# Altium project ATLAS_XP2V5.PrjPcb (part 1 of 2)
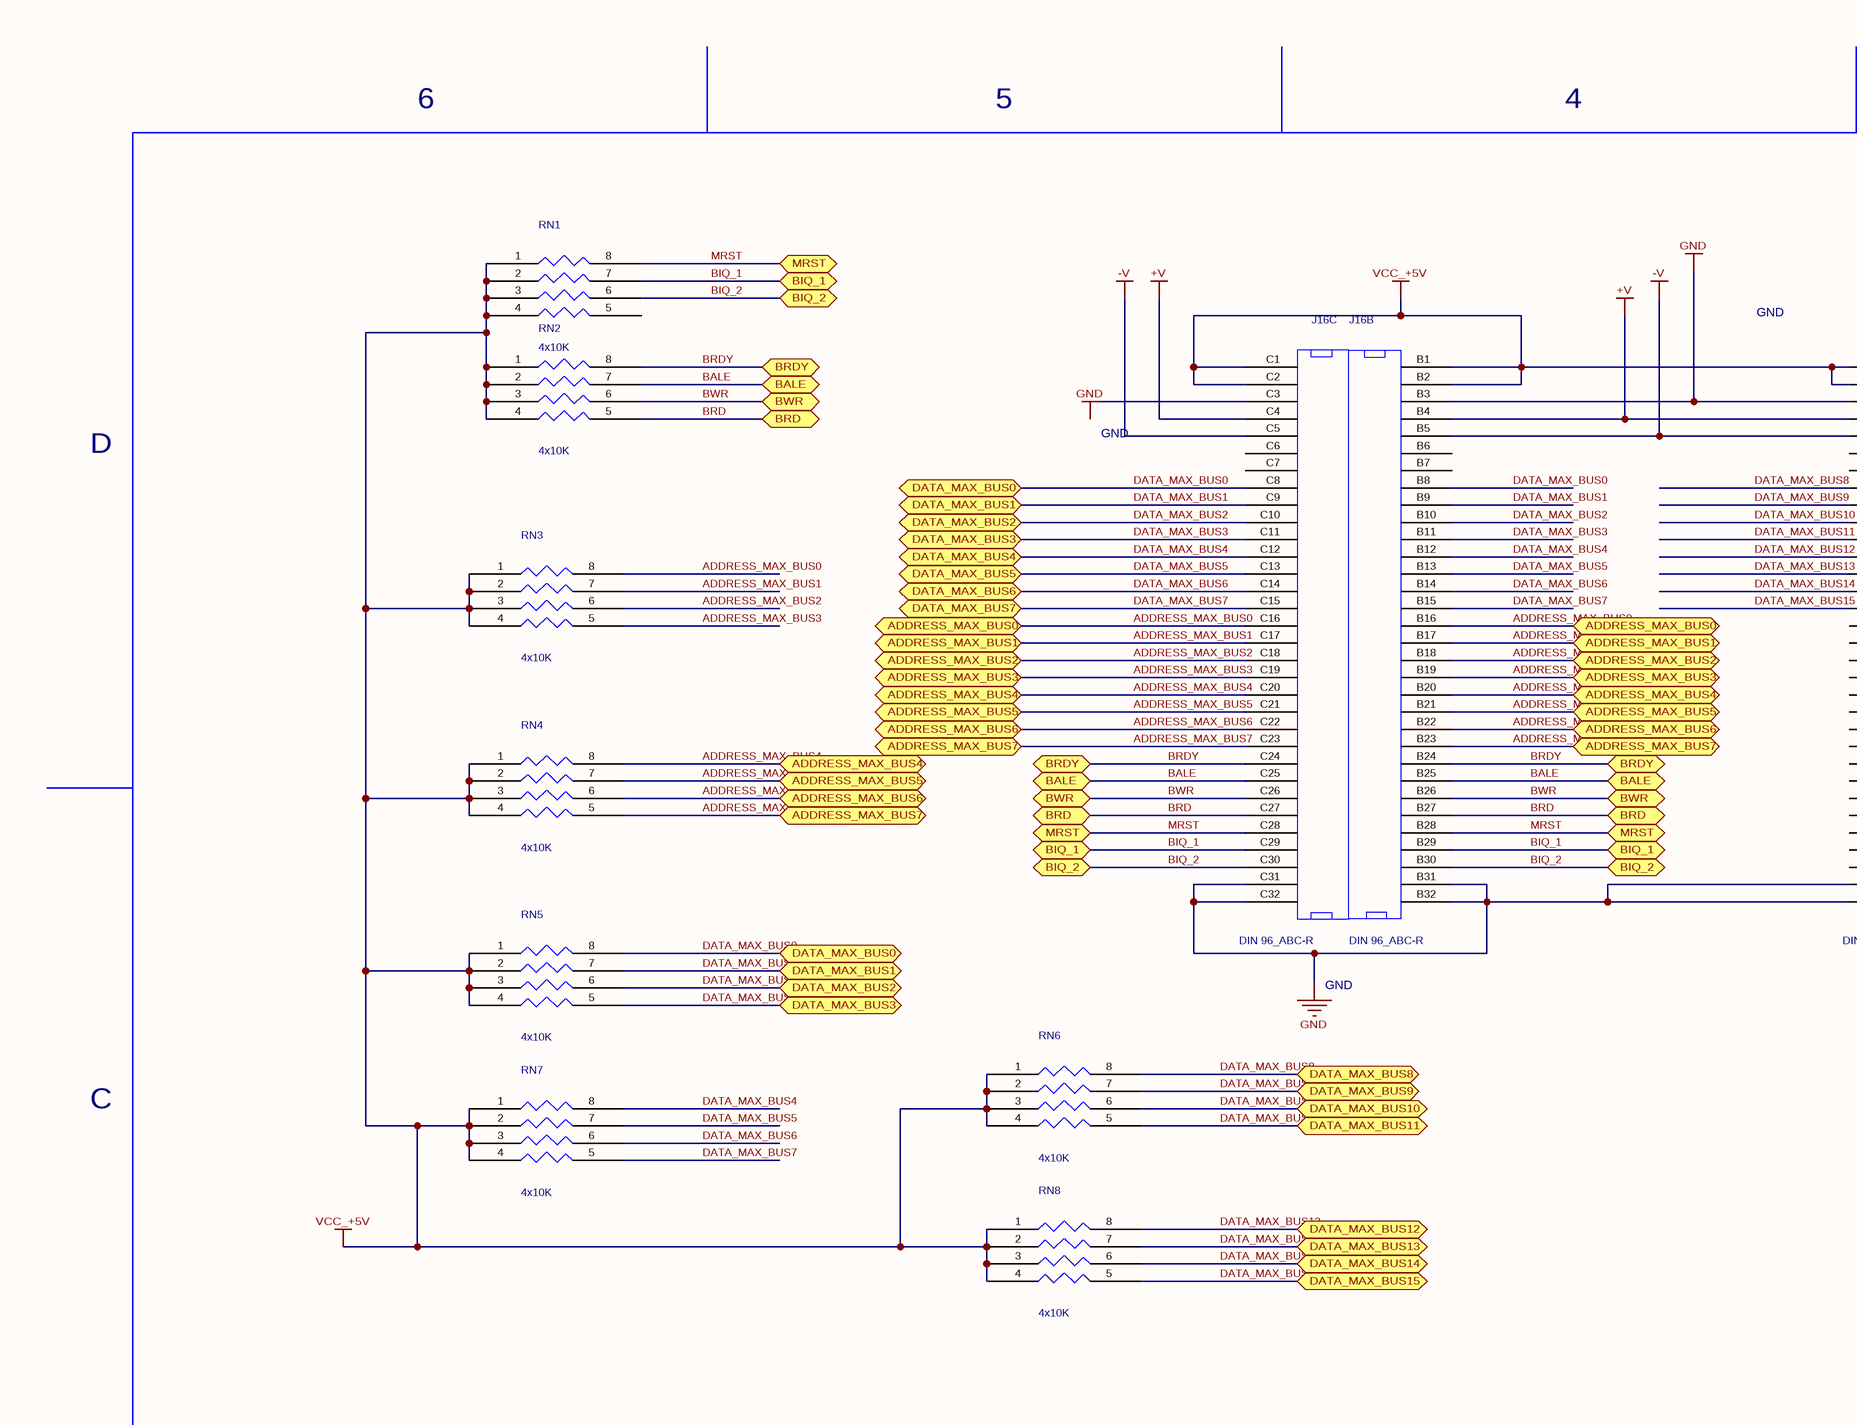
[diagram p0: MAX_BUS.SchDoc, top left]
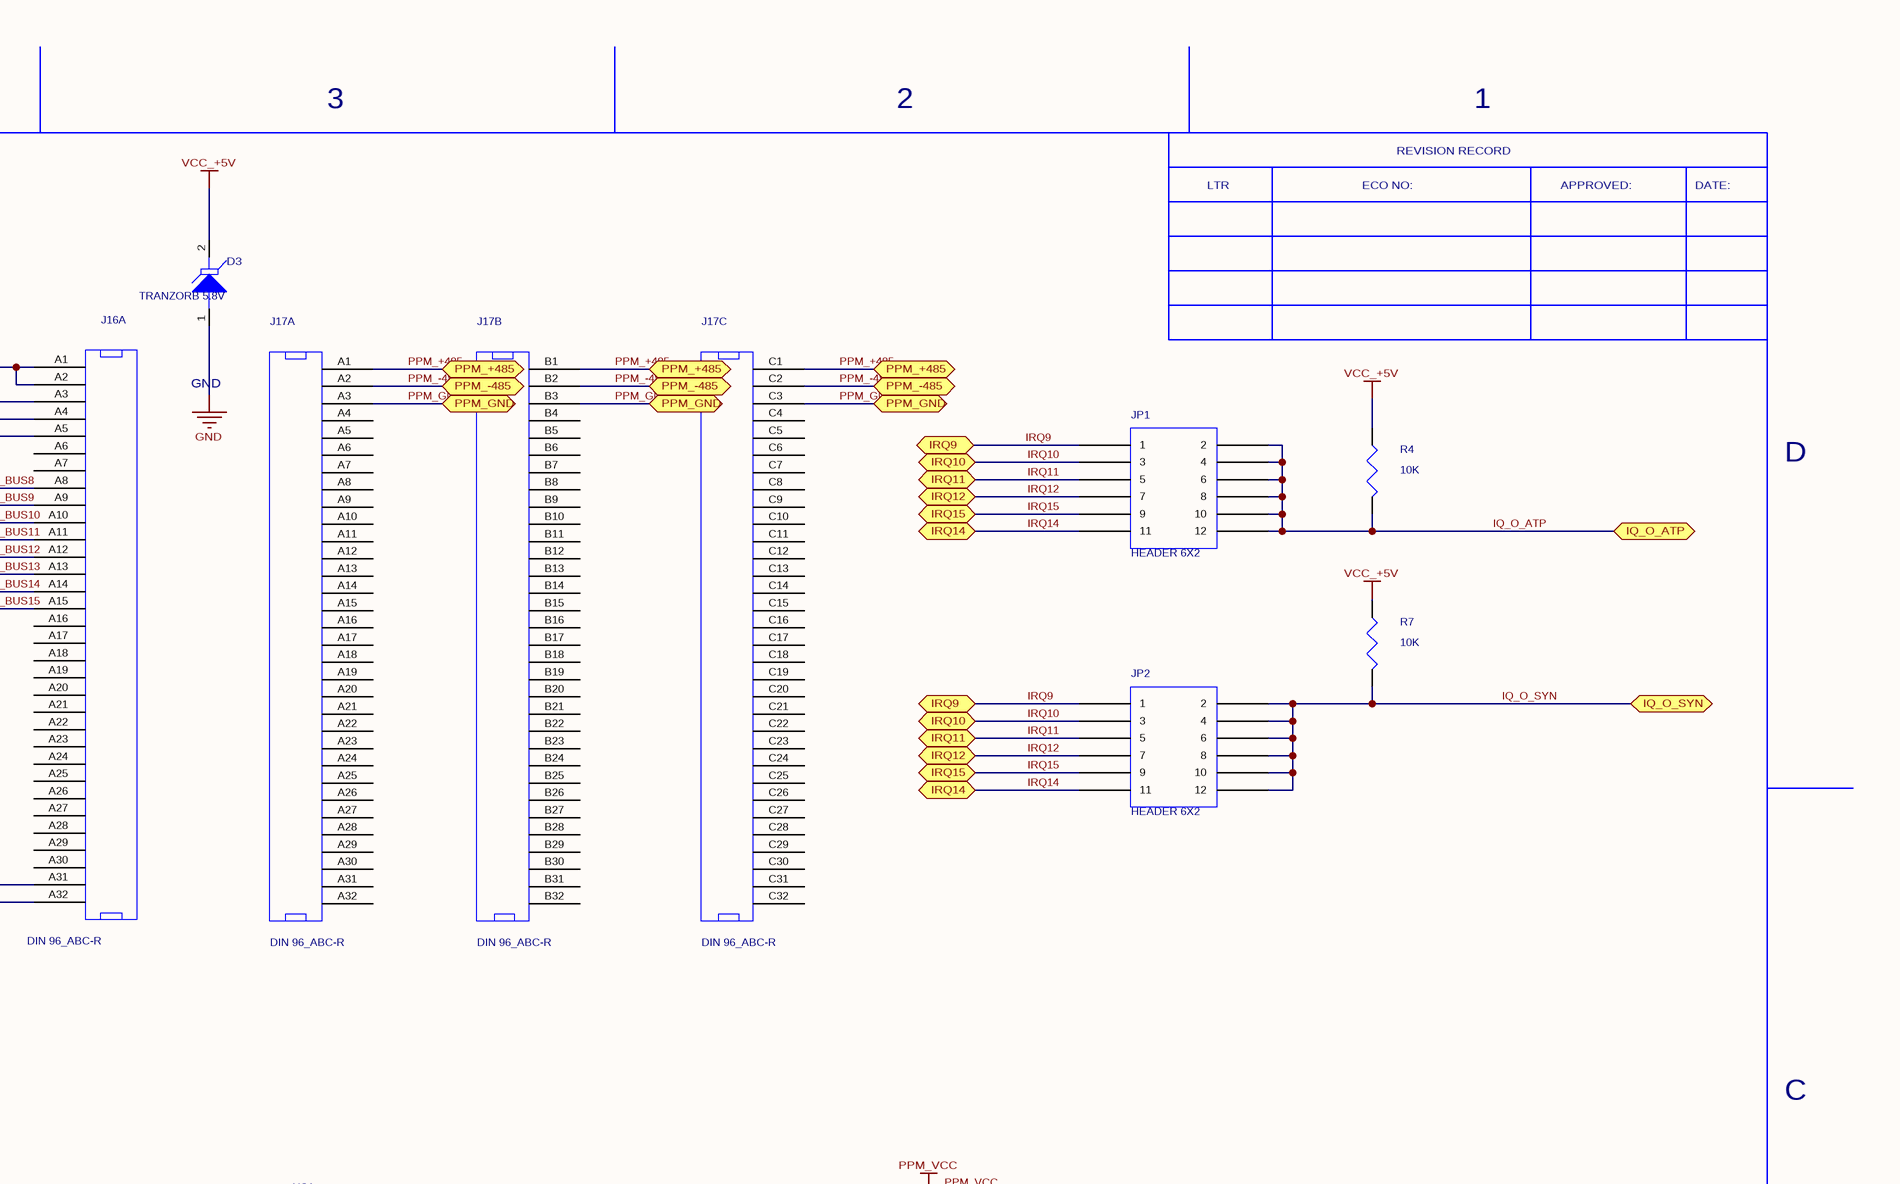
[diagram p1: MAX_BUS.SchDoc, top right]
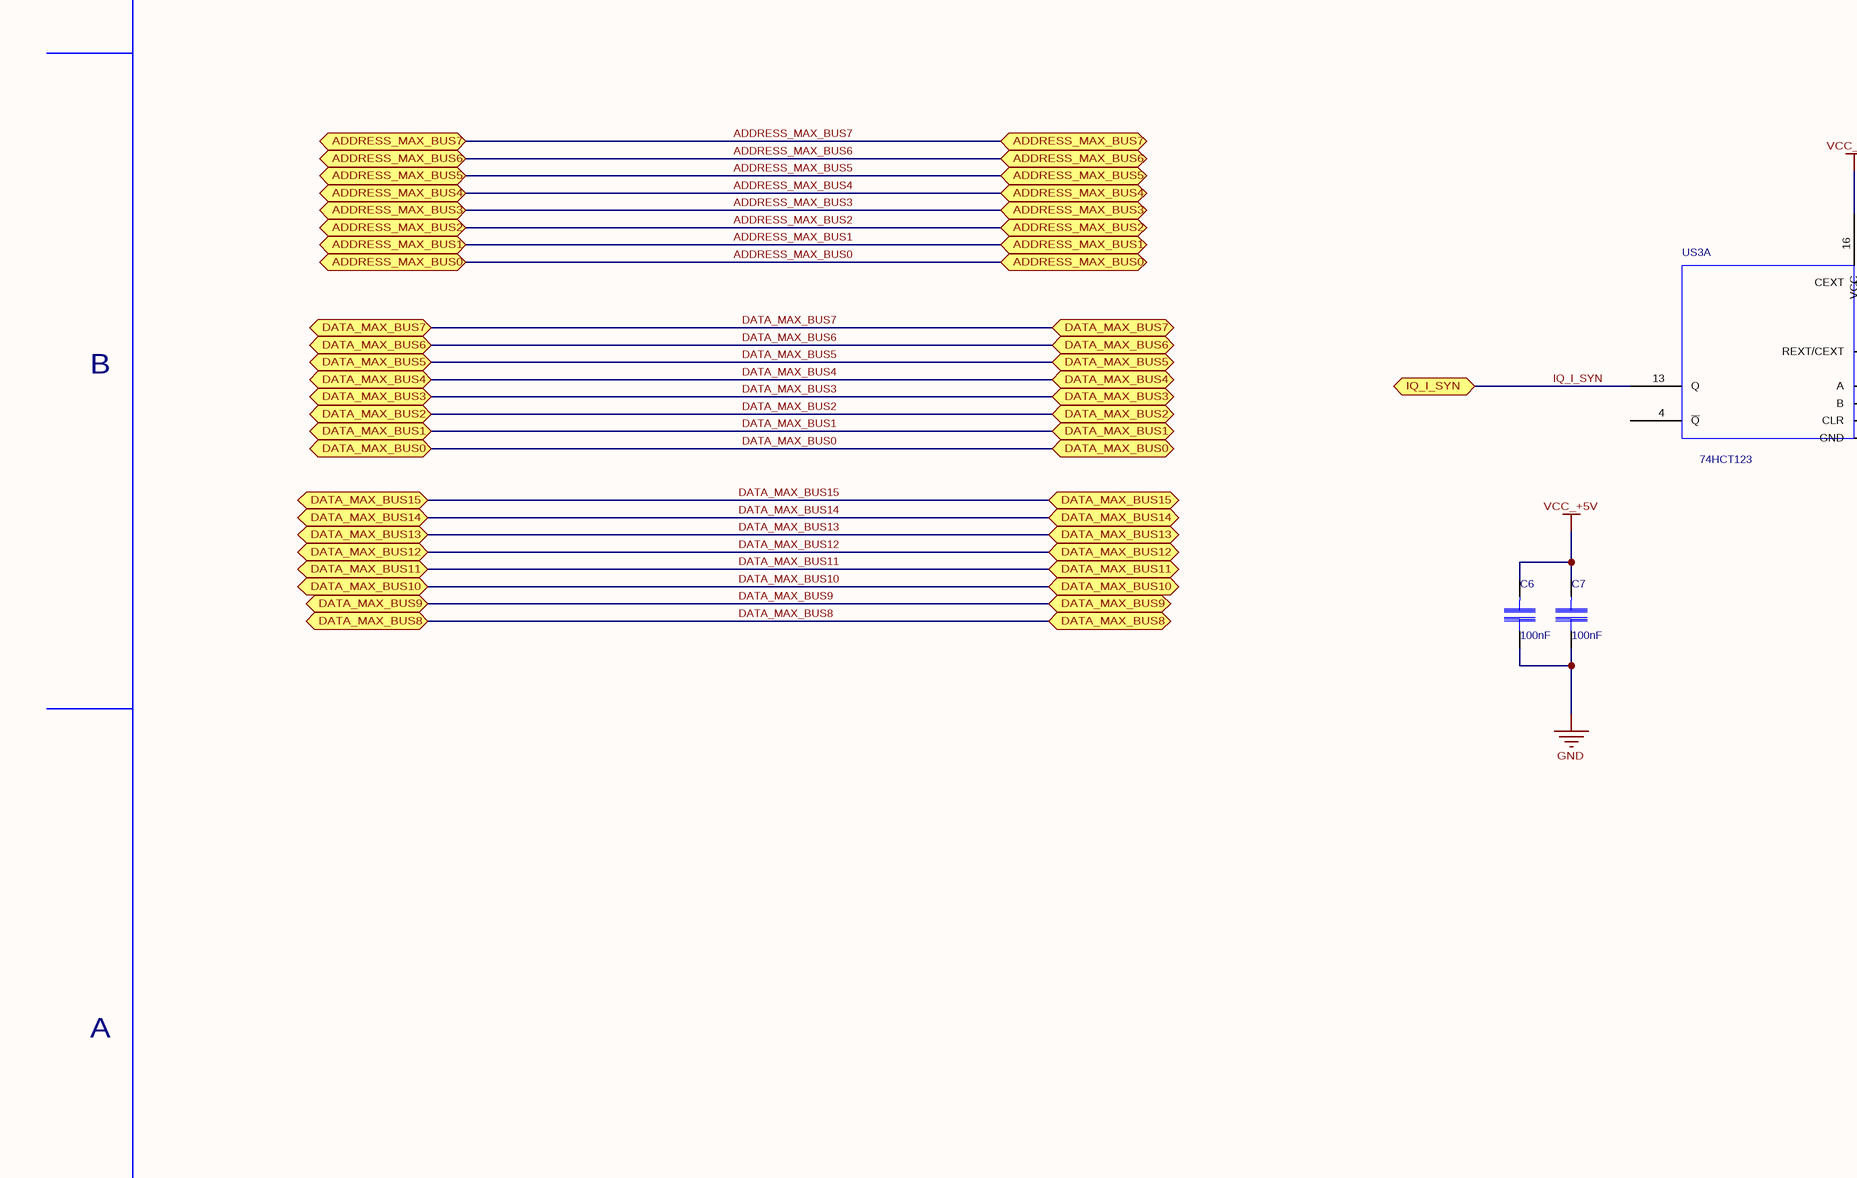
[diagram p2: MAX_BUS.SchDoc, bottom left]
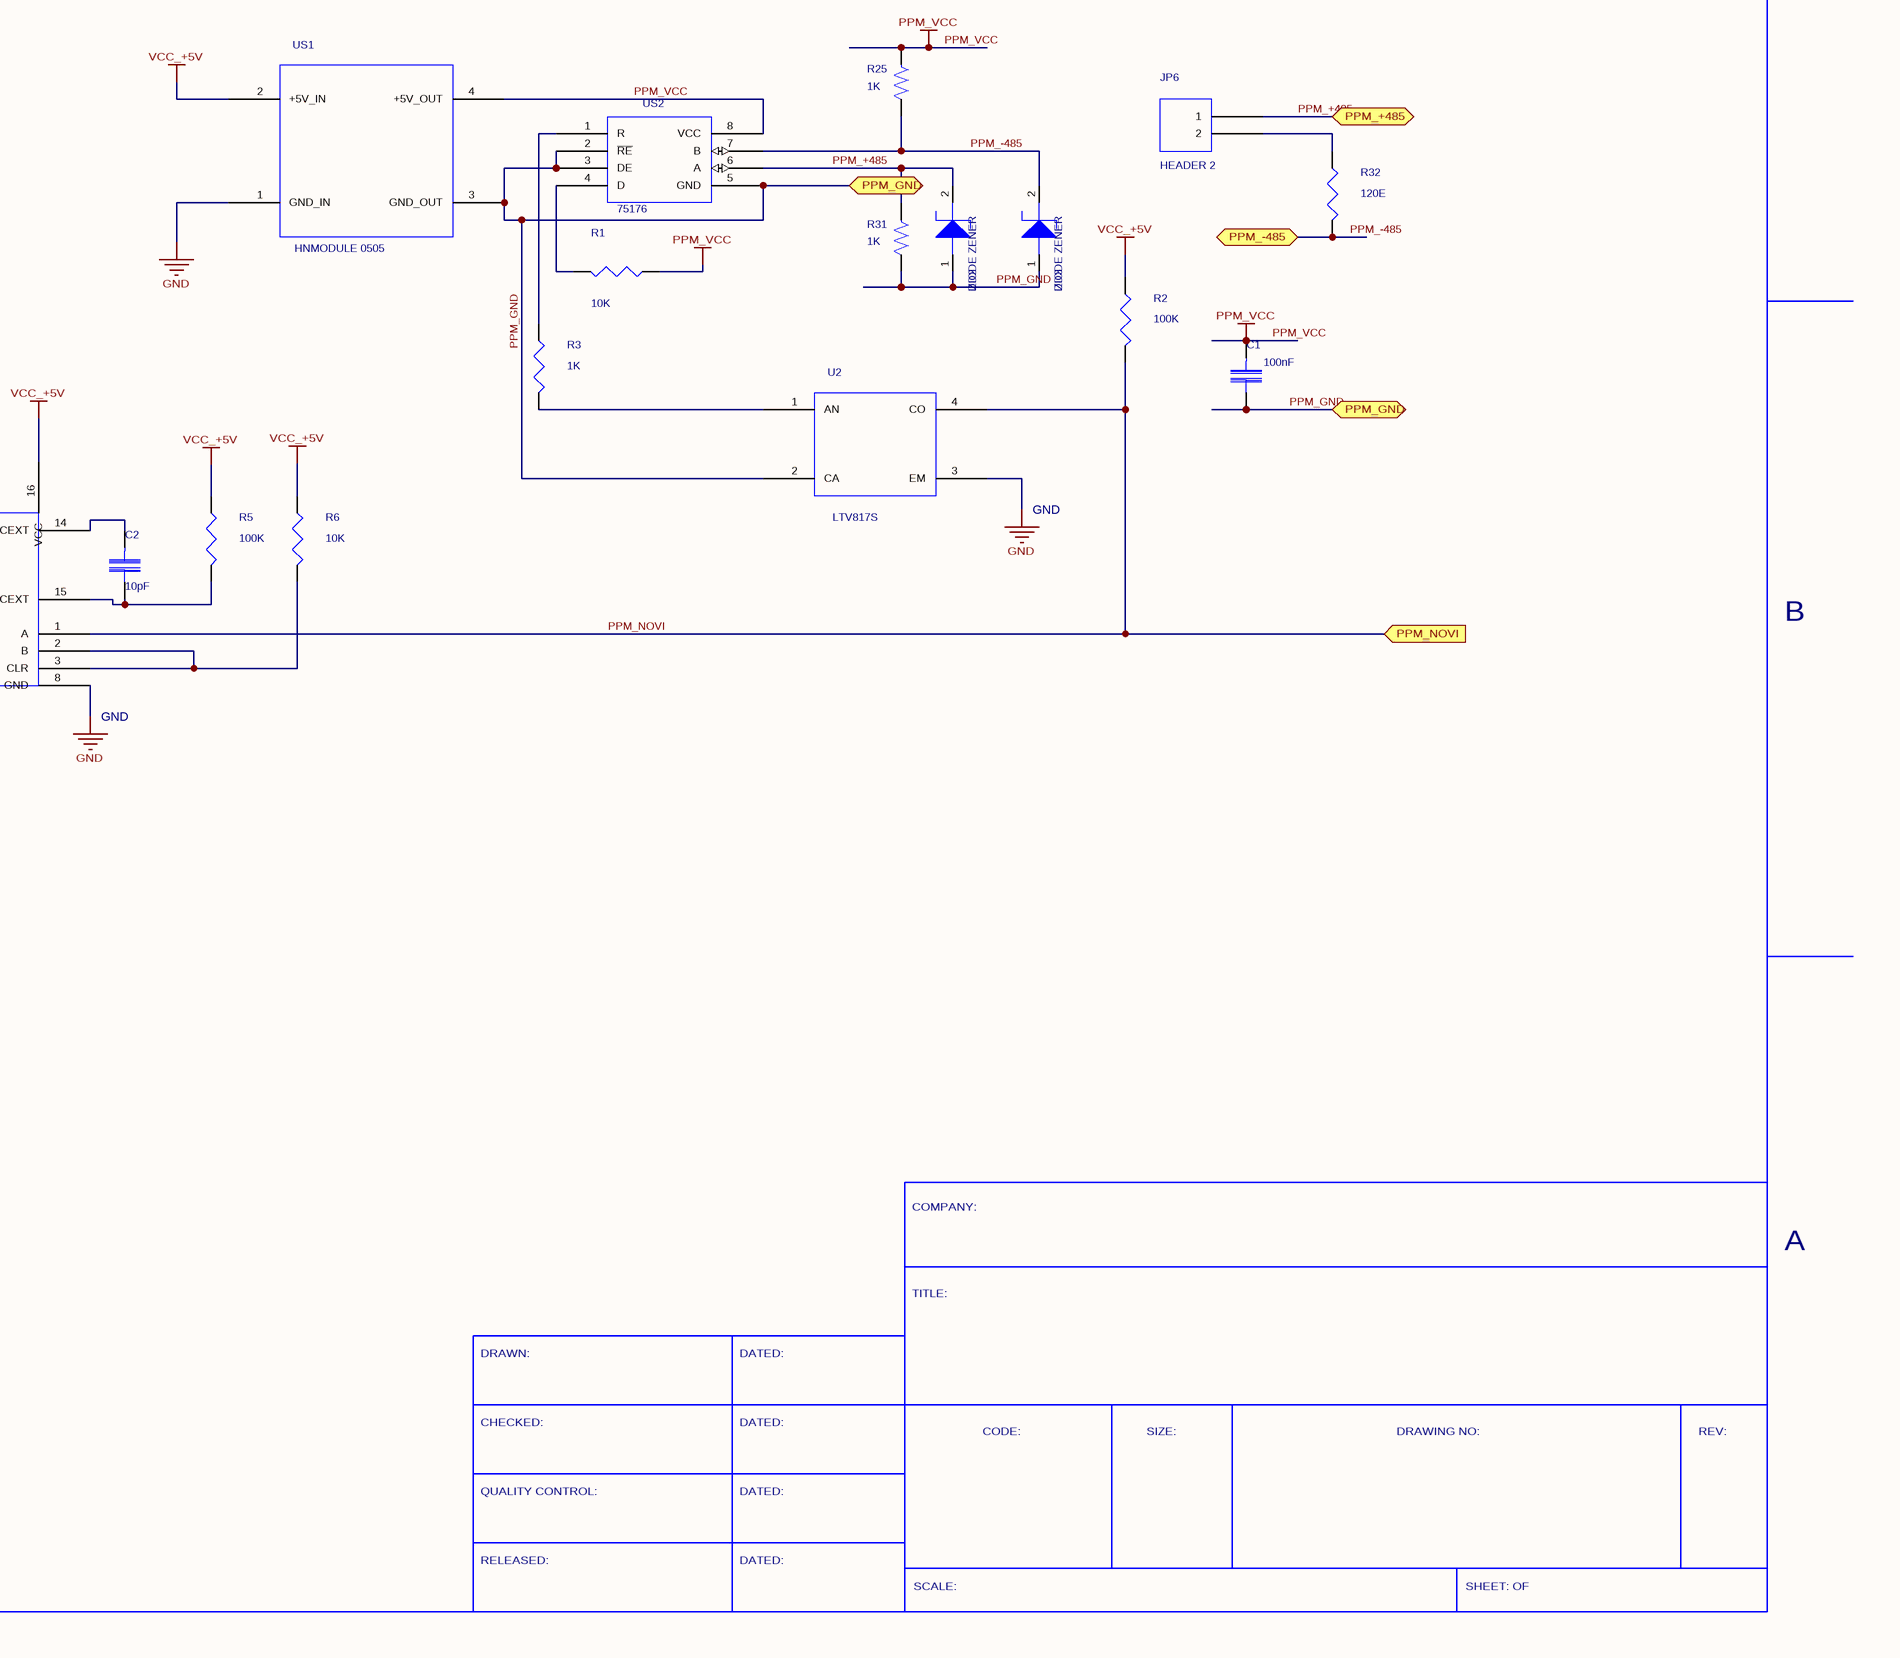
[diagram p3: MAX_BUS.SchDoc, bottom right]
6 sheets, 150 parts. Net scope: flat (ports and power ports of the same name join across sheets).
Board file: ATLAS_XP2V5_sredjen_bom.PcbDoc
Sheets:
  MAX_BUS.SchDoc
  POWER_SUPPLY.SchDoc
  ISA_XILINX.SchDoc
  WDT_TASTERI_M_S.SchDoc
  ATLAS_XP2V5.Sheet 5.SchDoc
  PROBA.SchDoc

## Sheet MAX_BUS.SchDoc: ATLAS_XP2V5
size 558 x 431 mm; Organization: IMP Automatika d.o.o.; Revision: V5

### Parts
C1  value 100nF  [SM/C_0805]  (hidden comment: C)
C2  value 10pF  [SM/C_0805]  (hidden comment: C)
C6  value 100nF  [SM/C_0805]  (hidden comment: C)
C7  value 100nF  [SM/C_0805]  (hidden comment: C)
D3  value TRANZORB 5.8V  [SM/DO214AC_21]  (hidden comment: TRANZORB_0)
J16  value DIN 96_ABC-R  [DIN96_ABC/R]  (hidden comment: DIN_96_ABC-R)  (parts A,B,C of 3)
J17  value DIN 96_ABC-R  [DIN96_ABC/R]  (hidden comment: DIN_96_ABC-R)  (parts A,B,C of 3)
JP1  value HEADER 6X2  [BLKCON.100/VH/TM2OE/W.200/12]  (hidden comment: HEADER_6X2)
JP2  value HEADER 6X2  [BLKCON.100/VH/TM2OE/W.200/12]  (hidden comment: HEADER_6X2)
JP6  value HEADER 2  [JUMPER_100]  (hidden comment: HEADER_2)
R1  value 10K  [SM/R_1206]  (hidden comment: RESISTOR_2)
R2  value 100K  [SM/R_1206]  (hidden comment: RESISTOR_2)
R3  value 1K  [SM/R_1206]  (hidden comment: RESISTOR_2)
R4  value 10K  [SM/R_1206]  (hidden comment: RESISTOR_2)
R5  value 100K  [SM/R_1206]  (hidden comment: RESISTOR_2)
R6  value 10K  [SM/R_1206]  (hidden comment: RESISTOR_2)
R7  value 10K  [SM/R_1206]  (hidden comment: RESISTOR_2)
R25  value 1K  [SM/R_1206]  (hidden comment: R)
R31  value 1K  [SM/R_1206]  (hidden comment: R)
R32  value 120E  [SM/R_1206]  (hidden comment: RESISTOR_2)
RN1  value 4x10K  [SMD_RX4]  (hidden comment: RESAR_IS_4/SM)
RN2  value 4x10K  [SMD_RX4]  (hidden comment: RESAR_IS_4/SM)
RN3  value 4x10K  [SMD_RX4]  (hidden comment: RESAR_IS_4/SM)
RN4  value 4x10K  [SMD_RX4]  (hidden comment: RESAR_IS_4/SM)
RN5  value 4x10K  [SMD_RX4]  (hidden comment: RESAR_IS_4/SM)
RN6  value 4x10K  [SMD_RX4]  (hidden comment: RESAR_IS_4/SM)
RN7  value 4x10K  [SMD_RX4]  (hidden comment: RESAR_IS_4/SM)
RN8  value 4x10K  [SMD_RX4]  (hidden comment: RESAR_IS_4/SM)
U2  value LTV817S  [LTV814S]  (hidden comment: LTV-817_0)
US1  value HNMODULE 0505  [DCDC55]  (hidden comment: HNMODUL0505)
US2  75176  [SOG.050/8/WG.244/L.225]
US3  value 74HCT123  [SOG.050/16/WG.244/L.375]  (hidden comment: 74HC123_0)  (part A of 2)
ZD2  value DIODE ZENER  [SM/D_1206_21]  (hidden comment: DIODE_ZENER_0)
ZD3  value DIODE ZENER  [SM/D_1206_21]  (hidden comment: DIODE_ZENER_0)

### Ports
ADDRESS_MAX_BUS0 (bidir), ADDRESS_MAX_BUS1 (bidir), ADDRESS_MAX_BUS2 (bidir), ADDRESS_MAX_BUS3 (bidir), ADDRESS_MAX_BUS4 (bidir), ADDRESS_MAX_BUS5 (bidir), ADDRESS_MAX_BUS6 (bidir), ADDRESS_MAX_BUS7 (bidir), BALE (bidir), BIQ_1 (bidir), BIQ_2 (bidir), BRD (bidir), BRDY (bidir), BWR (bidir), DATA_MAX_BUS0 (bidir), DATA_MAX_BUS1 (bidir), DATA_MAX_BUS2 (bidir), DATA_MAX_BUS3 (bidir), DATA_MAX_BUS4 (bidir), DATA_MAX_BUS5 (bidir), DATA_MAX_BUS6 (bidir), DATA_MAX_BUS7 (bidir), DATA_MAX_BUS8 (bidir), DATA_MAX_BUS9 (bidir), DATA_MAX_BUS10 (bidir), DATA_MAX_BUS11 (bidir), DATA_MAX_BUS12 (bidir), DATA_MAX_BUS13 (bidir), DATA_MAX_BUS14 (bidir), DATA_MAX_BUS15 (bidir), IQ_I_SYN (bidir), IQ_O_ATP (bidir), IQ_O_SYN (bidir), IRQ9 (bidir), IRQ10 (bidir), IRQ11 (bidir), IRQ12 (bidir), IRQ14 (bidir), IRQ15 (bidir), MRST (bidir), PPM_+485 (bidir), PPM_-485 (bidir), PPM_GND (bidir), PPM_NOVI

### Nets
+V: J16.A4 J16.B4 J16.C4
-V: J16.A5 J16.B5 J16.C5
GND: C6.2 C7.2 D3.1(ANODE) J16.A3 J16.A31 J16.A32 J16.B3 J16.B31 J16.B32 J16.C3 J16.C31 J16.C32 U2.3(EM) US1.1(GND_IN) US3.8(GND)
PPM_VCC: C1.1 R1.1 R25.1 US1.4(+5V_OUT) US2.8(VCC)
VCC_+5V: C6.1 C7.1 D3.2(CATHODE) J16.A1 J16.A2 J16.B1 J16.B2 J16.C1 J16.C2 R2.1 R4.1 R5.1 R6.1 R7.1 RN1.1 RN1.2 RN1.3 RN1.4 RN2.1 RN2.2 RN2.3 RN2.4 RN3.1 RN3.2 RN3.3 RN3.4 RN4.1 RN4.2 RN4.3 RN4.4 RN5.1 RN5.2 RN5.3 RN5.4 RN6.1 RN6.2 RN6.3 RN6.4 RN7.1 RN7.2 RN7.3 RN7.4 RN8.1 RN8.2 RN8.3 RN8.4 US1.2(+5V_IN) US3.16(VCC)
ADDRESS_MAX_BUS0: J16.B16 J16.C16 RN3.8 ; port ADDRESS_MAX_BUS0  [project net ADDRESS_MAX0]
ADDRESS_MAX_BUS1: J16.B17 J16.C17 RN3.7 ; port ADDRESS_MAX_BUS1  [project net ADDRESS_MAX1]
ADDRESS_MAX_BUS2: J16.B18 J16.C18 RN3.6 ; port ADDRESS_MAX_BUS2  [project net ADDRESS_MAX2]
ADDRESS_MAX_BUS3: J16.B19 J16.C19 RN3.5 ; port ADDRESS_MAX_BUS3  [project net ADDRESS_MAX3]
ADDRESS_MAX_BUS4: J16.B20 J16.C20 RN4.8 ; port ADDRESS_MAX_BUS4  [project net ADDRESS_MAX4]
ADDRESS_MAX_BUS5: J16.B21 J16.C21 RN4.7 ; port ADDRESS_MAX_BUS5  [project net ADDRESS_MAX5]
ADDRESS_MAX_BUS6: J16.B22 J16.C22 RN4.6 ; port ADDRESS_MAX_BUS6  [project net ADDRESS_MAX6]
ADDRESS_MAX_BUS7: J16.B23 J16.C23 RN4.5 ; port ADDRESS_MAX_BUS7  [project net ADDRESS_MAX7]
BALE: J16.B25 J16.C25 RN2.7 ; port BALE
BIQ_1: J16.B29 J16.C29 RN1.7 ; port BIQ_1
BIQ_2: J16.B30 J16.C30 RN1.6 ; port BIQ_2
BRD: J16.B27 J16.C27 RN2.5 ; port BRD
BRDY: J16.B24 J16.C24 RN2.8 ; port BRDY
BWR: J16.B26 J16.C26 RN2.6 ; port BWR
DATA_MAX_BUS0: J16.B8 J16.C8 RN5.8 ; port DATA_MAX_BUS0  [project net DATA_MAX0]
DATA_MAX_BUS1: J16.B9 J16.C9 RN5.7 ; port DATA_MAX_BUS1  [project net DATA_MAX1]
DATA_MAX_BUS2: J16.B10 J16.C10 RN5.6 ; port DATA_MAX_BUS2  [project net DATA_MAX2]
DATA_MAX_BUS3: J16.B11 J16.C11 RN5.5 ; port DATA_MAX_BUS3  [project net DATA_MAX3]
DATA_MAX_BUS4: J16.B12 J16.C12 RN7.8 ; port DATA_MAX_BUS4  [project net DATA_MAX4]
DATA_MAX_BUS5: J16.B13 J16.C13 RN7.7 ; port DATA_MAX_BUS5  [project net DATA_MAX5]
DATA_MAX_BUS6: J16.B14 J16.C14 RN7.6 ; port DATA_MAX_BUS6  [project net DATA_MAX6]
DATA_MAX_BUS7: J16.B15 J16.C15 RN7.5 ; port DATA_MAX_BUS7  [project net DATA_MAX7]
DATA_MAX_BUS8: J16.A8 RN6.8 ; port DATA_MAX_BUS8  [project net DATA_MAX8]
DATA_MAX_BUS9: J16.A9 RN6.7 ; port DATA_MAX_BUS9  [project net DATA_MAX9]
DATA_MAX_BUS10: J16.A10 RN6.6 ; port DATA_MAX_BUS10  [project net DATA_MAX10]
DATA_MAX_BUS11: J16.A11 RN6.5 ; port DATA_MAX_BUS11  [project net DATA_MAX11]
DATA_MAX_BUS12: J16.A12 RN8.8 ; port DATA_MAX_BUS12  [project net DATA_MAX12]
DATA_MAX_BUS13: J16.A13 RN8.7 ; port DATA_MAX_BUS13  [project net DATA_MAX13]
DATA_MAX_BUS14: J16.A14 RN8.6 ; port DATA_MAX_BUS14  [project net DATA_MAX14]
DATA_MAX_BUS15: J16.A15 RN8.5 ; port DATA_MAX_BUS15  [project net DATA_MAX15]
IQ_I_SYN: US3.13(Q) ; port IQ_I_SYN
IQ_O_ATP: JP1.2 JP1.4 JP1.6 JP1.8 JP1.10 JP1.12 R4.2 ; port IQ_O_ATP
IQ_O_SYN: JP2.2 JP2.4 JP2.6 JP2.8 JP2.10 JP2.12 R7.2 ; port IQ_O_SYN
IRQ9: JP1.1 JP2.1 ; port IRQ9
IRQ10: JP1.3 JP2.3 ; port IRQ10
IRQ11: JP1.5 JP2.5 ; port IRQ11
IRQ12: JP1.7 JP2.7 ; port IRQ12
IRQ14: JP1.11 JP2.11 ; port IRQ14
IRQ15: JP1.9 JP2.9 ; port IRQ15
MRST: J16.B28 J16.C28 RN1.8 ; port MRST
PPM_+485: J17.A1 J17.B1 J17.C1 JP6.1 R31.1 US2.6(A) ZD2.2(CATHODE) ; port PPM_+485
PPM_-485: J17.A2 J17.B2 J17.C2 R25.2 R32.2 US2.7(B) ZD3.2(CATHODE) ; port PPM_-485
PPM_GND: C1.2 J17.A3 J17.B3 J17.C3 R31.2 U2.2(CA) US1.3(GND_OUT) US2.2(~{RE}) US2.3(DE) US2.5(GND) ZD2.1(ANODE) ZD3.1(ANODE) ; port PPM_GND
PPM_NOVI: R2.2 U2.4(CO) US3.1(A) ; port PPM_NOVI
NetC2_1: C2.1 US3.14(CEXT)
NetC2_2: C2.2 R5.2 US3.15(REXT/CEXT)
NetJP6_2: JP6.2 R32.1
NetR1_2: R1.2 US2.4(D)
NetR3_1: R3.1 US2.1(R)
NetR3_2: R3.2 U2.1(AN)
NetR6_2: R6.2 US3.2(B) US3.3(CLR)

Not connected (* = marked no-connect by the designer): J16 A6 A7 A16 A17 A18 A19 A20 A21 A22 A23 A24 A25 A26 A27 A28 A29 A30 B6 B7 C6 C7; J17 A4 A5 A6 A7 A8 A9 A10 A11 A12 A13 A14 A15 A16 A17 A18 A19 A20 A21 A22 A23 A24 A25 A26 A27 A28 A29 A30 A31 A32 B4 B5 B6 B7 B8 B9 B10 B11 B12 B13 B14 B15 B16 B17 B18 B19 B20 B21 B22 B23 B24 B25 B26 B27 B28 B29 B30 B31 B32 C4 C5 C6 C7 C8 C9 C10 C11 C12 C13 C14 C15 C16 C17 C18 C19 C20 C21 C22 C23 C24 C25 C26 C27 C28 C29 C30 C31 C32; RN1 5; US3 4(~{Q})

### Notes on the sheet
- 6
- 5
- 4
- 3
- 2
- 1
- LTR
- ECO NO:
- REVISION RECORD
- APPROVED:
- DATE:
- GND
- D
- C
- B
- (near US3) GND
- COMPANY:
- A
- TITLE:
- DRAWN:
- DATED:
- CHECKED:
- CODE:
- SIZE:
- DRAWING NO:
- REV:
- QUALITY CONTROL:
- RELEASED:
- SCALE:
- SHEET: OF

### Library data of the parts
C1 C2 C6 C7 = C: Source_Path: D:\ORCADWIN\CAPTURE\ATP_LATT_01\ATP_00.OLB; SDTSourceLibName: C:\WINDOWS\TEMP\ATP_00.LIB; PCB DECAL: SM/C_0805
D3 = TRANZORB_0: Source_Path: C:\CADENCE\PSD_15.1\TOOLS\ATLAS_ITA\ATLAS_ITA.DSN; PCB DECAL: SM/DO214AC_21
J16 J17 = DIN_96_ABC-R: Source_Path: C:\ORCAD\ORCAD_10.5\TOOLS\CAPTURE\LIBRARY\CONNECTOR.OLB; PCB DECAL: DIN96_ABC/R
JP1 JP2 = HEADER_6X2: Source_Path: D:\ORCADWIN\CAPTURE\PTA\PC2A_00.OLB; SDTSourceLibName: C:\WINDOWS\TEMP\PC2A_00.LIB; PCB DECAL: BLKCON.100/VH/TM2OE/W.200/12
JP6 = HEADER_2: Source_Path: D:\ORCADWIN\CAPTURE\PTA\PC2A_00.OLB; SDTSourceLibName: C:\WINDOWS\TEMP\PC2A_00.LIB; PCB DECAL: JUMPER_100
R1-R7 R32 = RESISTOR_2: Source_Path: C:\CADENCE\PSD_15.1\TOOLS\CAPTURE\LIBRARY\DISCRETE.OLB; PCB DECAL: SM/R_1206
R25 R31 = R: Source_Path: C:\ORCAD\ORCAD_10.0\TOOLS\CAPTURE\LIBRARY\PSPICE\ANALOG.OLB; DIST: FLAT; PSpiceTemplate: R^@REFDES %1 %2 ?TOLERANCE|R^@REFDES| @VALUE  ?TOLERANCE|\n.model R^@REFDES RES R=1 DEV=@TOLERANCE%|; VOLTAGE: RVMAX; SLOPE: RSMAX; MAX_TEMP: RTMAX; POWER: RMAX; PCB DECAL: SM/R_1206
RN1-RN8 = RESAR_IS_4/SM: Source_Path: C:\ORCAD\ORCAD_10.5\TOOLS\CAPTURE\LIBRARY\DISCRETE.OLB; PCB DECAL: SMD_RX4
U2 = LTV-817_0: Source_Path: E:\MILOS\PROJECTS\ATLAS_XP\ATLAS_XP.DSN; PCB DECAL: LTV814S
US1 = HNMODUL0505: Source_Path: C:\PROJECTS\ATLAS_ITA\LIBRARY1.OLB; PCB DECAL: DCDC55
US2 = 75176: Source_Path: C:\ORCADESP\SDT\LIBRARY\TARIFA_O.OLB; PCB DECAL: SOG.050/8/WG.244/L.225; Value: 75176
US3 = 74HC123_0: Source_Path: E:\MILOS\PROJECTS\ATLAS_XP\ATLAS_XP.DSN; PCB DECAL: SOG.050/16/WG.244/L.375
ZD2 ZD3 = DIODE_ZENER_0: Source_Path: C:\PROJECTS\VHDL_PROJEKTI\BIS32W_ORCAD\BIS32W\BIS32_16.DSN; PCB DECAL: SM/D_1206_21

## Sheet POWER_SUPPLY.SchDoc: ATLAS_XP2V5
size 558 x 431 mm; Organization: IMP Automatika d.o.o.; Revision: V5
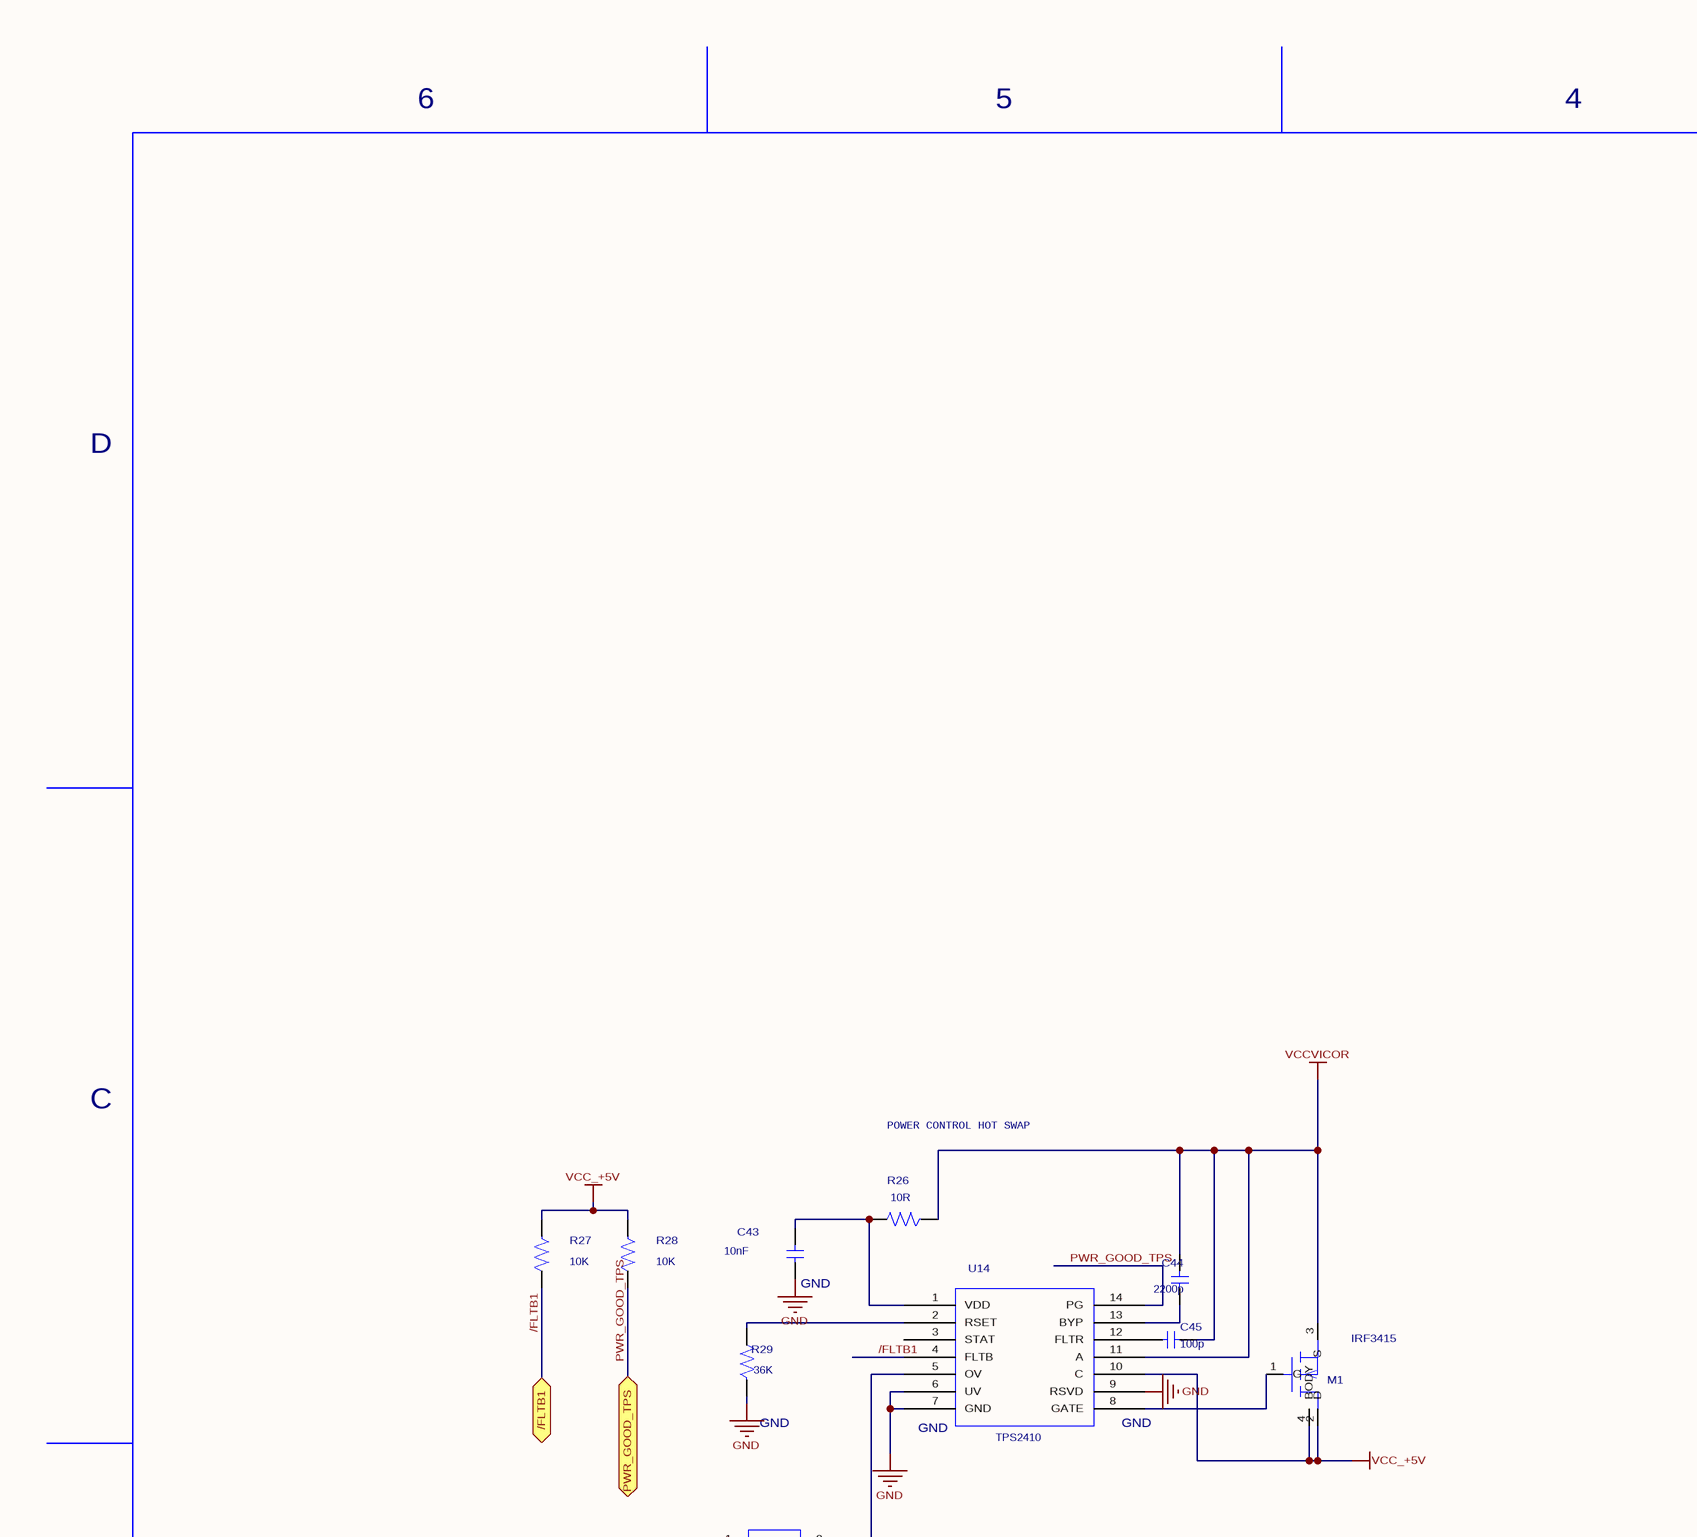
[diagram p4: POWER_SUPPLY.SchDoc, top left]
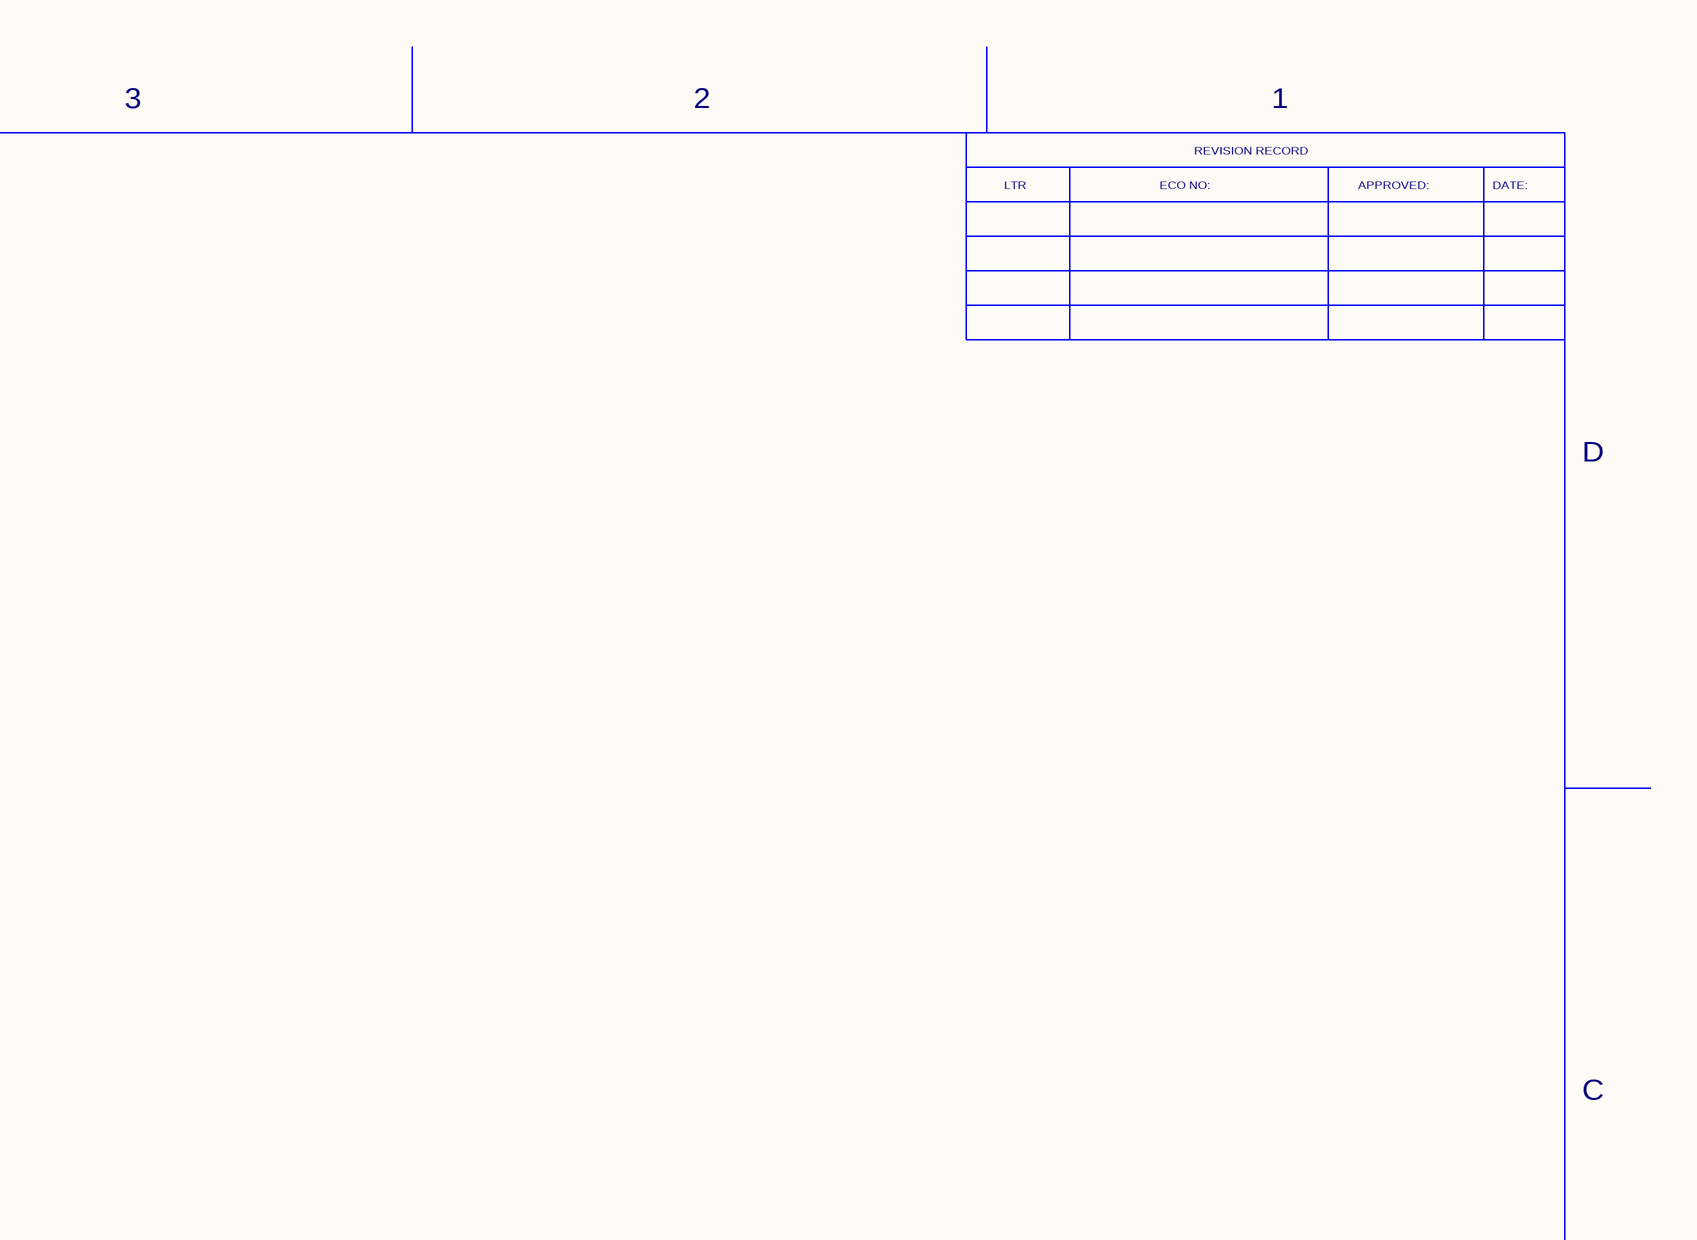
[diagram p5: POWER_SUPPLY.SchDoc, top right]
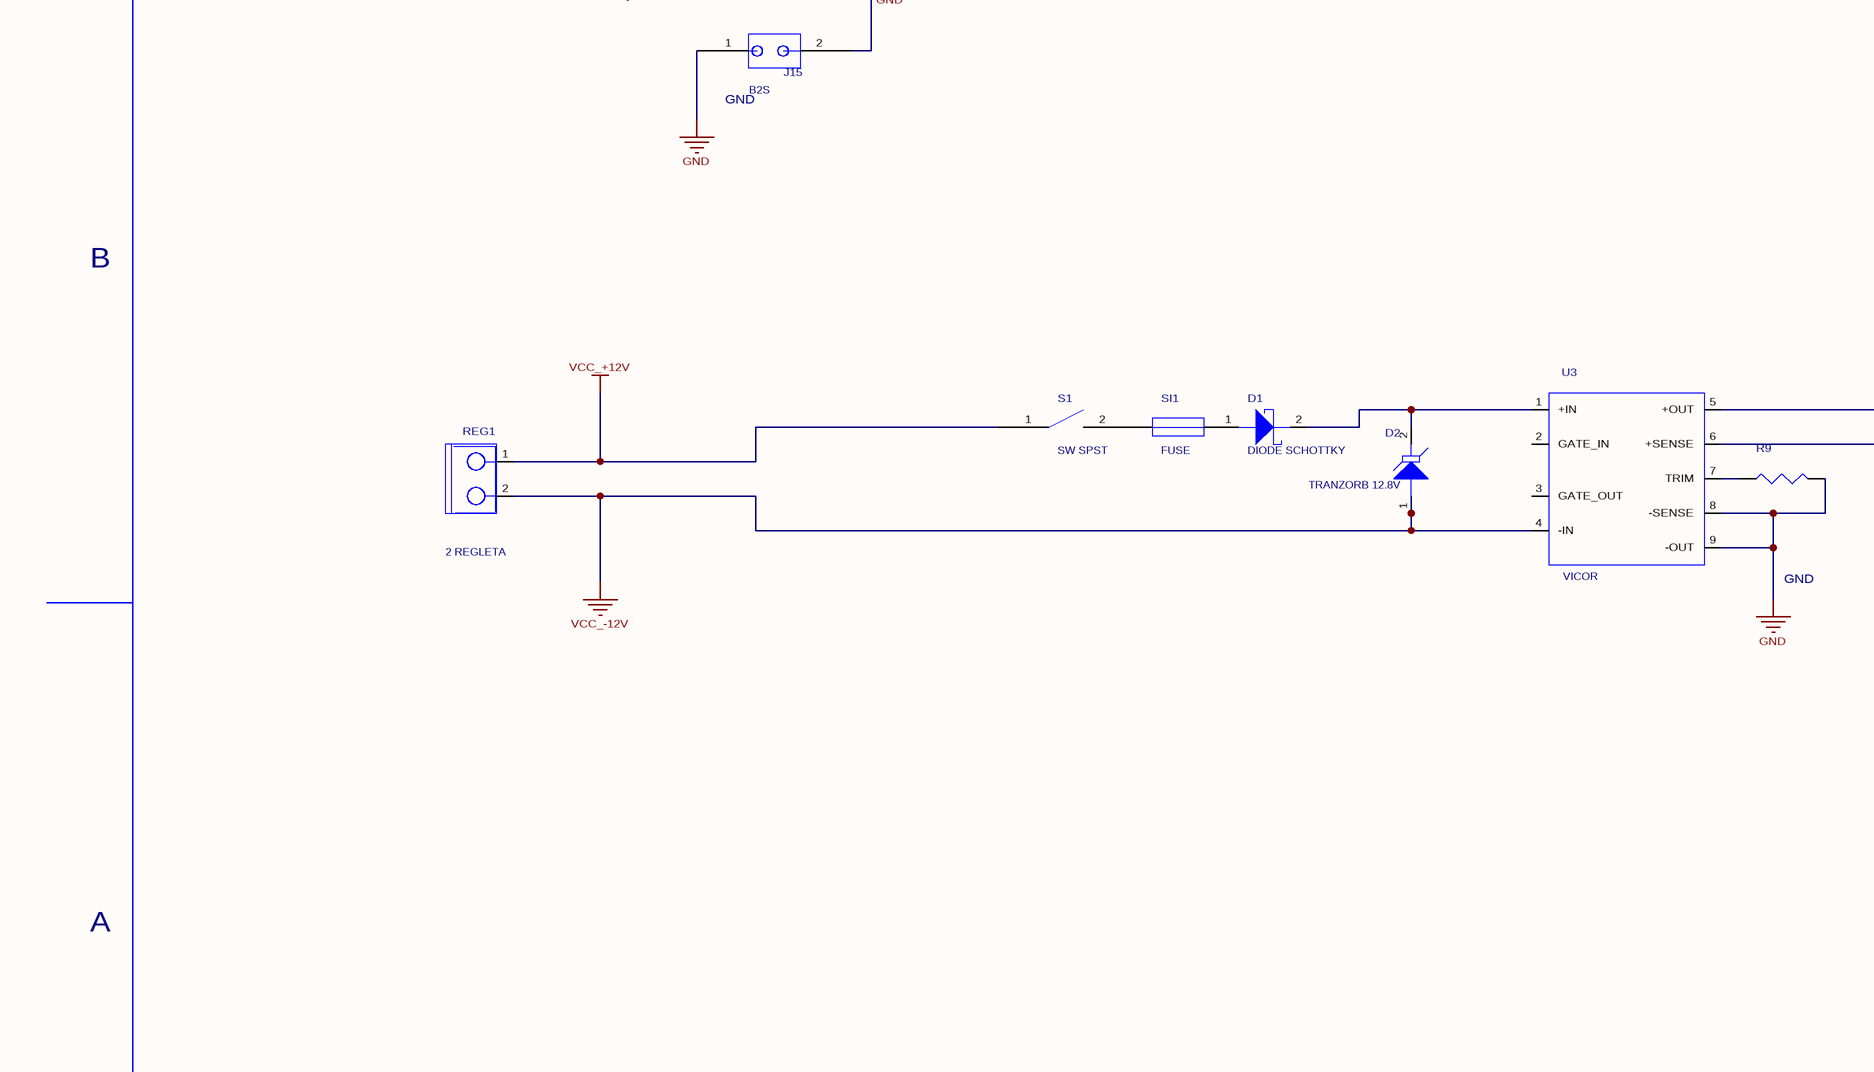
[diagram p6: POWER_SUPPLY.SchDoc, bottom left]
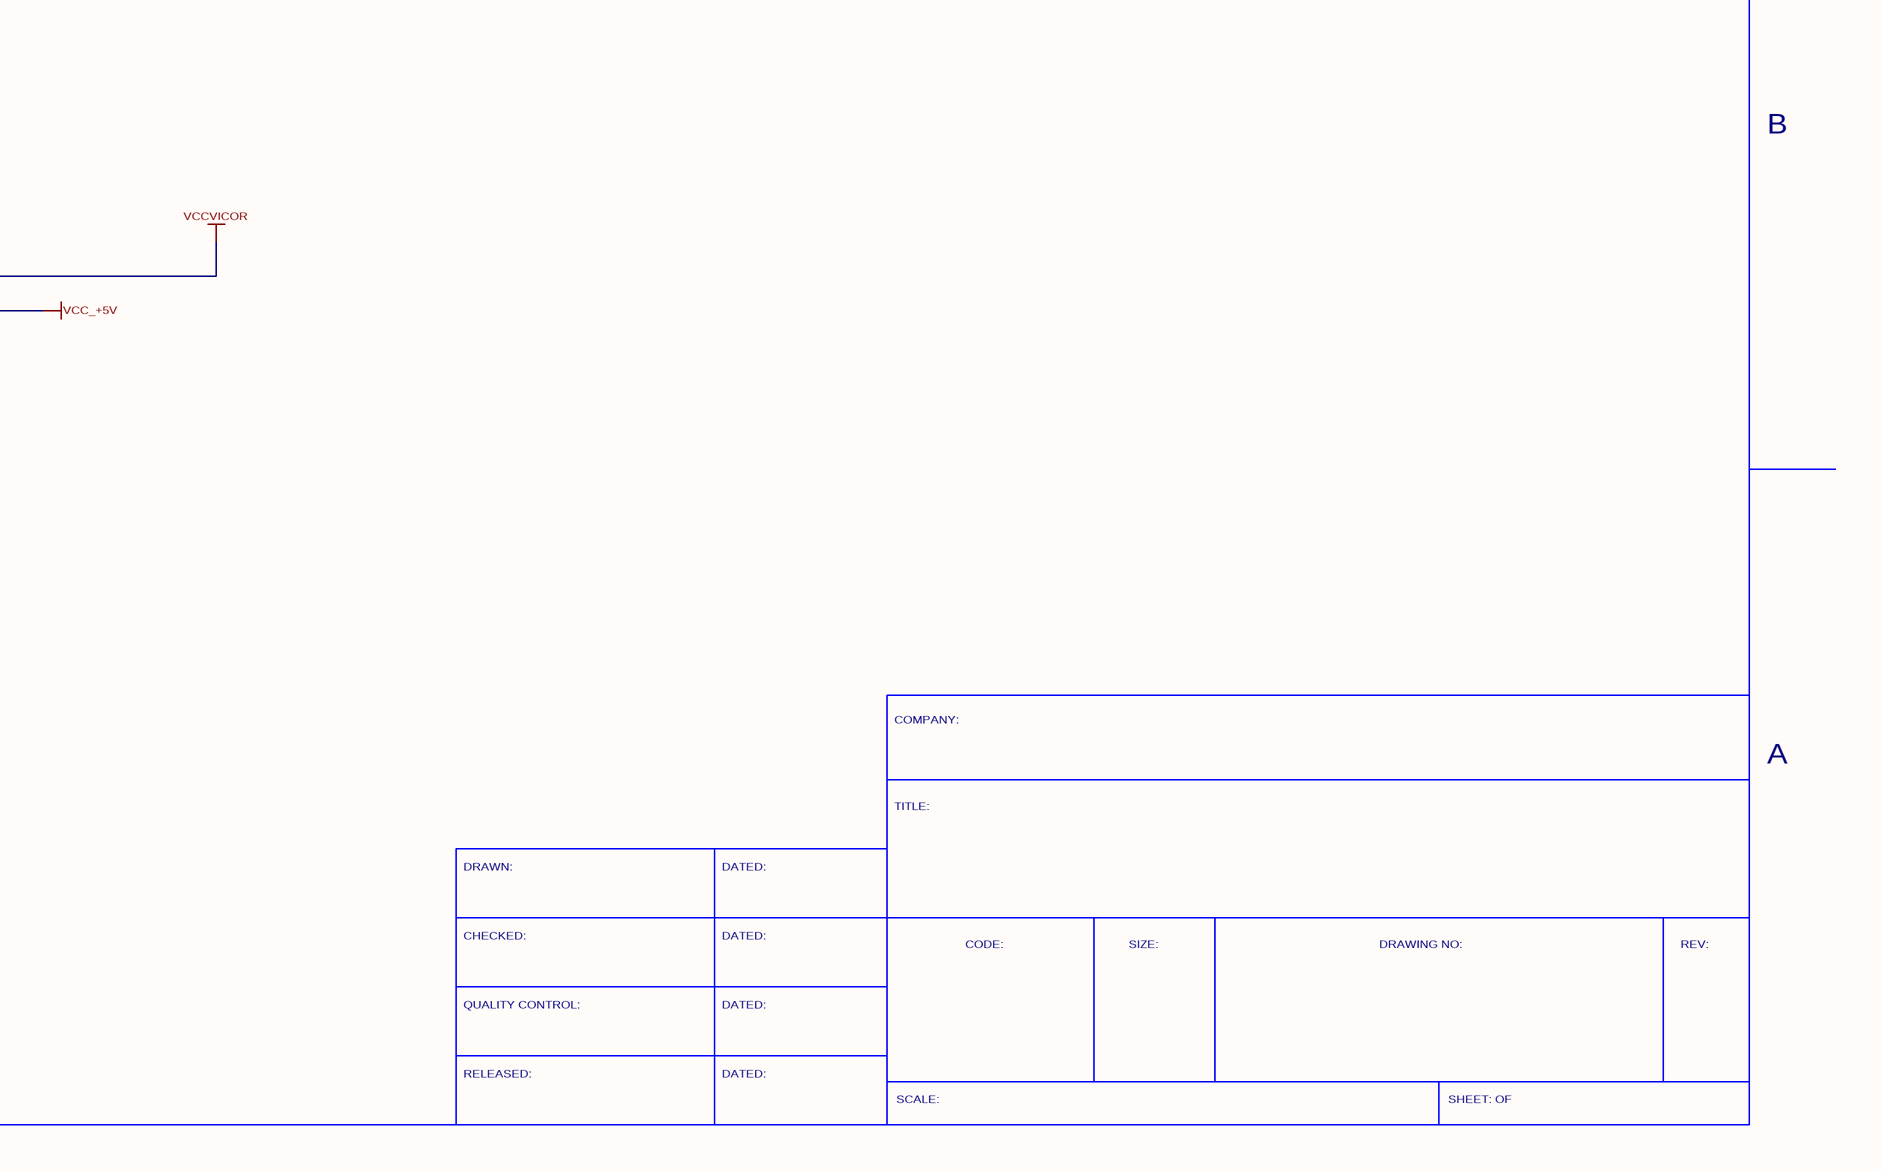
[diagram p7: POWER_SUPPLY.SchDoc, bottom right]

### Parts
C43  value 10nF  [SM/C_0805]  (hidden comment: C_3)
C44  value 2200p  [SM/C_0805]  (hidden comment: C_3)
C45  value 100p  [SM/C_0805]  (hidden comment: C_3)
D1  value DIODE SCHOTTKY  [SM/DO214AB_21]  (hidden comment: DIODE_SCHOTTKY_0)
D2  value TRANZORB 12.8V  [SM/DO214AC_21]  (hidden comment: TRANZORB_0)
J15  value B2S  [JUMPER_100]  (hidden comment: B2S_0)
M1  value IRF3415  [IRF3415_PADS_REV1]  (hidden comment: IRF3415_BODY)
R9  RESISTOR  [SM/R_1206]  (value not drawn)
R26  value 10R  [SM/R_1206]  (hidden comment: R)
R27  value 10K  [SM/R_1206]  (hidden comment: R)
R28  value 10K  [SM/R_1206]  (hidden comment: R)
R29  value 36K  [SM/R_1206]  (hidden comment: R)
REG1  value 2 REGLETA  [REG2_REV8]  (hidden comment: 8_REGLETA_4)
S1  value SW SPST  [SW12V_REV2]  (hidden comment: SW_SPST_0)
SI1  FUSE  [FUSEHOLDER3]
U3  VICOR  [VIKOR1]
U14  value TPS2410  [PDSO-G14_REV7]  (hidden comment: TPS2410_1)

### Ports
/FLTB1 (bidir), PWR_GOOD_TPS (bidir)

### Nets
GND: C43.1 J15.1 R9.2 R29.1 U3.8(-SENSE) U3.9(-OUT) U14.6(UV) U14.7(GND) U14.9(RSVD)
VCC_+5V: M1.2(D) M1.4(BODY) R27.1 R28.1 U3.6(+SENSE) U14.10(C)
VCC_+12V: REG1.1 S1.1(COMMON)
VCC_-12V: D2.1(ANODE) REG1.2 U3.4(-IN)
VCCVICOR: C44.2 C45.1 M1.3(S) R26.1 U3.5(+OUT) U14.11(A)
/FLTB1: R27.2 U14.4(FLTB) ; port /FLTB1
PWR_GOOD_TPS: R28.2 U14.14(PG) ; port PWR_GOOD_TPS
NetC43_2: C43.2 R26.2 U14.1(VDD)
NetC44_1: C44.1 U14.13(BYP)
NetC45_2: C45.2 U14.12(FLTR)
NetD1_1: D1.1(ANODE) SI1.2
NetD1_2: D1.2(CATHODE) D2.2(CATHODE) U3.1(+IN)
NetJ15_2: J15.2 U14.5(OV)
NetM1_1: M1.1(G) U14.8(GATE)
NetR9_1: R9.1 U3.7(TRIM)
NetR29_2: R29.2 U14.2(RSET)
NetS1_2: S1.2(NO) SI1.1

Not connected (* = marked no-connect by the designer): U3 2(GATE_IN) 3(GATE_OUT); U14 3(STAT)

### Notes on the sheet
- 6
- 5
- 4
- 3
- 2
- 1
- LTR
- ECO NO:
- REVISION RECORD
- APPROVED:
- DATE:
- D
- C
- POWER CONTROL HOT SWAP
- (near C43) GND
- (near R29) GND
- (near U14) GND
- (near J15) GND
- B
- GND
- COMPANY:
- A
- TITLE:
- DRAWN:
- DATED:
- CHECKED:
- CODE:
- SIZE:
- DRAWING NO:
- REV:
- QUALITY CONTROL:
- RELEASED:
- SCALE:
- SHEET: OF

### Library data of the parts
C43 = C_3: COMPSIDE: TOP; COMPLOC: [-4300.000,200.000]; COMPROT: 0; COMPFIXED: NO; COMPHEIGHT: 0.000; Source_Path: C:\ORCAD\ORCAD_10.0\TOOLS\CAPTURE\LIBRARY\PSPICE\ANALOG.OLB; DIST: FLAT; PSpiceTemplate: C^@REFDES %1 %2 ?TOLERANCE|C^@REFDES| @VALUE ?IC/IC=@IC/ ?TOLERANCE|\n.model C^@REFDES CAP C=1 DEV=@TOLERANCE%|; VOLTAGE: CMAX; CURRENT: CIMAX; KNEE: CBMAX; SLOPE: CSMAX; MAX_TEMP: CTMAX; COMPGROUP: 0; COMPLOCKED: NO; COMPKEY: NO; DECOUPLER: NO; MEMORY: NO; PCB DECAL: SM/C_0805
C44 = C_3: COMPSIDE: TOP; COMPLOC: [-3400.000,200.000]; COMPROT: 0; COMPFIXED: NO; COMPHEIGHT: 0.000; Source_Path: C:\ORCAD\ORCAD_10.0\TOOLS\CAPTURE\LIBRARY\PSPICE\ANALOG.OLB; DIST: FLAT; PSpiceTemplate: C^@REFDES %1 %2 ?TOLERANCE|C^@REFDES| @VALUE ?IC/IC=@IC/ ?TOLERANCE|\n.model C^@REFDES CAP C=1 DEV=@TOLERANCE%|; VOLTAGE: CMAX; CURRENT: CIMAX; KNEE: CBMAX; SLOPE: CSMAX; MAX_TEMP: CTMAX; PCB DECAL: SM/C_0805; COMPGROUP: 0; COMPLOCKED: NO; COMPKEY: NO; DECOUPLER: NO; MEMORY: NO
C45 = C_3: COMPHEIGHT: 0.000; MEMORY: NO; COMPGROUP: 0; COMPLOC: [-3700.000,200.000]; COMPSIDE: TOP; Source_Path: C:\ORCAD\ORCAD_10.0\TOOLS\CAPTURE\LIBRARY\PSPICE\ANALOG.OLB; DIST: FLAT; PSpiceTemplate: C^@REFDES %1 %2 ?TOLERANCE|C^@REFDES| @VALUE ?IC/IC=@IC/ ?TOLERANCE|\n.model C^@REFDES CAP C=1 DEV=@TOLERANCE%|; VOLTAGE: CMAX; CURRENT: CIMAX; KNEE: CBMAX; SLOPE: CSMAX; MAX_TEMP: CTMAX; DECOUPLER: NO; COMPKEY: NO; COMPLOCKED: NO; COMPFIXED: NO; COMPROT: 0; PCB DECAL: SM/C_0805
D1 = DIODE_SCHOTTKY_0: Source_Path: C:\CADENCE\PSD_15.1\TOOLS\ATLAS_ITA\ATLAS_ITA.DSN; PCB DECAL: SM/DO214AB_21
D2 = TRANZORB_0: as D3 on sheet MAX_BUS; PCB DECAL: SM/DO214AC_21
J15 = B2S_0: Source_Path: C:\CADENCE\PSD_15.1\TOOLS\ATLAS_ITA\ATLAS_ITA.DSN; PCB DECAL: JUMPER_100
M1 = IRF3415_BODY: COMPSIDE: TOP; COMPLOC: [-1200.000,2000.000]; COMPROT: 0; COMPFIXED: NO; COMPHEIGHT: 0.000; Source_Path: C:\CADENCE\PSD_15.1\TOOLS\ATLAS_ITA\ATLAS_ITA.DSN; PSpiceTemplate: M^@REFDES %d %g %s %s @MODEL; COMPGROUP: 0; COMPLOCKED: NO; COMPKEY: NO; DECOUPLER: NO; MEMORY: NO; Implementation: IRF3415; PCB DECAL: IRF3415_PADS_REV1
R9 = RESISTOR: Source_Path: C:\PROGRAM FILES\ORCAD\CAPTURE\LIBRARY\DISCRETE.OLB; PCB DECAL: SM/R_1206; Value: RESISTOR
R26 = R: COMPSIDE: TOP; COMPLOC: [-2400.000,2400.000]; COMPROT: 0; COMPFIXED: NO; COMPHEIGHT: 0.000; Source_Path: C:\ORCAD\ORCAD_10.0\TOOLS\CAPTURE\LIBRARY\PSPICE\ANALOG.OLB; DIST: FLAT; PSpiceTemplate: R^@REFDES %1 %2 ?TOLERANCE|R^@REFDES| @VALUE  ?TOLERANCE|\n.model R^@REFDES RES R=1 DEV=@TOLERANCE%|; VOLTAGE: RVMAX; SLOPE: RSMAX; MAX_TEMP: RTMAX; POWER: RMAX; COMPGROUP: 0; COMPLOCKED: NO; COMPKEY: NO; DECOUPLER: NO; MEMORY: NO; PCB DECAL: SM/R_1206
R27 R28 = R: as R25 on sheet MAX_BUS; PCB DECAL: SM/R_1206
R29 = R: COMPHEIGHT: 0.000; MEMORY: NO; COMPGROUP: 0; COMPLOC: [-2400.000,2400.000]; COMPSIDE: TOP; Source_Path: C:\ORCAD\ORCAD_10.0\TOOLS\CAPTURE\LIBRARY\PSPICE\ANALOG.OLB; DIST: FLAT; PSpiceTemplate: R^@REFDES %1 %2 ?TOLERANCE|R^@REFDES| @VALUE  ?TOLERANCE|\n.model R^@REFDES RES R=1 DEV=@TOLERANCE%|; VOLTAGE: RVMAX; SLOPE: RSMAX; MAX_TEMP: RTMAX; POWER: RMAX; DECOUPLER: NO; COMPKEY: NO; COMPLOCKED: NO; COMPFIXED: NO; COMPROT: 0; PCB DECAL: SM/R_1206
REG1 = 8_REGLETA_4: Source_Path: E:\MILOS\PROJECTS\ATLAS_XP\ATLAS_XP.DSN; SDTSourceLibName: C:\WINDOWS\TEMP\ATP_00.LIB; PCB DECAL: REG2_REV8
S1 = SW_SPST_0: Source_Path: C:\CADENCE\PSD_15.1\TOOLS\ATLAS_ITA\ATLAS_ITA.DSN; PCB DECAL: SW12V_REV2
SI1 = FUSE: Source_Path: C:\CADENCE\PSD_15.1\TOOLS\CAPTURE\LIBRARY\IEC\DEVICE.OLB; PCB DECAL: FUSEHOLDER3; Value: FUSE
U3 = VICOR: Source_Path: C:\DOCUMENTS AND SETTINGS\RAYVOJ HARDWAREA\DESKTOP\MILOSH.OLB; PCB DECAL: VIKOR1; Value: VICOR
U14 = TPS2410_1: FPLIST: DIP.100B/14/W.300/L.800; COMPSIDE: TOP; COMPLOC: [-700.000,900.000]; COMPROT: 0; COMPFIXED: NO; COMPHEIGHT: 0.000; Source_Path: C:\ORCAD\PROJECTS\PUPINATPPCB.DSN; PCB DECAL: PDSO-G14_REV7; COMPGROUP: 0; COMPLOCKED: NO; COMPKEY: NO; DECOUPLER: NO; MEMORY: NO

## Sheet ISA_XILINX.SchDoc: ATLAS_XP2V5
size 558 x 431 mm; Organization: IMP Automatika d.o.o.; Revision: V5
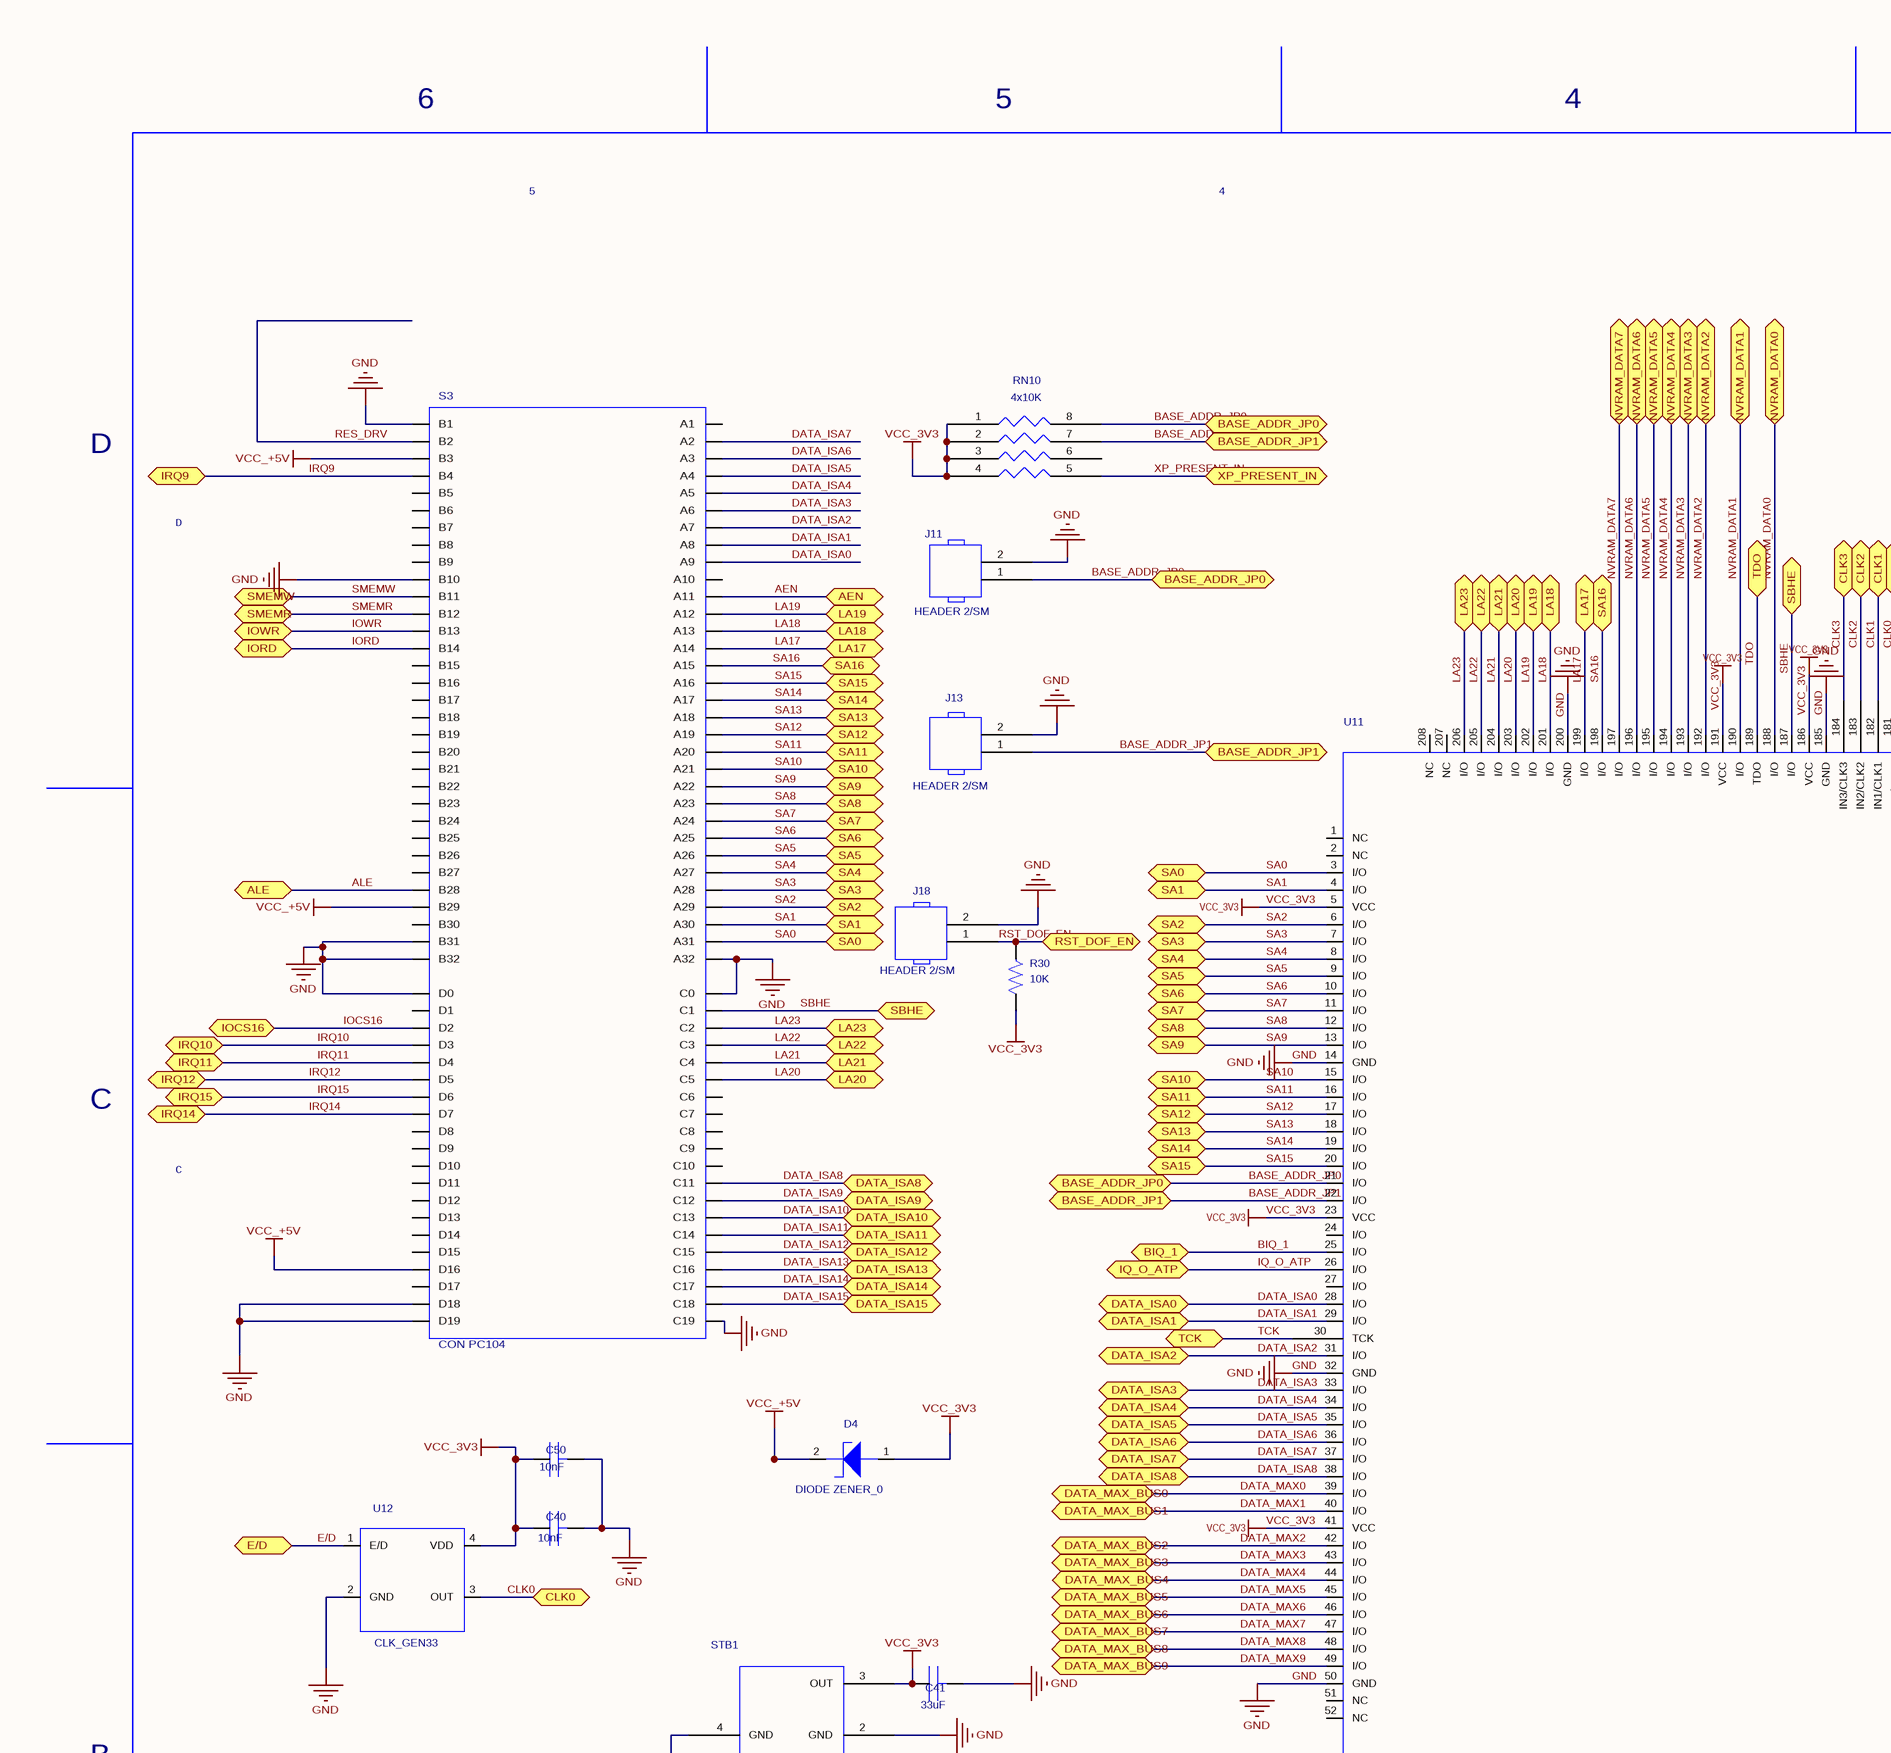
[diagram p8: ISA_XILINX.SchDoc, top left]
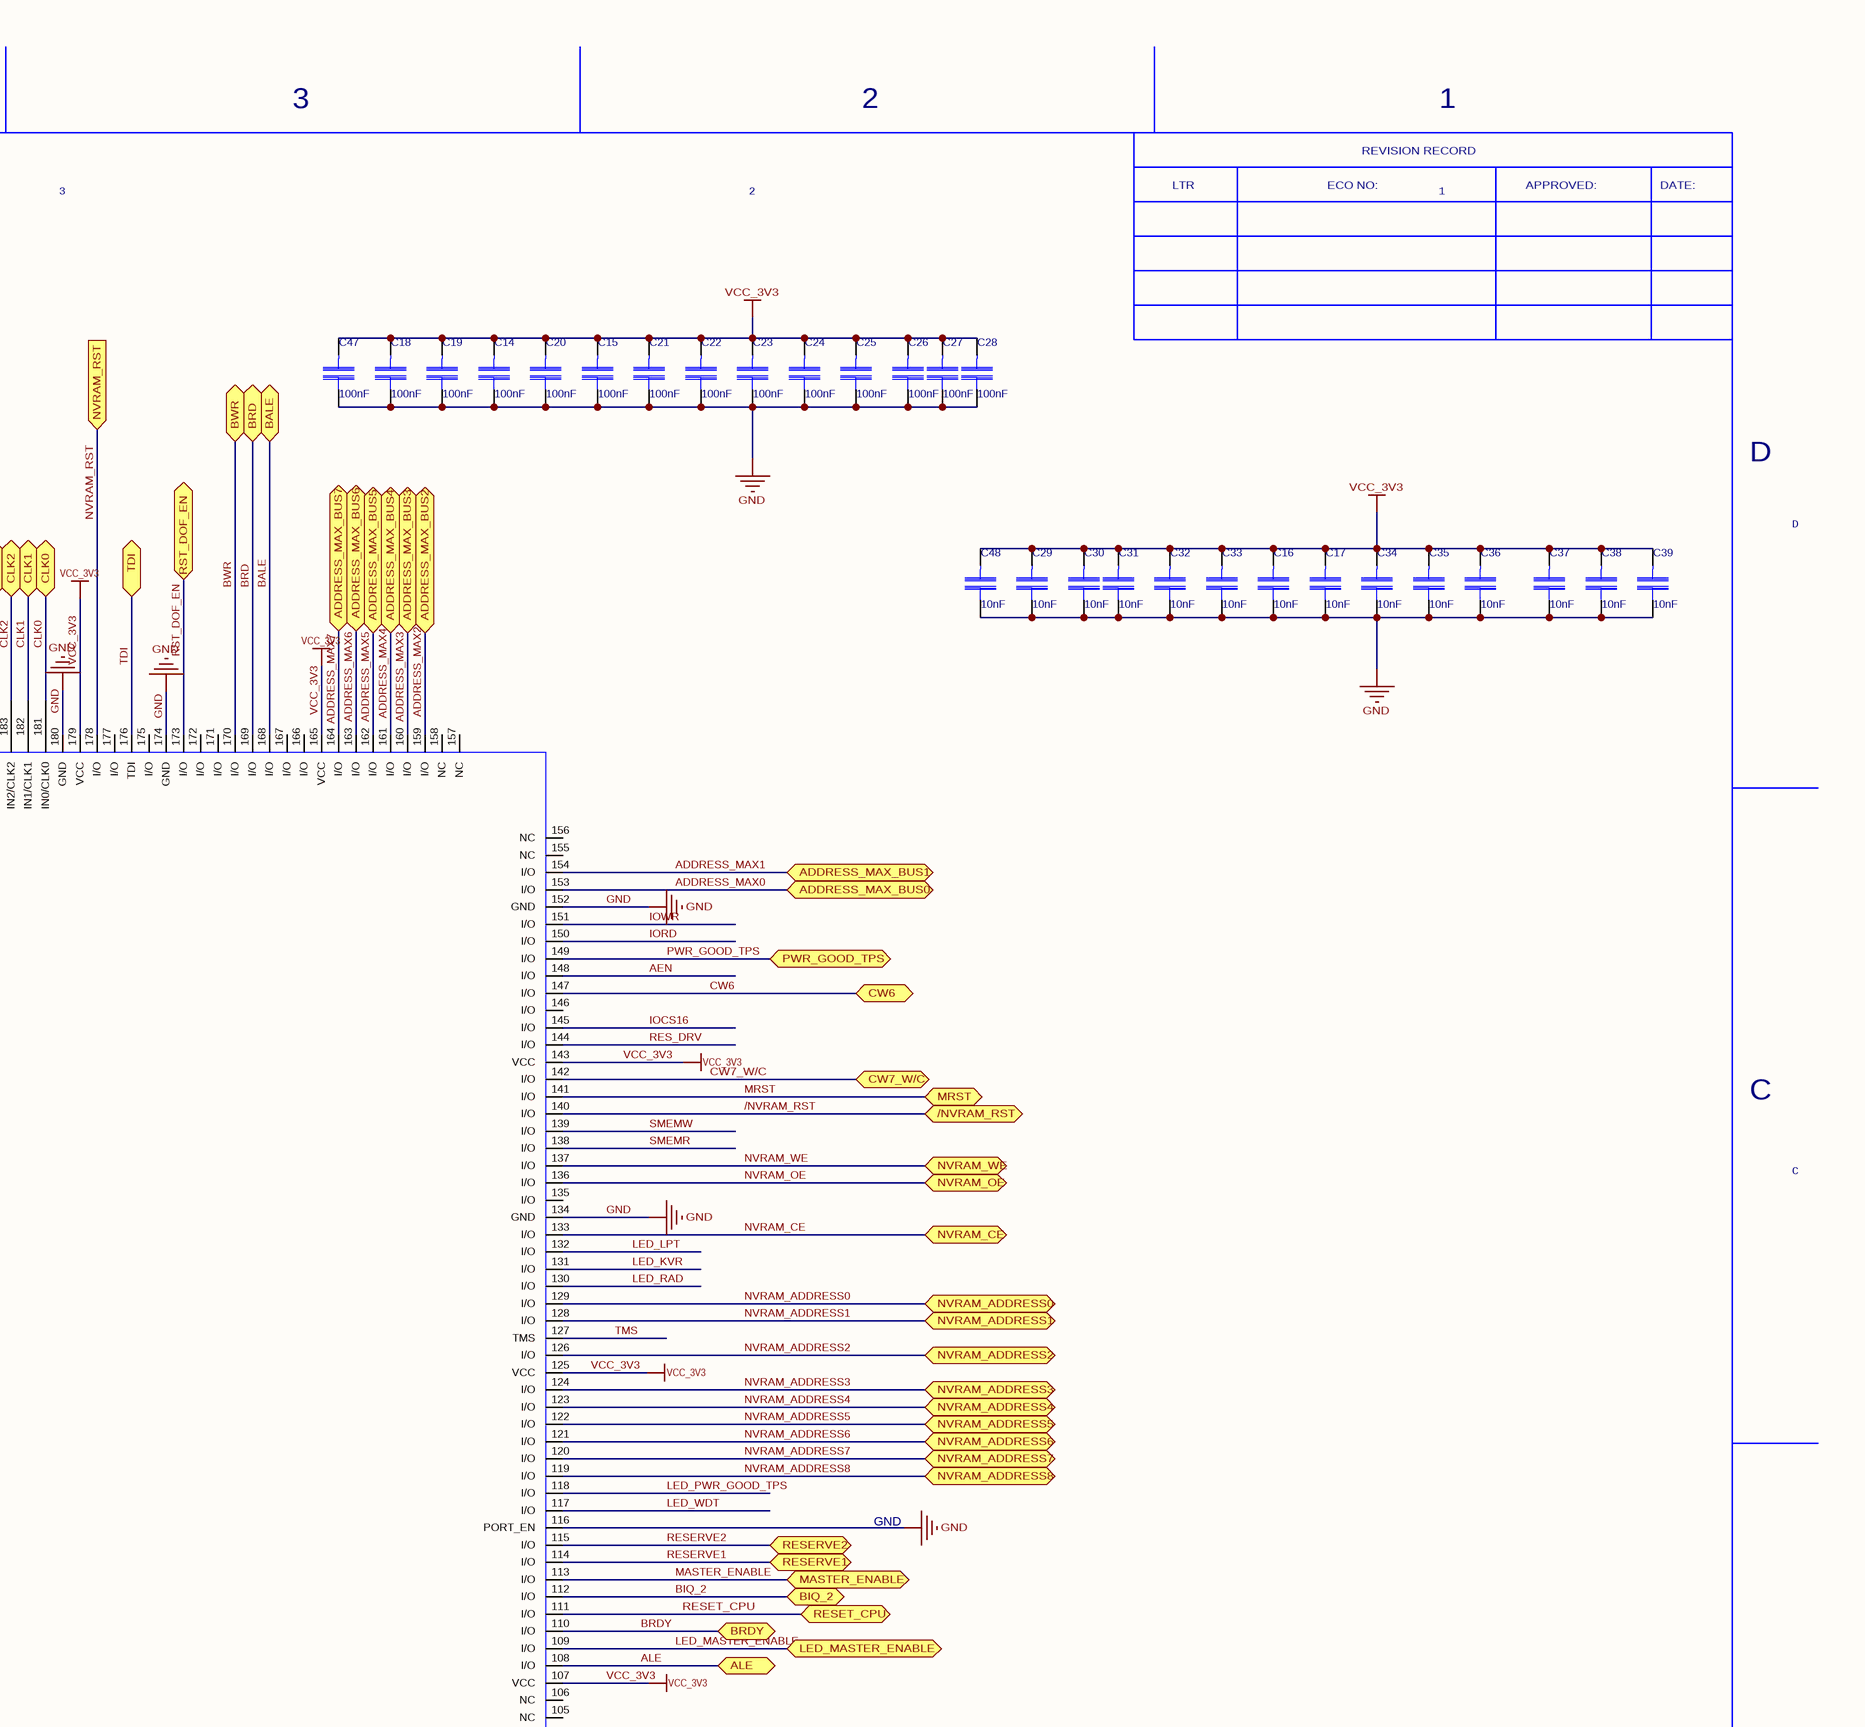
[diagram p9: ISA_XILINX.SchDoc, top right]
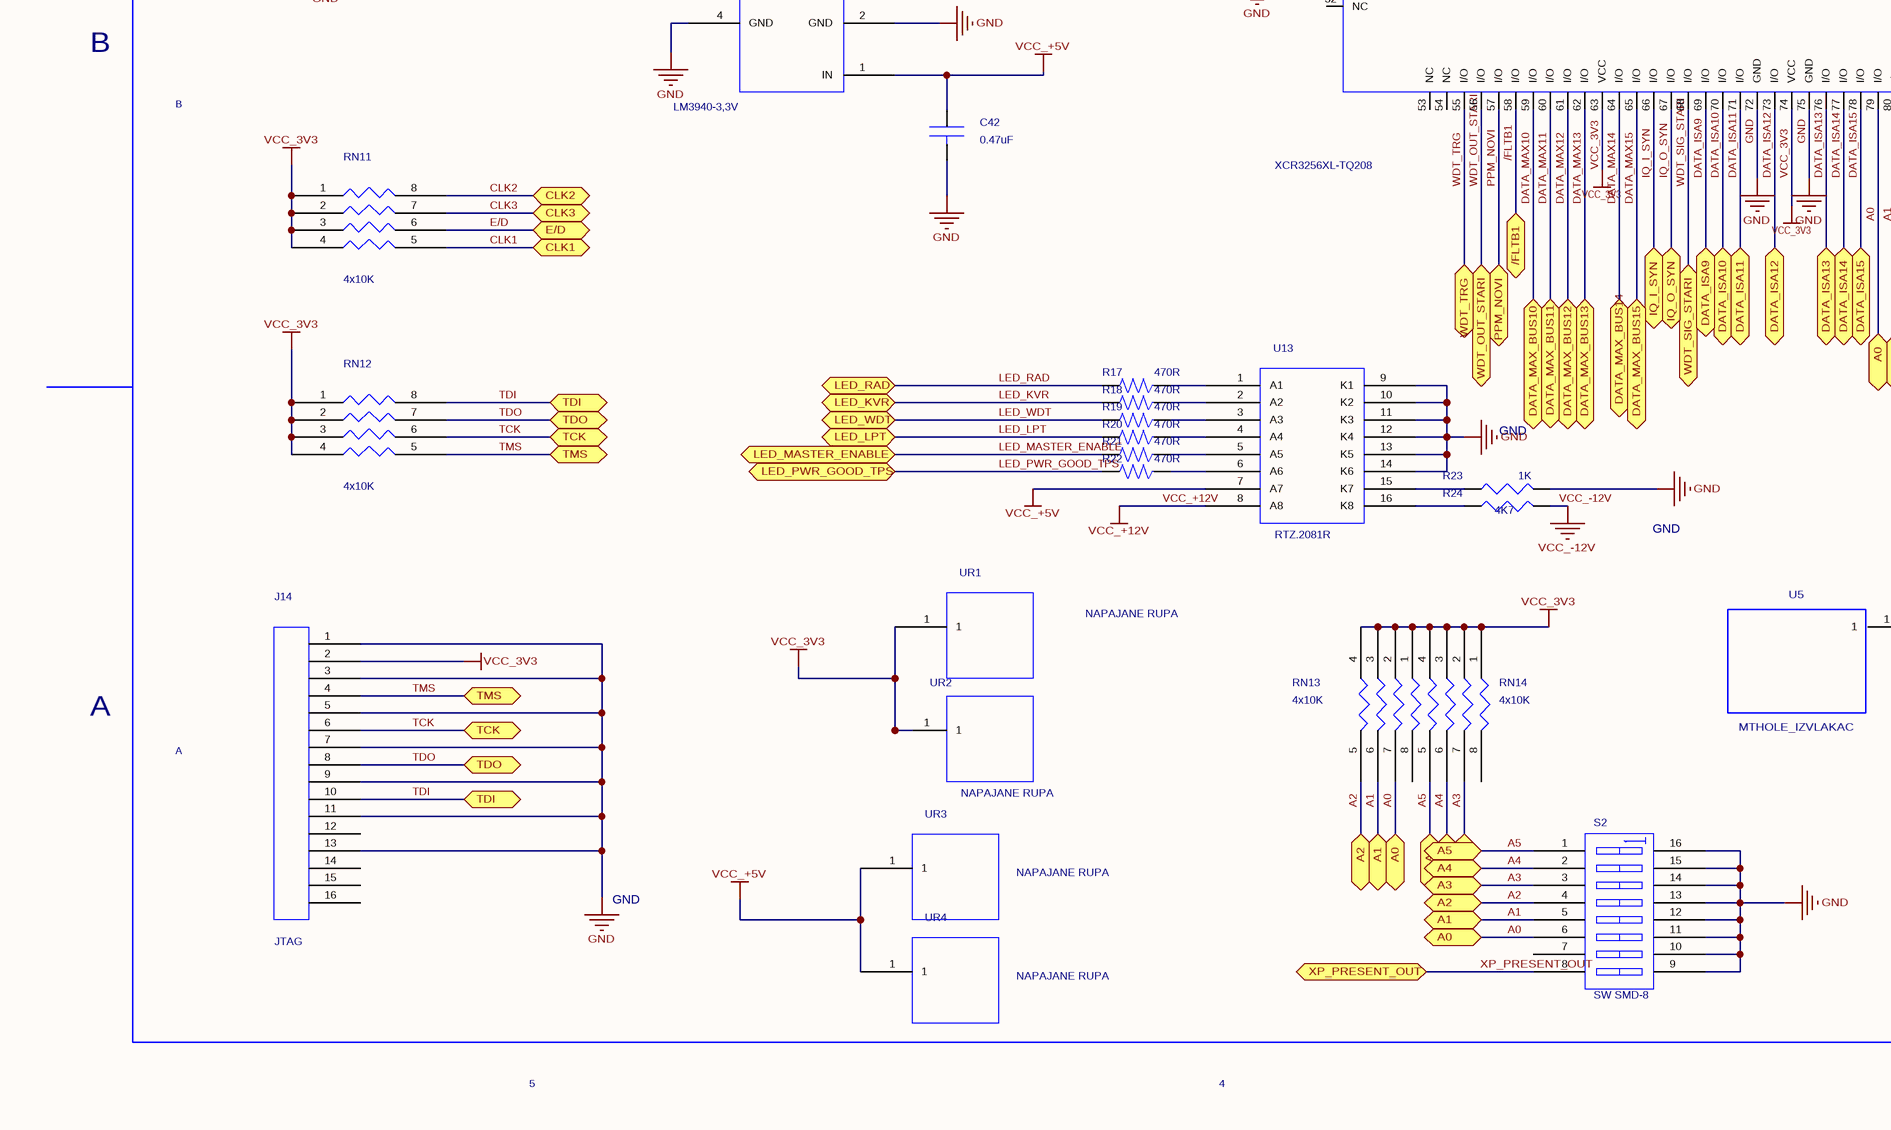
[diagram p10: ISA_XILINX.SchDoc, bottom left]
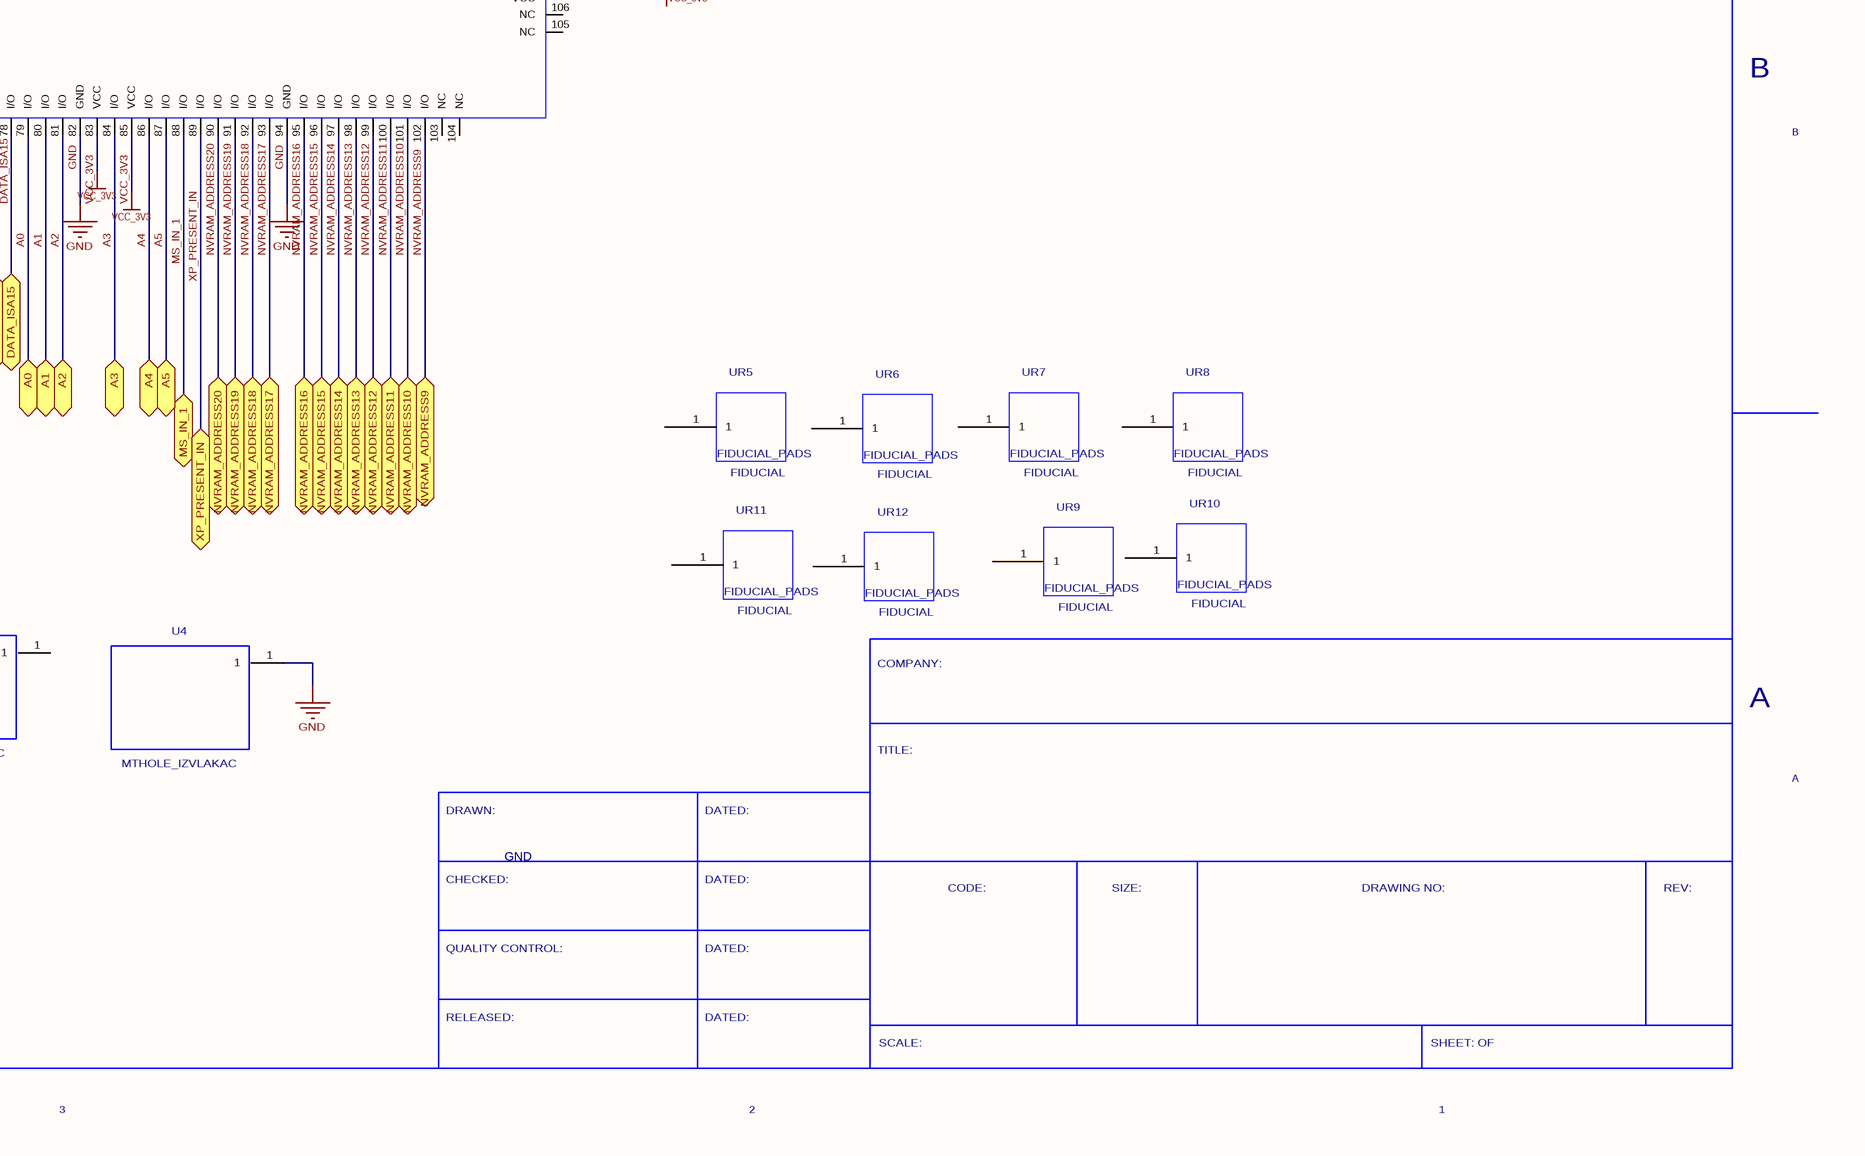
[diagram p11: ISA_XILINX.SchDoc, bottom right]

### Parts
C14  value 100nF  [SM/C_0805]  (hidden comment: C)
C15  value 100nF  [SM/C_0805]  (hidden comment: C)
C16  value 10nF  [SM/C_0805]  (hidden comment: C)
C17  value 10nF  [SM/C_0805]  (hidden comment: C)
C18  value 100nF  [SM/C_0805]  (hidden comment: C)
C19  value 100nF  [SM/C_0805]  (hidden comment: C)
C20  value 100nF  [SM/C_0805]  (hidden comment: C)
C21  value 100nF  [SM/C_0805]  (hidden comment: C)
C22  value 100nF  [SM/C_0805]  (hidden comment: C)
C23  value 100nF  [SM/C_0805]  (hidden comment: C)
C24  value 100nF  [SM/C_0805]  (hidden comment: C)
C25  value 100nF  [SM/C_0805]  (hidden comment: C)
C26  value 100nF  [SM/C_0805]  (hidden comment: C)
C27  value 100nF  [SM/C_0805]  (hidden comment: C)
C28  value 100nF  [SM/C_0805]  (hidden comment: C)
C29  value 10nF  [SM/C_0805]  (hidden comment: C)
C30  value 10nF  [SM/C_0805]  (hidden comment: C)
C31  value 10nF  [SM/C_0805]  (hidden comment: C)
C32  value 10nF  [SM/C_0805]  (hidden comment: C)
C33  value 10nF  [SM/C_0805]  (hidden comment: C)
C34  value 10nF  [SM/C_0805]  (hidden comment: C)
C35  value 10nF  [SM/C_0805]  (hidden comment: C)
C36  value 10nF  [SM/C_0805]  (hidden comment: C)
C37  value 10nF  [SM/C_0805]  (hidden comment: C)
C38  value 10nF  [SM/C_0805]  (hidden comment: C)
C39  value 10nF  [SM/C_0805]  (hidden comment: C)
C40  value 10nF  [SM/C_0805]  (hidden comment: C_4)
C41  value 33uF  [CASE_D_MILOS]  (hidden comment: C_4)
C42  value 0.47uF  [CASE_B_MILOS]  (hidden comment: C_4)
C47  value 100nF  [SM/C_0805]  (hidden comment: C)
C48  value 10nF  [SM/C_0805]  (hidden comment: C)
C50  value 10nF  [SM/C_0805]  (hidden comment: C_4)
D4  value DIODE ZENER_0  [BZV55-C3V3]  (hidden comment: DIODE_ZENER_1)
J11  value HEADER 2/SM  [JUMPER_100]  (hidden comment: HEADER_2/SM)
J13  value HEADER 2/SM  [JUMPER_100]  (hidden comment: HEADER_2/SM)
J14  value JTAG  [JTAG_SMD_REV2]  (hidden comment: CONN_FLEX_16/SM)
J18  value HEADER 2/SM  [JUMPER_100]  (hidden comment: HEADER_2/SM)
R17  value 470R  [SM/R_1206]  (hidden comment: R)
R18  value 470R  [SM/R_1206]  (hidden comment: R)
R19  value 470R  [SM/R_1206]  (hidden comment: R)
R20  value 470R  [SM/R_1206]  (hidden comment: R)
R21  value 470R  [SM/R_1206]  (hidden comment: R)
R22  value 470R  [SM/R_1206]  (hidden comment: R)
R23  value 1K  [SM/R_1206]  (hidden comment: RESISTOR_2)
R24  value 4K7  [SM/R_1206]  (hidden comment: RESISTOR_2)
R30  value 10K  [SM/R_1206]  (hidden comment: R)
RN10  value 4x10K  [SMD_RX4]  (hidden comment: RESAR_IS_4/SM)
RN11  value 4x10K  [SMD_RX4]  (hidden comment: RESAR_IS_4/SM)
RN12  value 4x10K  [SMD_RX4]  (hidden comment: RESAR_IS_4/SM)
RN13  value 4x10K  [SMD_RX4]  (hidden comment: RESAR_IS_4/SM)
RN14  value 4x10K  [SMD_RX4]  (hidden comment: RESAR_IS_4/SM)
S2  value SW SMD-8  [SMD_DIPSW_100]  (hidden comment: SW_DIP-8)
S3  value CON PC104  [PC104_REV13]  (hidden comment: CON_EISAE_0)
STB1  value LM3940-3,3V  [TO263AA_GND_PLANE_REV1]  (hidden comment: LM3940-3_3V)
U4  MTHOLE_IZVLAKAC  [MTH_IZVLAKAC_PADS]
U5  MTHOLE_IZVLAKAC  [MTH_IZVLAKAC_PADS]
U11  XCR3256XL-TQ208  [QUAD.50M/208/WG30.60]
U12  CLK_GEN33  [CLK_GEN33_REV1]
U13  value RTZ.2081R  [LED_8_REV3_PADS]  (hidden comment: LED8X1)
UR1  value NAPAJANE RUPA  [NAPAJANJE_RUPA_REV1]  (hidden comment: NAPAJANE_RUPA)
UR2  value NAPAJANE RUPA  [NAPAJANJE_RUPA_REV1]  (hidden comment: NAPAJANE_RUPA)
UR3  value NAPAJANE RUPA  [NAPAJANJE_RUPA_REV1]  (hidden comment: NAPAJANE_RUPA)
UR4  value NAPAJANE RUPA  [NAPAJANJE_RUPA_REV1]  (hidden comment: NAPAJANE_RUPA)
UR5  FIDUCIAL_PADS  value FIDUCIAL  [FIDUCIAL_R_TOP]
UR6  FIDUCIAL_PADS  value FIDUCIAL  [FIDUCIAL_R_TOP]
UR7  FIDUCIAL_PADS  value FIDUCIAL  [FIDUCIAL_R_TOP]
UR8  FIDUCIAL_PADS  value FIDUCIAL  [FIDUCIAL_R_TOP]
UR9  FIDUCIAL_PADS  value FIDUCIAL  [FIDUCIAL_R_TOP]
UR10  FIDUCIAL_PADS  value FIDUCIAL  [FIDUCIAL_R_TOP]
UR11  FIDUCIAL_PADS  value FIDUCIAL  [FIDUCIAL_R_TOP]
UR12  FIDUCIAL_PADS  value FIDUCIAL  [FIDUCIAL_R_TOP]

### Ports
/FLTB1 (bidir), /NVRAM_RST (bidir), A0 (bidir), A1 (bidir), A2 (bidir), A3 (bidir), A4 (bidir), A5 (bidir), ADDRESS_MAX_BUS0 (bidir), ADDRESS_MAX_BUS1 (bidir), ADDRESS_MAX_BUS2 (bidir), ADDRESS_MAX_BUS3 (bidir), ADDRESS_MAX_BUS4 (bidir), ADDRESS_MAX_BUS5 (bidir), ADDRESS_MAX_BUS6 (bidir), ADDRESS_MAX_BUS7 (bidir), AEN (bidir), ALE (bidir), BALE (bidir), BASE_ADDR_JP0 (bidir), BASE_ADDR_JP1 (bidir), BIQ_1 (bidir), BIQ_2 (bidir), BRD (bidir), BRDY (bidir), BWR (bidir), CLK0 (bidir), CLK1 (bidir), CLK2 (bidir), CLK3 (bidir), CW6 (bidir), CW7_W/C (bidir), DATA_ISA0 (bidir), DATA_ISA1 (bidir), DATA_ISA2 (bidir), DATA_ISA3 (bidir), DATA_ISA4 (bidir), DATA_ISA5 (bidir), DATA_ISA6 (bidir), DATA_ISA7 (bidir), DATA_ISA8 (bidir), DATA_ISA9 (bidir), DATA_ISA10 (bidir), DATA_ISA11 (bidir), DATA_ISA12 (bidir), DATA_ISA13 (bidir), DATA_ISA14 (bidir), DATA_ISA15 (bidir), DATA_MAX_BUS0 (bidir), DATA_MAX_BUS1 (bidir), DATA_MAX_BUS2 (bidir), DATA_MAX_BUS3 (bidir), DATA_MAX_BUS4 (bidir), DATA_MAX_BUS5 (bidir), DATA_MAX_BUS6 (bidir), DATA_MAX_BUS7 (bidir), DATA_MAX_BUS8 (bidir), DATA_MAX_BUS9 (bidir), DATA_MAX_BUS10 (bidir), DATA_MAX_BUS11 (bidir), DATA_MAX_BUS12 (bidir), DATA_MAX_BUS13 (bidir), DATA_MAX_BUS14 (bidir), DATA_MAX_BUS15 (bidir), E/D (bidir), IOCS16 (bidir), IORD (bidir), IOWR (bidir), IQ_I_SYN (bidir), IQ_O_ATP (bidir), IQ_O_SYN (bidir), IRQ9 (bidir), IRQ10 (bidir), IRQ11 (bidir), IRQ12 (bidir), IRQ14 (bidir), IRQ15 (bidir), LA17 (bidir), LA18 (bidir), LA19 (bidir), LA20 (bidir), LA21 (bidir), LA22 (bidir), LA23 (bidir), LED_KVR (bidir), LED_LPT (bidir), LED_MASTER_ENABLE (bidir), LED_PWR_GOOD_TPS (bidir), LED_RAD (bidir), LED_WDT (bidir), MASTER_ENABLE (bidir), MRST (bidir), MS_IN_1 (bidir), NVRAM_ADDRESS0 (bidir), NVRAM_ADDRESS1 (bidir), NVRAM_ADDRESS2 (bidir), NVRAM_ADDRESS3 (bidir), NVRAM_ADDRESS4 (bidir), NVRAM_ADDRESS5 (bidir), NVRAM_ADDRESS6 (bidir), NVRAM_ADDRESS7 (bidir), NVRAM_ADDRESS8 (bidir), NVRAM_ADDRESS9 (bidir), NVRAM_ADDRESS10 (bidir), NVRAM_ADDRESS11 (bidir), NVRAM_ADDRESS12 (bidir), NVRAM_ADDRESS13 (bidir), NVRAM_ADDRESS14 (bidir), NVRAM_ADDRESS15 (bidir), NVRAM_ADDRESS16 (bidir), NVRAM_ADDRESS17 (bidir), NVRAM_ADDRESS18 (bidir), NVRAM_ADDRESS19 (bidir), NVRAM_ADDRESS20 (bidir), NVRAM_CE (bidir), NVRAM_DATA0 (bidir), NVRAM_DATA1 (bidir), NVRAM_DATA2 (bidir), NVRAM_DATA3 (bidir), NVRAM_DATA4 (bidir), NVRAM_DATA5 (bidir), NVRAM_DATA6 (bidir), NVRAM_DATA7 (bidir), NVRAM_OE (bidir), NVRAM_RST, NVRAM_WE (bidir), PPM_NOVI (bidir), PWR_GOOD_TPS (bidir), RESERVE1 (bidir), RESERVE2 (bidir), RESET_CPU (bidir), RST_DOF_EN (bidir), SA0 (bidir), SA1 (bidir), SA2 (bidir), SA3 (bidir), SA4 (bidir), SA5 (bidir), SA6 (bidir), SA7 (bidir), SA8 (bidir), SA9 (bidir), SA10 (bidir), SA11 (bidir), SA12 (bidir), SA13 (bidir), SA14 (bidir), SA15 (bidir), SA16 (bidir), SBHE (bidir), SMEMR (bidir), SMEMW (bidir), TCK (bidir), TDI (bidir), TDO (bidir), TMS (bidir), WDT_OUT_STARI (bidir), WDT_SIG_STARI (bidir), WDT_TRG (bidir), XP_PRESENT_IN (bidir), XP_PRESENT_OUT (bidir)

### Nets
GND: C14.2 C15.2 C16.2 C17.2 C18.2 C19.2 C20.2 C21.2 C22.2 C23.2 C24.2 C25.2 C26.2 C27.2 C28.2 C29.2 C30.2 C31.2 C32.2 C33.2 C34.2 C35.2 C36.2 C37.2 C38.2 C39.2 C40.2 C41.2 C42.2 C47.2 C48.2 C50.2 J11.2 J13.2 J14.1 J14.3 J14.5 J14.7 J14.9 J14.11 J14.13 J18.2 R23.2 S2.9(B8) S2.10(B7) S2.11(B6) S2.12(B5) S2.13(B4) S2.14(B3) S2.15(B2) S2.16(B1) S3.A32 S3.B1 S3.B10 S3.B31 S3.B32 S3.C0 S3.C19 S3.D0 S3.D18 S3.D19 STB1.2(GND) STB1.4(GND) U4.1 U11.14(GND) U11.32(GND) U11.50(GND) U11.72(GND) U11.75(GND) U11.82(GND) U11.94(GND) U11.116(PORT_EN) U11.134(GND) U11.152(GND) U11.174(GND) U11.180(GND) U11.185(GND) U11.200(GND) U12.2(GND) U13.9(K1) U13.10(K2) U13.11(K3) U13.12(K4) U13.13(K5) U13.14(K6)
VCC_3V3: C14.1 C15.1 C16.1 C17.1 C18.1 C19.1 C20.1 C21.1 C22.1 C23.1 C24.1 C25.1 C26.1 C27.1 C28.1 C29.1 C30.1 C31.1 C32.1 C33.1 C34.1 C35.1 C36.1 C37.1 C38.1 C39.1 C40.1 C41.1 C47.1 C48.1 C50.1 D4.1(ANODE) J14.2 R30.2 RN10.1 RN10.2 RN10.3 RN10.4 RN11.1 RN11.2 RN11.3 RN11.4 RN12.1 RN12.2 RN12.3 RN12.4 RN13.1 RN13.2 RN13.3 RN13.4 RN14.1 RN14.2 RN14.3 RN14.4 STB1.3(OUT) U11.5(VCC) U11.23(VCC) U11.41(VCC) U11.63(VCC) U11.74(VCC) U11.83(VCC) U11.85(VCC) U11.107(VCC) U11.125(VCC) U11.143(VCC) U11.165(VCC) U11.179(VCC) U11.186(VCC) U11.191(VCC) U12.4(VDD) UR1.1 UR2.1
VCC_+5V: C42.1 D4.2(CATHODE) S3.B3 S3.B29 S3.D16 STB1.1(IN) U13.7(A7) UR3.1 UR4.1
VCC_+12V: U13.8(A8)
VCC_-12V: R24.2
/FLTB1: U11.58(I/O) ; port /FLTB1
/NVRAM_RST: U11.140(I/O) ; port /NVRAM_RST
A0: RN13.7 S2.6(A6) U11.79(I/O) ; port A0
A1: RN13.6 S2.5(A5) U11.80(I/O) ; port A1
A2: RN13.5 S2.4(A4) U11.81(I/O) ; port A2
A3: RN14.7 S2.3(A3) U11.84(I/O) ; port A3
A4: RN14.6 S2.2(A2) U11.86(I/O) ; port A4
A5: RN14.5 S2.1(A1) U11.87(I/O) ; port A5
ADDRESS_MAX0: U11.153(I/O) ; port ADDRESS_MAX_BUS0
ADDRESS_MAX1: U11.154(I/O) ; port ADDRESS_MAX_BUS1
ADDRESS_MAX2: U11.159(I/O) ; port ADDRESS_MAX_BUS2
ADDRESS_MAX3: U11.160(I/O) ; port ADDRESS_MAX_BUS3
ADDRESS_MAX4: U11.161(I/O) ; port ADDRESS_MAX_BUS4
ADDRESS_MAX5: U11.162(I/O) ; port ADDRESS_MAX_BUS5
ADDRESS_MAX6: U11.163(I/O) ; port ADDRESS_MAX_BUS6
ADDRESS_MAX7: U11.164(I/O) ; port ADDRESS_MAX_BUS7
AEN: S3.A11 U11.148(I/O) ; port AEN
ALE: S3.B28 U11.108(I/O) ; port ALE
BALE: U11.168(I/O) ; port BALE
BASE_ADDR_JP0: J11.1 RN10.8 U11.21(I/O) ; port BASE_ADDR_JP0
BASE_ADDR_JP1: J13.1 RN10.7 U11.22(I/O) ; port BASE_ADDR_JP1
BIQ_1: U11.25(I/O) ; port BIQ_1
BIQ_2: U11.112(I/O) ; port BIQ_2
BRD: U11.169(I/O) ; port BRD
BRDY: U11.110(I/O) ; port BRDY
BWR: U11.170(I/O) ; port BWR
CLK0: U11.181(IN0/CLK0) U12.3(OUT) ; port CLK0
CLK1: RN11.5 U11.182(IN1/CLK1) ; port CLK1
CLK2: RN11.8 U11.183(IN2/CLK2) ; port CLK2
CLK3: RN11.7 U11.184(IN3/CLK3) ; port CLK3
CW6: U11.147(I/O) ; port CW6
CW7_W/C: U11.142(I/O) ; port CW7_W/C
DATA_ISA0: S3.A9 U11.28(I/O) ; port DATA_ISA0
DATA_ISA1: S3.A8 U11.29(I/O) ; port DATA_ISA1
DATA_ISA2: S3.A7 U11.31(I/O) ; port DATA_ISA2
DATA_ISA3: S3.A6 U11.33(I/O) ; port DATA_ISA3
DATA_ISA4: S3.A5 U11.34(I/O) ; port DATA_ISA4
DATA_ISA5: S3.A4 U11.35(I/O) ; port DATA_ISA5
DATA_ISA6: S3.A3 U11.36(I/O) ; port DATA_ISA6
DATA_ISA7: S3.A2 U11.37(I/O) ; port DATA_ISA7
DATA_ISA8: S3.C11 U11.38(I/O) ; port DATA_ISA8
DATA_ISA9: S3.C12 U11.69(I/O) ; port DATA_ISA9
DATA_ISA10: S3.C13 U11.70(I/O) ; port DATA_ISA10
DATA_ISA11: S3.C14 U11.71(I/O) ; port DATA_ISA11
DATA_ISA12: S3.C15 U11.73(I/O) ; port DATA_ISA12
DATA_ISA13: S3.C16 U11.76(I/O) ; port DATA_ISA13
DATA_ISA14: S3.C17 U11.77(I/O) ; port DATA_ISA14
DATA_ISA15: S3.C18 U11.78(I/O) ; port DATA_ISA15
DATA_MAX0: U11.39(I/O) ; port DATA_MAX_BUS0
DATA_MAX1: U11.40(I/O) ; port DATA_MAX_BUS1
DATA_MAX2: U11.42(I/O) ; port DATA_MAX_BUS2
DATA_MAX3: U11.43(I/O) ; port DATA_MAX_BUS3
DATA_MAX4: U11.44(I/O) ; port DATA_MAX_BUS4
DATA_MAX5: U11.45(I/O) ; port DATA_MAX_BUS5
DATA_MAX6: U11.46(I/O) ; port DATA_MAX_BUS6
DATA_MAX7: U11.47(I/O) ; port DATA_MAX_BUS7
DATA_MAX8: U11.48(I/O) ; port DATA_MAX_BUS8
DATA_MAX9: U11.49(I/O) ; port DATA_MAX_BUS9
DATA_MAX10: U11.59(I/O) ; port DATA_MAX_BUS10
DATA_MAX11: U11.60(I/O) ; port DATA_MAX_BUS11
DATA_MAX12: U11.61(I/O) ; port DATA_MAX_BUS12
DATA_MAX13: U11.62(I/O) ; port DATA_MAX_BUS13
DATA_MAX14: U11.64(I/O) ; port DATA_MAX_BUS14
DATA_MAX15: U11.65(I/O) ; port DATA_MAX_BUS15
E/D: RN11.6 U12.1(E/D) ; port E/D
IOCS16: S3.D2 U11.145(I/O) ; port IOCS16
IORD: S3.B14 U11.150(I/O) ; port IORD
IOWR: S3.B13 U11.151(I/O) ; port IOWR
IQ_I_SYN: U11.66(I/O) ; port IQ_I_SYN
IQ_O_ATP: U11.26(I/O) ; port IQ_O_ATP
IQ_O_SYN: U11.67(I/O) ; port IQ_O_SYN
IRQ9: S3.B4 ; port IRQ9
IRQ10: S3.D3 ; port IRQ10
IRQ11: S3.D4 ; port IRQ11
IRQ12: S3.D5 ; port IRQ12
IRQ14: S3.D7 ; port IRQ14
IRQ15: S3.D6 ; port IRQ15
LA17: S3.A14 U11.199(I/O) ; port LA17
LA18: S3.A13 U11.201(I/O) ; port LA18
LA19: S3.A12 U11.202(I/O) ; port LA19
LA20: S3.C5 U11.203(I/O) ; port LA20
LA21: S3.C4 U11.204(I/O) ; port LA21
LA22: S3.C3 U11.205(I/O) ; port LA22
LA23: S3.C2 U11.206(I/O) ; port LA23
LED_KVR: R18.2 U11.131(I/O) ; port LED_KVR
LED_LPT: R20.2 U11.132(I/O) ; port LED_LPT
LED_MASTER_ENABLE: R21.2 U11.109(I/O) ; port LED_MASTER_ENABLE
LED_PWR_GOOD_TPS: R22.2 U11.118(I/O) ; port LED_PWR_GOOD_TPS
LED_RAD: R17.2 U11.130(I/O) ; port LED_RAD
LED_WDT: R19.2 U11.117(I/O) ; port LED_WDT
MASTER_ENABLE: U11.113(I/O) ; port MASTER_ENABLE
MRST: U11.141(I/O) ; port MRST
MS_IN_1: U11.88(I/O) ; port MS_IN_1
NVRAM_ADDRESS0: U11.129(I/O) ; port NVRAM_ADDRESS0
NVRAM_ADDRESS1: U11.128(I/O) ; port NVRAM_ADDRESS1
NVRAM_ADDRESS2: U11.126(I/O) ; port NVRAM_ADDRESS2
NVRAM_ADDRESS3: U11.124(I/O) ; port NVRAM_ADDRESS3
NVRAM_ADDRESS4: U11.123(I/O) ; port NVRAM_ADDRESS4
NVRAM_ADDRESS5: U11.122(I/O) ; port NVRAM_ADDRESS5
NVRAM_ADDRESS6: U11.121(I/O) ; port NVRAM_ADDRESS6
NVRAM_ADDRESS7: U11.120(I/O) ; port NVRAM_ADDRESS7
NVRAM_ADDRESS8: U11.119(I/O) ; port NVRAM_ADDRESS8
NVRAM_ADDRESS9: U11.102(I/O) ; port NVRAM_ADDRESS9
NVRAM_ADDRESS10: U11.101(I/O) ; port NVRAM_ADDRESS10
NVRAM_ADDRESS11: U11.100(I/O) ; port NVRAM_ADDRESS11
NVRAM_ADDRESS12: U11.99(I/O) ; port NVRAM_ADDRESS12
NVRAM_ADDRESS13: U11.98(I/O) ; port NVRAM_ADDRESS13
NVRAM_ADDRESS14: U11.97(I/O) ; port NVRAM_ADDRESS14
NVRAM_ADDRESS15: U11.96(I/O) ; port NVRAM_ADDRESS15
NVRAM_ADDRESS16: U11.95(I/O) ; port NVRAM_ADDRESS16
NVRAM_ADDRESS17: U11.93(I/O) ; port NVRAM_ADDRESS17
NVRAM_ADDRESS18: U11.92(I/O) ; port NVRAM_ADDRESS18
NVRAM_ADDRESS19: U11.91(I/O) ; port NVRAM_ADDRESS19
NVRAM_ADDRESS20: U11.90(I/O) ; port NVRAM_ADDRESS20
NVRAM_CE: U11.133(I/O) ; port NVRAM_CE
NVRAM_DATA0: U11.188(I/O) ; port NVRAM_DATA0
NVRAM_DATA1: U11.190(I/O) ; port NVRAM_DATA1
NVRAM_DATA2: U11.192(I/O) ; port NVRAM_DATA2
NVRAM_DATA3: U11.193(I/O) ; port NVRAM_DATA3
NVRAM_DATA4: U11.194(I/O) ; port NVRAM_DATA4
NVRAM_DATA5: U11.195(I/O) ; port NVRAM_DATA5
NVRAM_DATA6: U11.196(I/O) ; port NVRAM_DATA6
NVRAM_DATA7: U11.197(I/O) ; port NVRAM_DATA7
NVRAM_OE: U11.136(I/O) ; port NVRAM_OE
NVRAM_RST: U11.178(I/O) ; port NVRAM_RST
NVRAM_WE: U11.137(I/O) ; port NVRAM_WE
PPM_NOVI: U11.57(I/O) ; port PPM_NOVI
PWR_GOOD_TPS: U11.149(I/O) ; port PWR_GOOD_TPS
RES_DRV: S3.B2 U11.144(I/O)
RESERVE1: U11.114(I/O) ; port RESERVE1
RESERVE2: U11.115(I/O) ; port RESERVE2
RESET_CPU: U11.111(I/O) ; port RESET_CPU
RST_DOF_EN: J18.1 R30.1 U11.173(I/O) ; port RST_DOF_EN
SA0: S3.A31 U11.3(I/O) ; port SA0
SA1: S3.A30 U11.4(I/O) ; port SA1
SA2: S3.A29 U11.6(I/O) ; port SA2
SA3: S3.A28 U11.7(I/O) ; port SA3
SA4: S3.A27 U11.8(I/O) ; port SA4
SA5: S3.A26 U11.9(I/O) ; port SA5
SA6: S3.A25 U11.10(I/O) ; port SA6
SA7: S3.A24 U11.11(I/O) ; port SA7
SA8: S3.A23 U11.12(I/O) ; port SA8
SA9: S3.A22 U11.13(I/O) ; port SA9
SA10: S3.A21 U11.15(I/O) ; port SA10
SA11: S3.A20 U11.16(I/O) ; port SA11
SA12: S3.A19 U11.17(I/O) ; port SA12
SA13: S3.A18 U11.18(I/O) ; port SA13
SA14: S3.A17 U11.19(I/O) ; port SA14
SA15: S3.A16 U11.20(I/O) ; port SA15
SA16: S3.A15 U11.198(I/O) ; port SA16
SBHE: S3.C1 U11.187(I/O) ; port SBHE
SMEMR: S3.B12 U11.138(I/O) ; port SMEMR
SMEMW: S3.B11 U11.139(I/O) ; port SMEMW
TCK: J14.6 RN12.6 U11.30(TCK) ; port TCK
TDI: J14.10 RN12.8 U11.176(TDI) ; port TDI
TDO: J14.8 RN12.7 U11.189(TDO) ; port TDO
TMS: J14.4 RN12.5 U11.127(TMS) ; port TMS
WDT_OUT_STARI: U11.56(I/O) ; port WDT_OUT_STARI
WDT_SIG_STARI: U11.68(I/O) ; port WDT_SIG_STARI
WDT_TRG: U11.55(I/O) ; port WDT_TRG
XP_PRESENT_IN: RN10.5 U11.89(I/O) ; port XP_PRESENT_IN
XP_PRESENT_OUT: S2.8(A8) ; port XP_PRESENT_OUT
NetR17_1: R17.1 U13.1(A1)
NetR18_1: R18.1 U13.2(A2)
NetR19_1: R19.1 U13.3(A3)
NetR20_1: R20.1 U13.4(A4)
NetR21_1: R21.1 U13.5(A5)
NetR22_1: R22.1 U13.6(A6)
NetR23_1: R23.1 U13.15(K7)
NetR24_1: R24.1 U13.16(K8)

Not connected (* = marked no-connect by the designer): J14 12 14 15 16; RN10 6; RN13 8; RN14 8; S2 7(A7); S3 A1 A10 B5 B6 B7 B8 B9 B15 B16 B17 B18 B19 B20 B21 B22 B23 B24 B25 B26 B27 B30 C6 C7 C8 C9 C10 D1 D8 D9 D10 D11 D12 D13 D14 D15 D17; U5 1; U11 1(NC) 2(NC) 24(I/O) 27(I/O) 51(NC) 52(NC) 53(NC) 54(NC) 103(NC) 104(NC) 105(NC) 106(NC) 135(I/O) 146(I/O) 155(NC) 156(NC) 157(NC) 158(NC) 166(I/O) 167(I/O) 171(I/O) 172(I/O) 175(I/O) 177(I/O) 207(NC) 208(NC); UR5 1; UR6 1; UR7 1; UR8 1; UR9 1; UR10 1; UR11 1; UR12 1

### Notes on the sheet
- 6
- 5
- 4
- 3
- 2
- 1
- LTR
- ECO NO:
- REVISION RECORD
- APPROVED:
- DATE:
- D
- C
- GND
- B
- COMPANY:
- A
- TITLE:
- DRAWN:
- DATED:
- CHECKED:
- CODE:
- SIZE:
- DRAWING NO:
- REV:
- QUALITY CONTROL:
- RELEASED:
- SCALE:
- SHEET: OF
- Labels drawn without touching a wire or pin: VCC_3V3

### Library data of the parts
C14-C39 C47 C48 = C: as C1 on sheet MAX_BUS; PCB DECAL: SM/C_0805
C40-C42 C50 = C_4: Source_Path: C:\ORCAD\ORCAD_10.5\TOOLS\CAPTURE\LIBRARY\IEC\DEVICE.OLB
  C40 C50: PCB DECAL: SM/C_0805
  C41: PCB DECAL: CASE_D_MILOS
  C42: PCB DECAL: CASE_B_MILOS
D4 = DIODE_ZENER_1: Source_Path: E:\MILOS\PROJECTS\ATLAS_XP2V3\ATLAS_XP2V3.DSN; PCB DECAL: BZV55-C3V3
J11 J13 J18 = HEADER_2/SM: Source_Path: C:\ORCAD\ORCAD_10.5\TOOLS\CAPTURE\LIBRARY\CONNECTOR.OLB; PCB DECAL: JUMPER_100
J14 = CONN_FLEX_16/SM: Source_Path: C:\ORCAD\ORCAD_10.5\TOOLS\CAPTURE\LIBRARY\CONNECTOR.OLB; PCB DECAL: JTAG_SMD_REV2
R17-R22 R30 = R: as R25 on sheet MAX_BUS; PCB DECAL: SM/R_1206
R23 R24 = RESISTOR_2: as R1 on sheet MAX_BUS; PCB DECAL: SM/R_1206
RN10-RN14 = RESAR_IS_4/SM: as RN1 on sheet MAX_BUS; PCB DECAL: SMD_RX4
S2 = SW_DIP-8: Source_Path: C:\CADENCE\PSD_15.1\TOOLS\CAPTURE\LIBRARY\OLDLIBS\DEVICE.OLB; PCB DECAL: SMD_DIPSW_100
S3 = CON_EISAE_0: Source_Path: C:\CADENCE\PSD_15.1\TOOLS\ATLAS_ITA\ATLAS_ITA.DSN; PCB DECAL: PC104_REV13
STB1 = LM3940-3_3V: Source_Path: C:\PROJECTS\VHDL_PROJEKTI\DIS32\BIS32_16\BIS32_16.OLB; PCB DECAL: TO263AA_GND_PLANE_REV1
U4 U5 = MTHOLE_IZVLAKAC: Rupa za Rittal-ov izvlakac; PCB DECAL: MTH_IZVLAKAC_PADS
U11 = XCR3256XL-TQ208: Source_Path: C:\PROJECTS\XILINX_ORCAD_LIB\XILINX.OLB; PCB DECAL: QUAD.50M/208/WG30.60; Value: XCR3256XL-TQ208
U12 = CLK_GEN33: Source_Path: C:\PROJECTS\VHDL_PROJEKTI\DIS32\BIS32_16\BIS32_16.OLB; PCB DECAL: CLK_GEN33_REV1; Value: CLK_GEN33
U13 = LED8X1: Source_Path: C:\CADENCE\PSD_15.1\TOOLS\ATLAS_ITA\LIBRARY1.OLB; Geometry.Height: 5.08mm; Order No: 31 G 7692 Buerklin; PCB DECAL: LED_8_REV3_PADS; Description: LED8x1; Footprint: LED_8_REV2
UR1-UR4 = NAPAJANE_RUPA: Source_Path: E:\MILOS\PROJECTS\OBRTOMER\BPC02REV1\LIBRARY1.OLB; PCB DECAL: NAPAJANJE_RUPA_REV1
UR5-UR12 = FIDUCIAL_PADS: Source_Path: C:\BEKAP STAROG RACUNARA\FOHUB1\FO-HUB1VER.1.01\FOHUB1\SEME\HFBR0050Z.OLB; Geometry.Height: 10.00mil; PCB DECAL: FIDUCIAL_R_TOP

## Sheet WDT_TASTERI_M_S.SchDoc: ATLAS_XP2V5
size 558 x 431 mm; Organization: IMP Automatika d.o.o.; Revision: V5
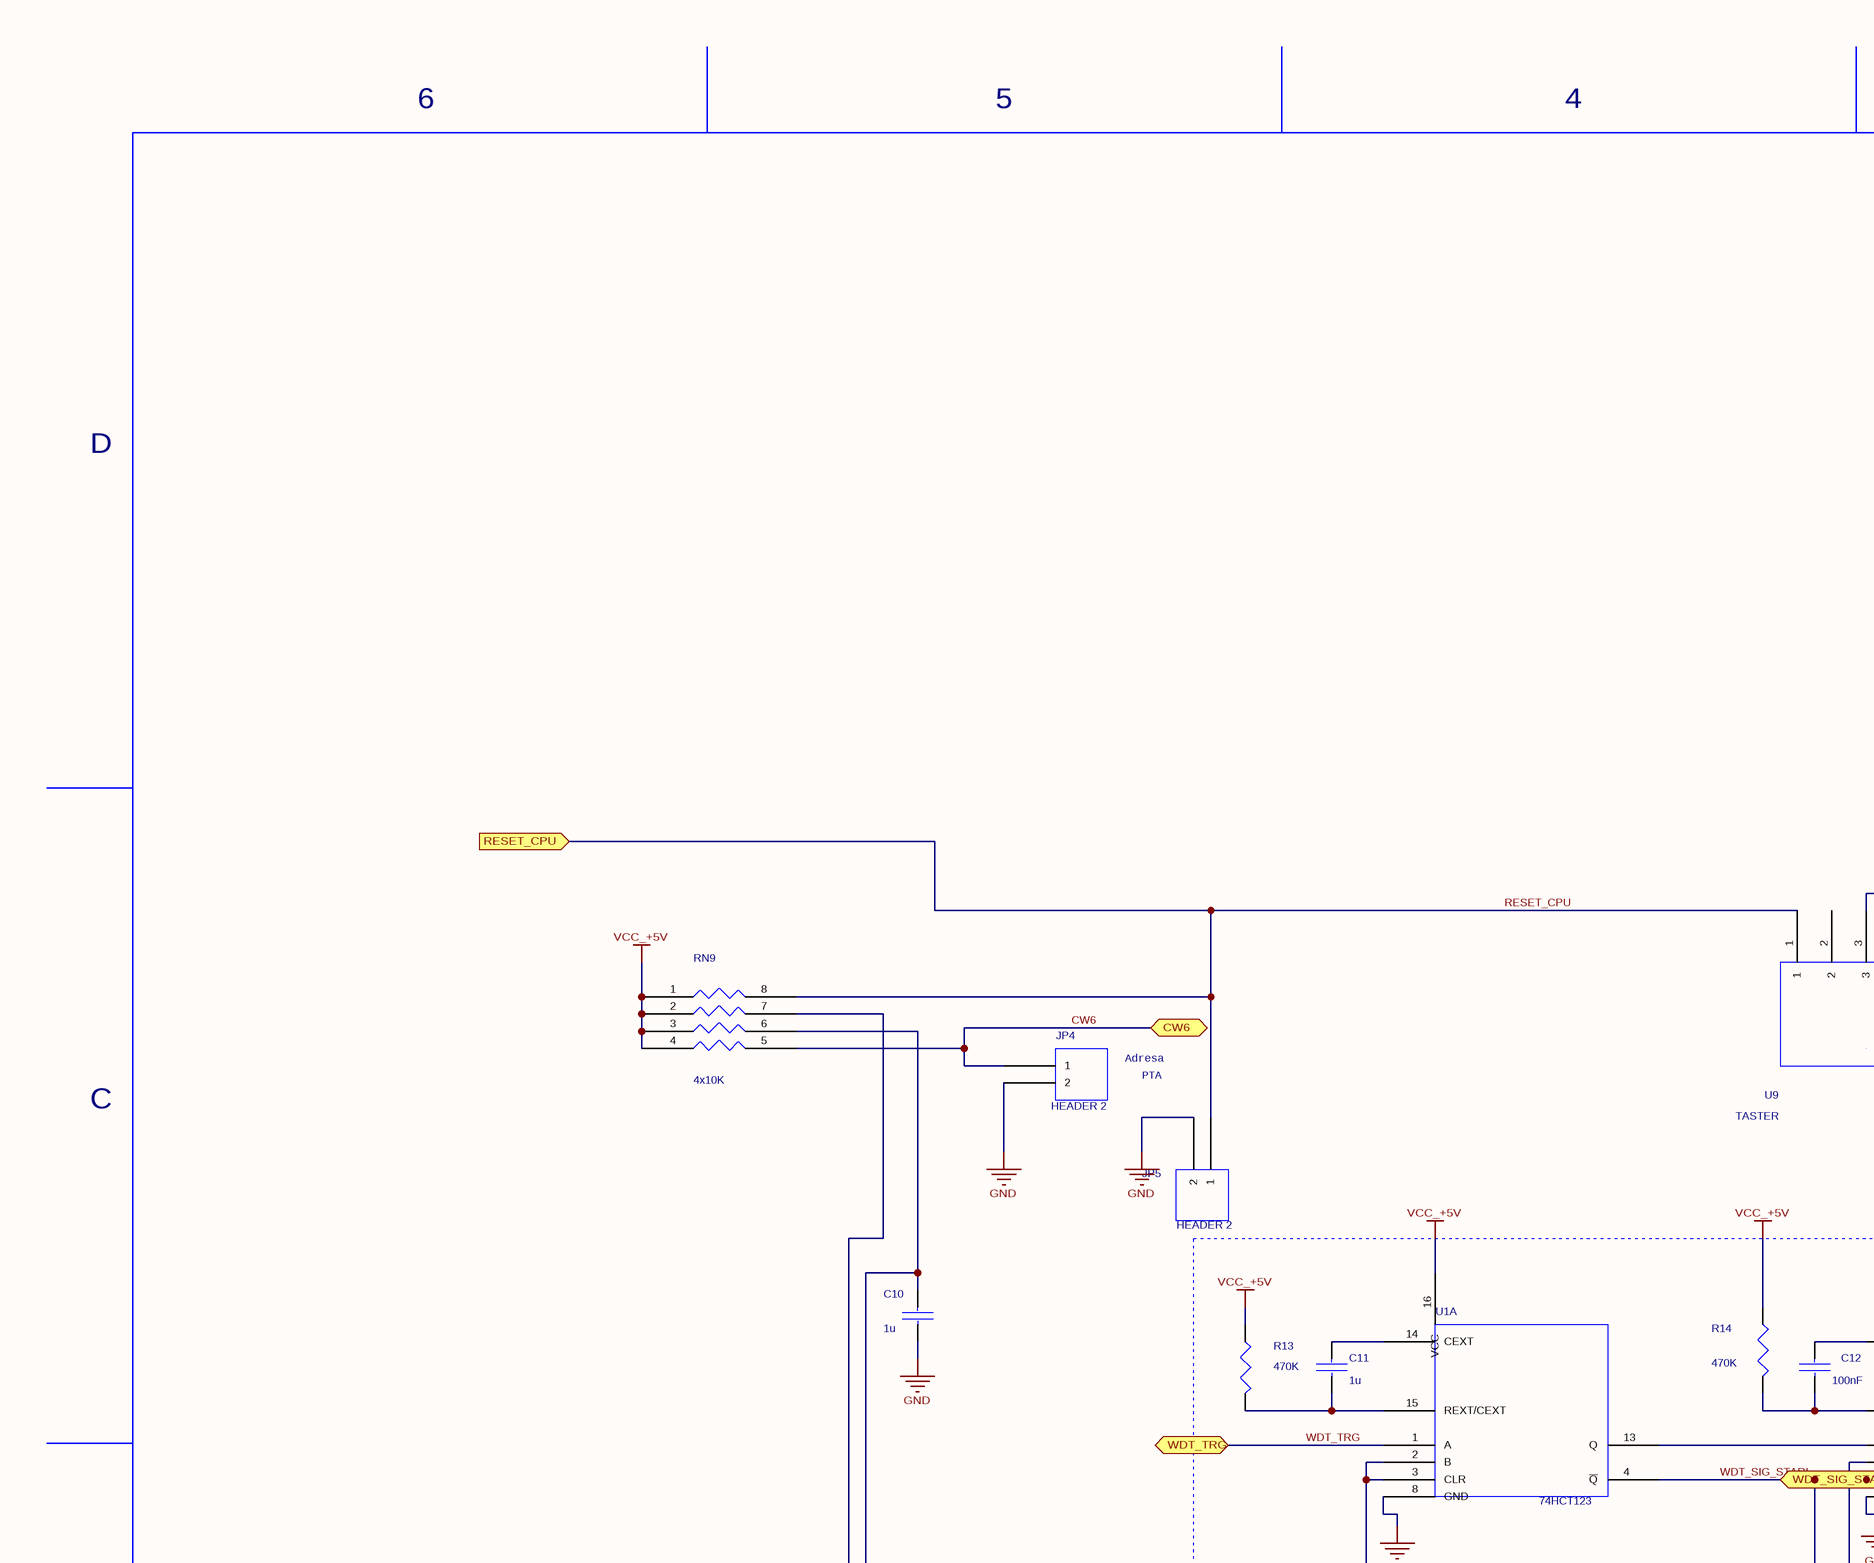
[diagram p12: WDT_TASTERI_M_S.SchDoc, top left]
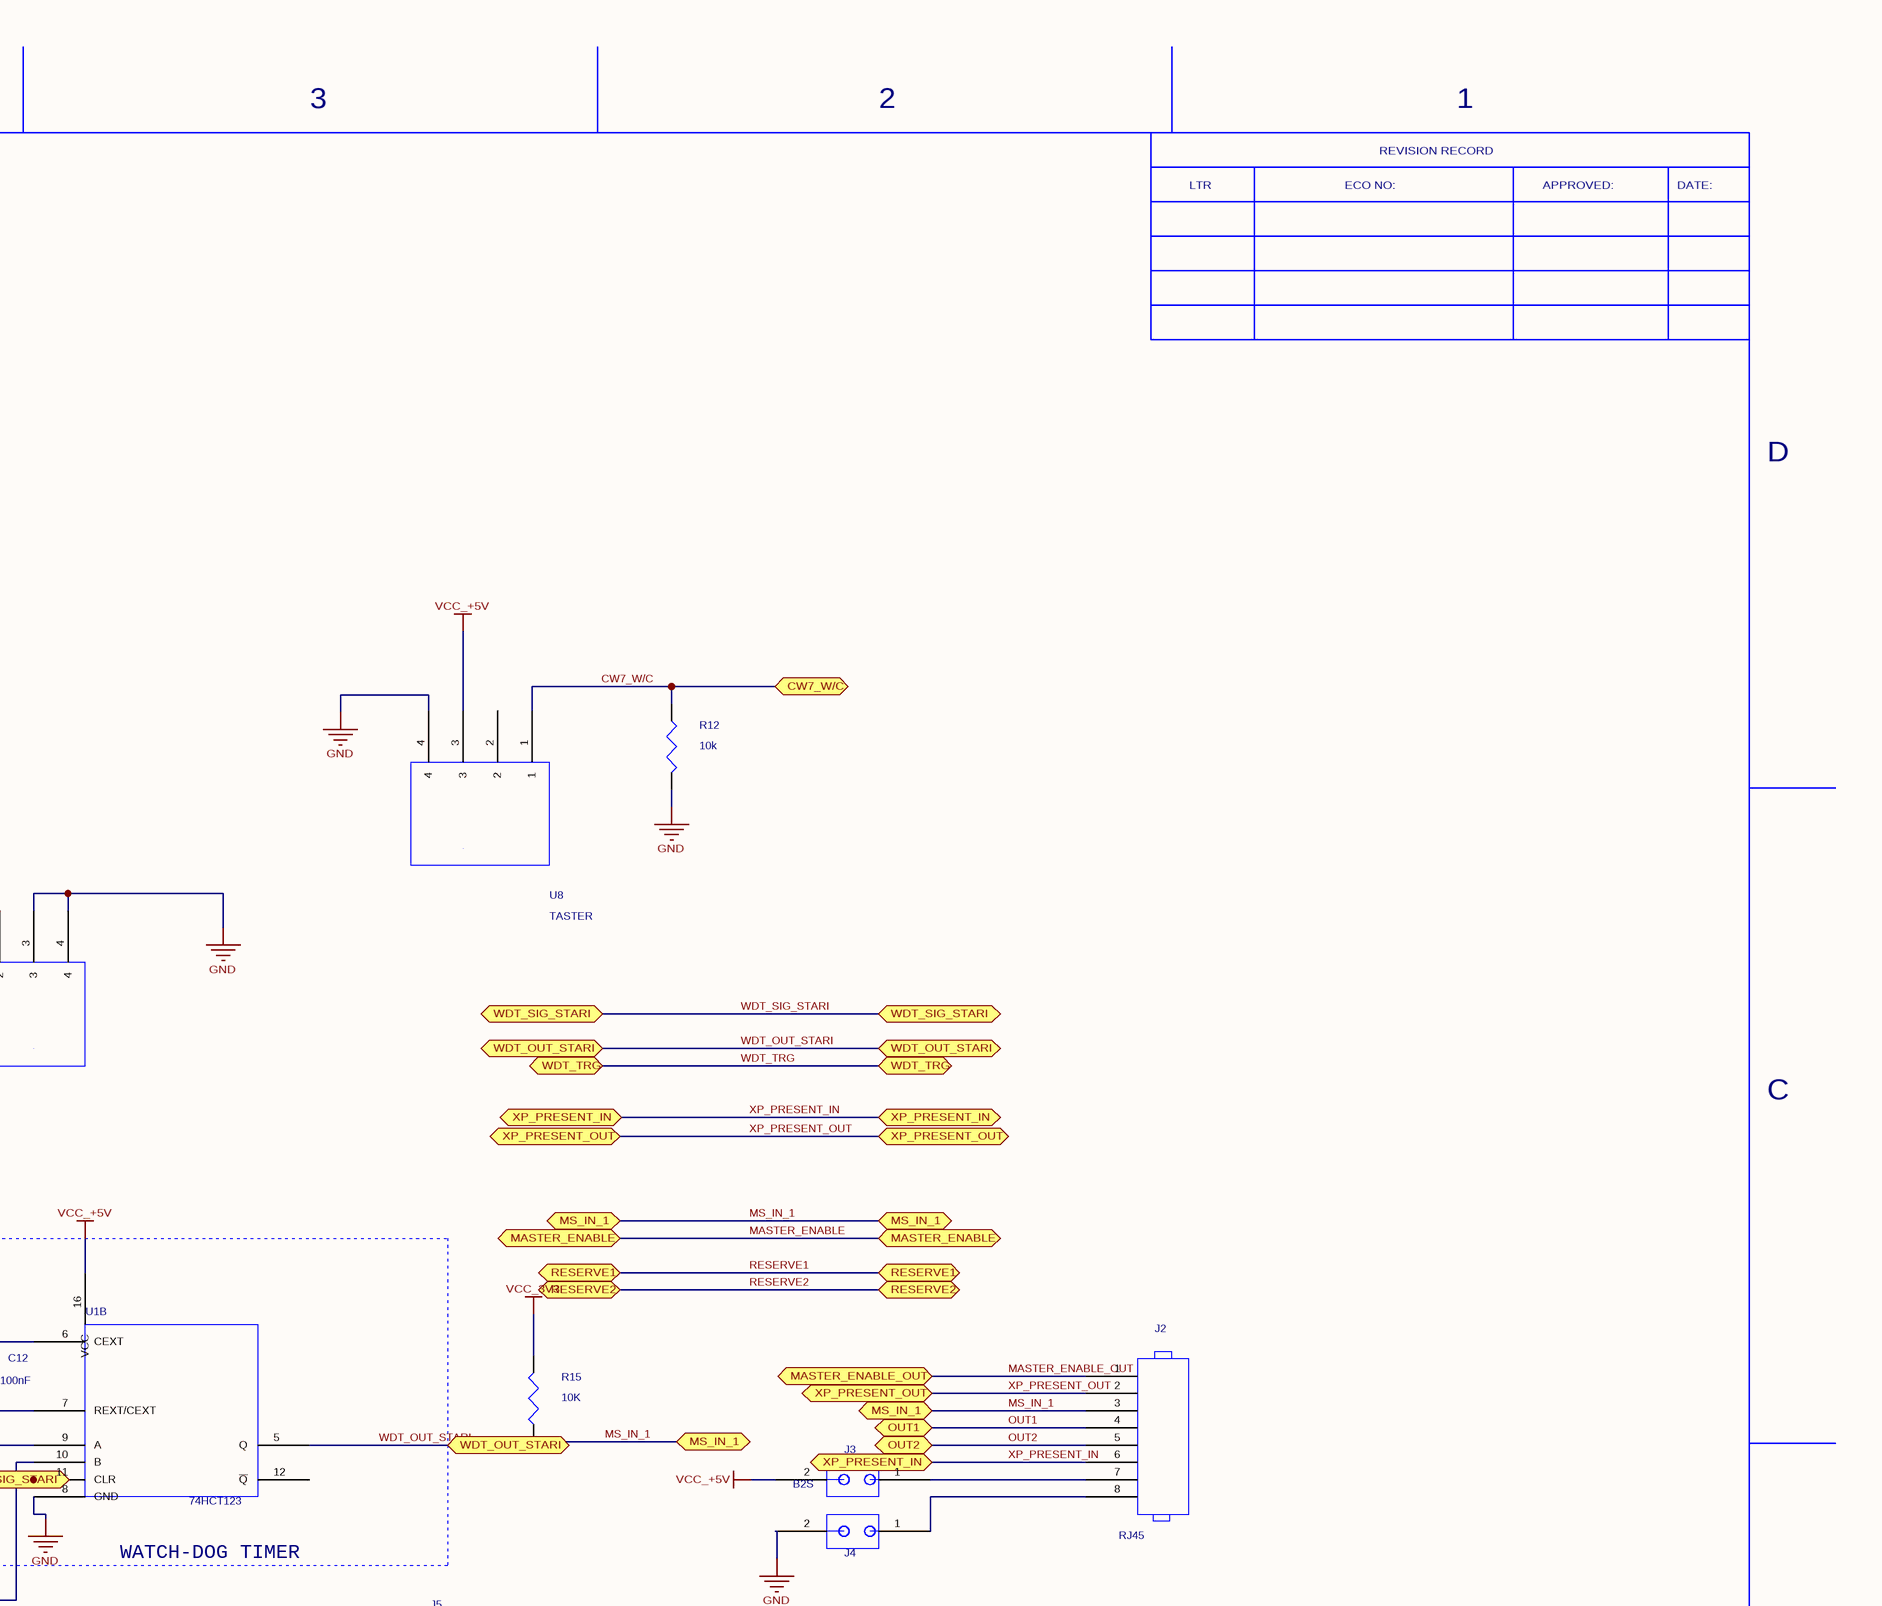
[diagram p13: WDT_TASTERI_M_S.SchDoc, top right]
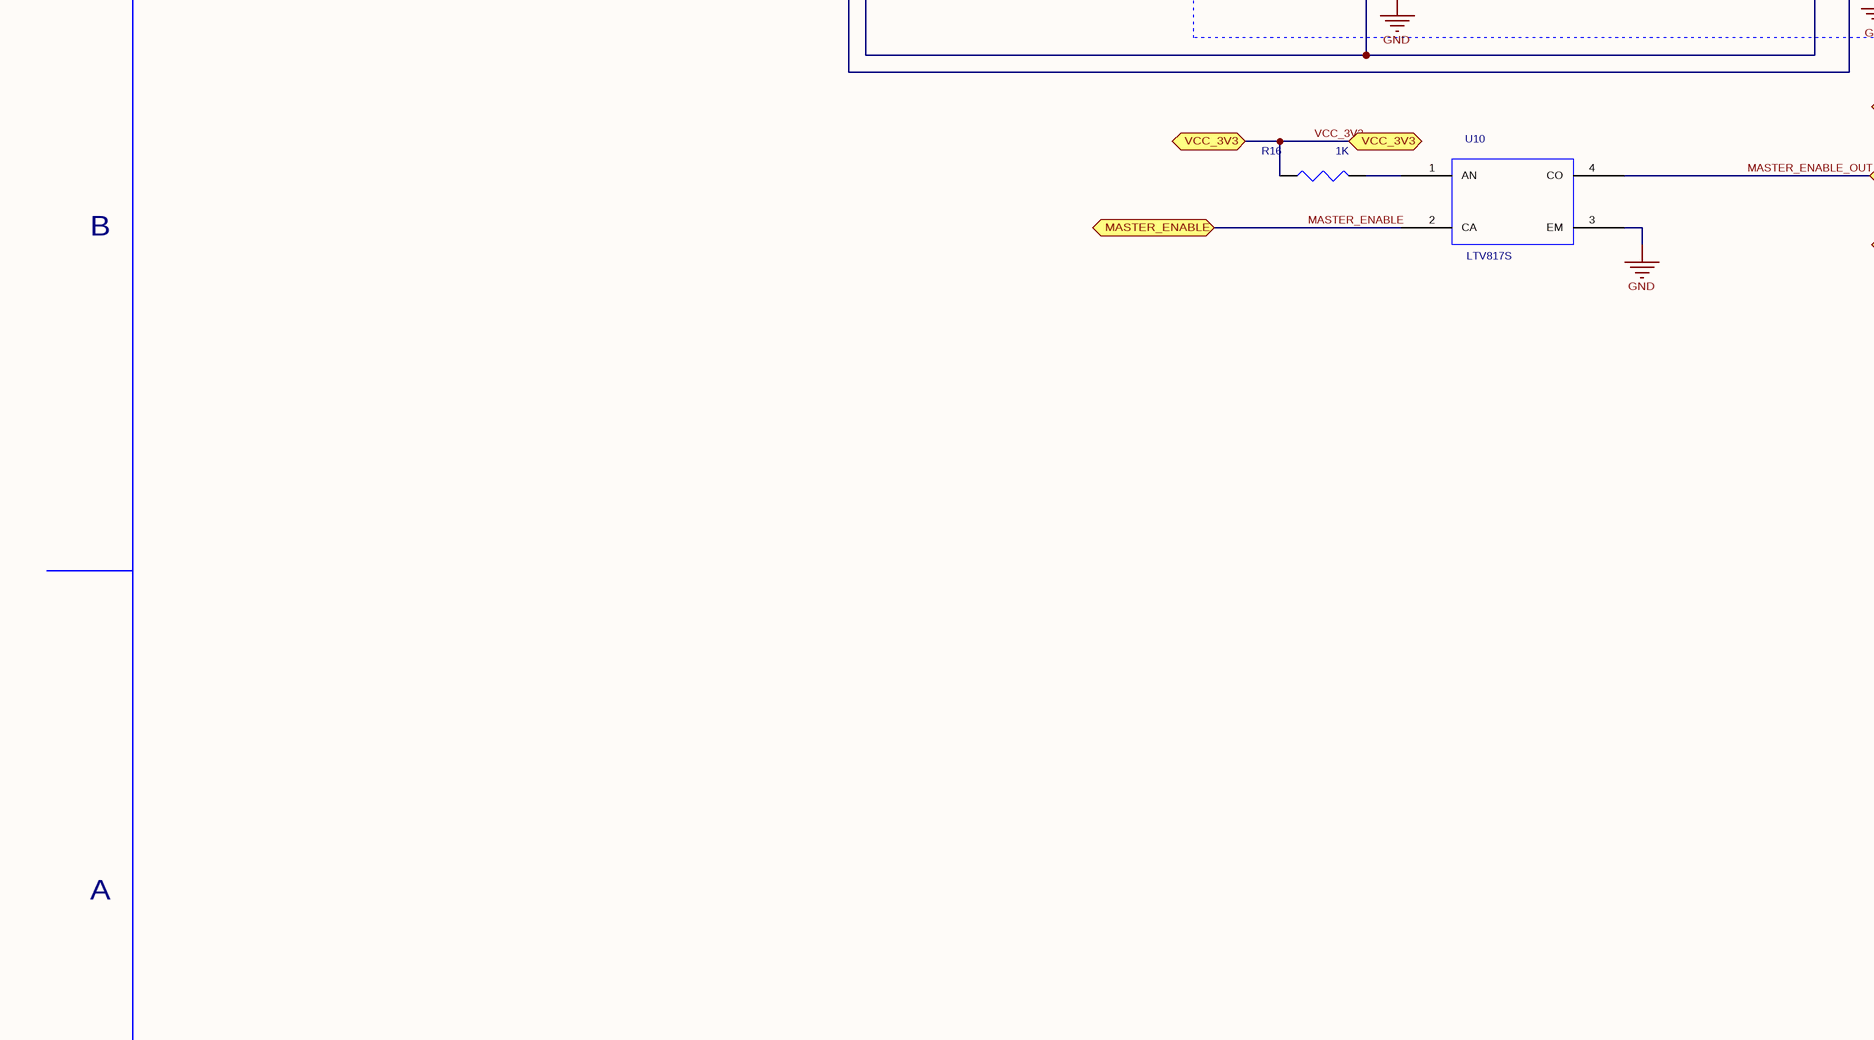
[diagram p14: WDT_TASTERI_M_S.SchDoc, bottom left]
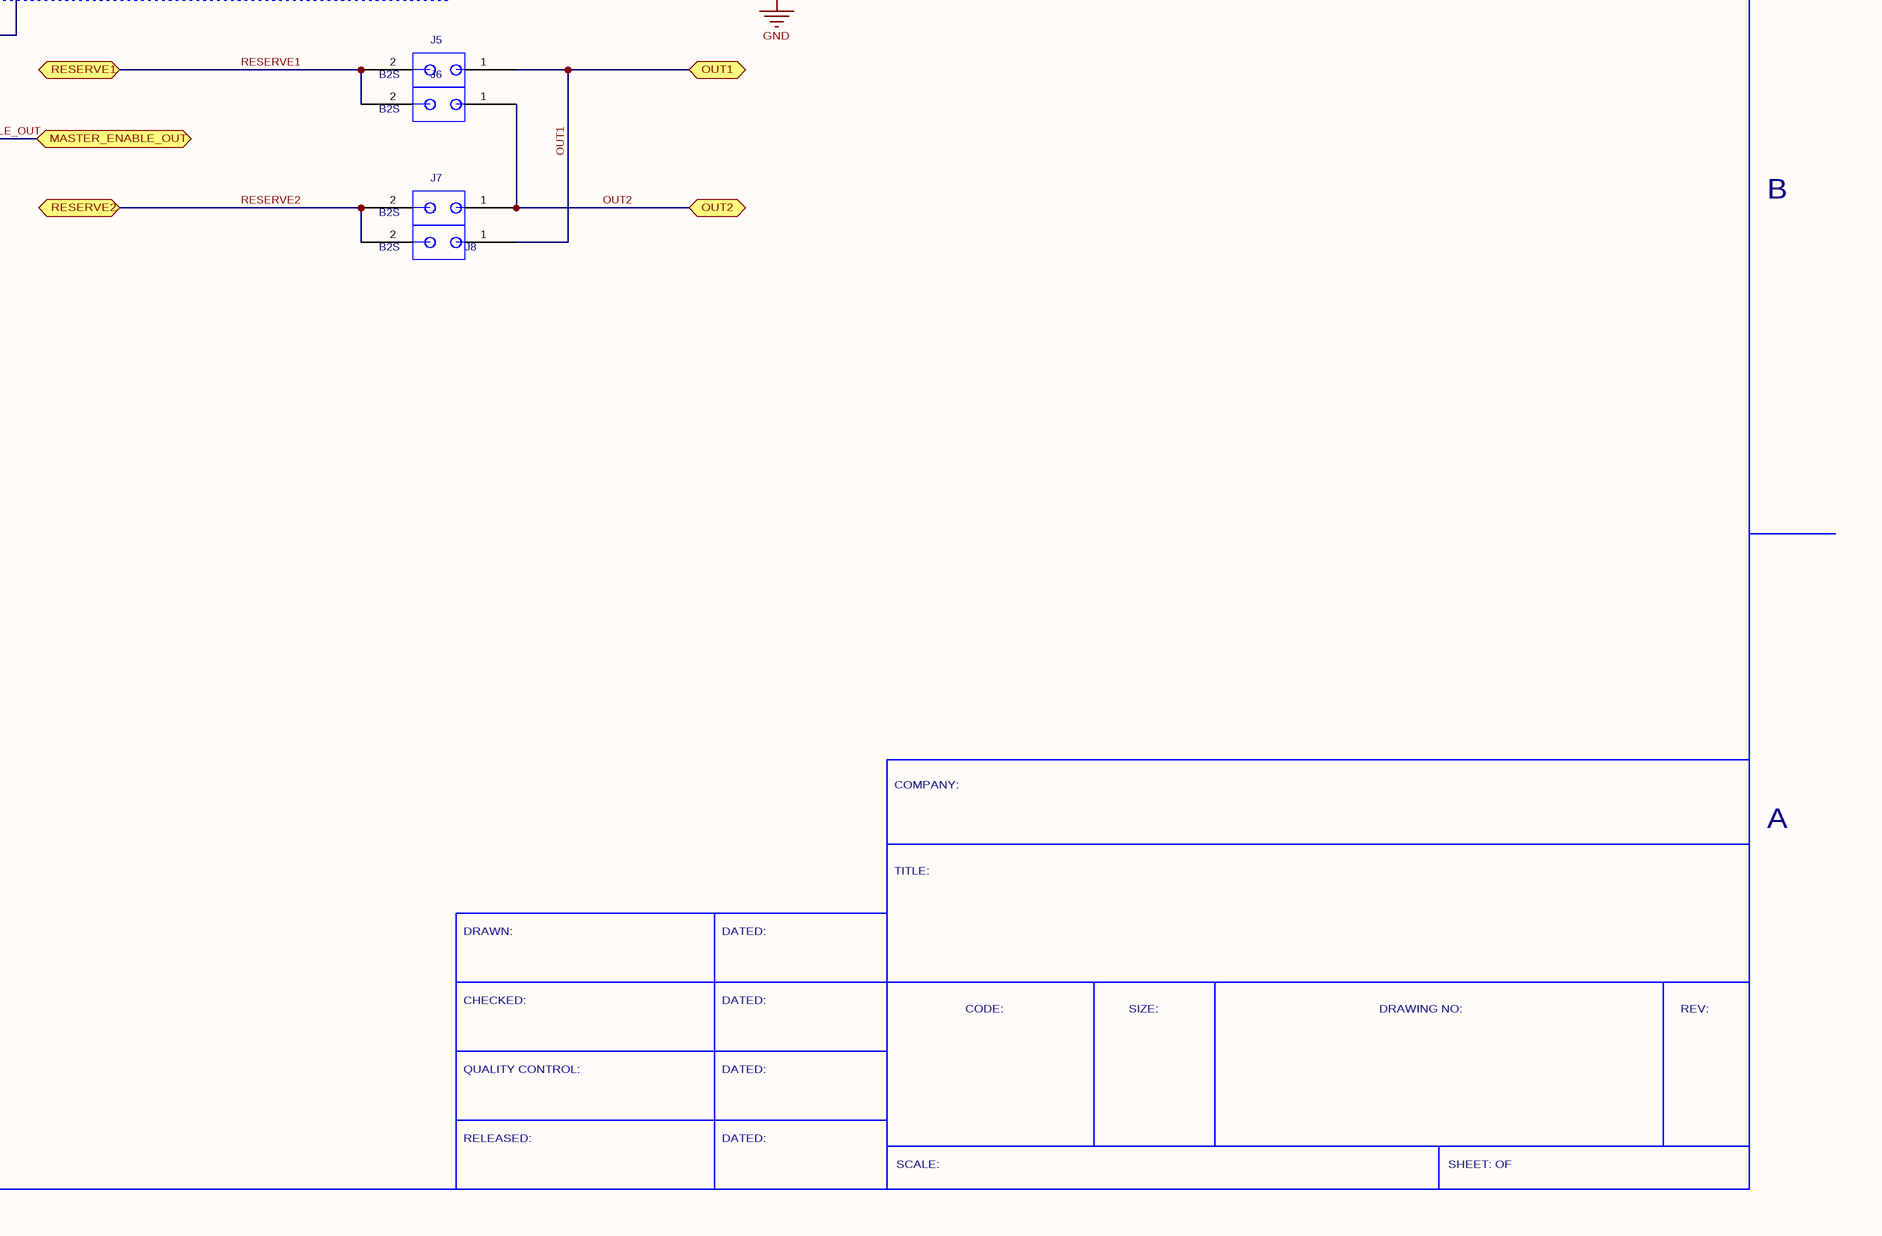
[diagram p15: WDT_TASTERI_M_S.SchDoc, bottom right]

### Parts
C10  value 1u  [SM/C_0805]  (hidden comment: C_2)
C11  value 1u  [SM/C_0805]  (hidden comment: C_2)
C12  value 100nF  [SM/C_0805]  (hidden comment: C_2)
J2  value RJ45  [TELE/TM.420FACE/8X8]  (hidden comment: 8_HEADER)
J3  value B2S  [JUMPER_100]  (hidden comment: B2S_0)
J4  B2S_0  [JUMPER_100]  (value not drawn)
J5  value B2S  [JUMPER_100]  (hidden comment: B2S_0)
J6  value B2S  [JUMPER_100]  (hidden comment: B2S_0)
J7  value B2S  [JUMPER_100]  (hidden comment: B2S_0)
J8  value B2S  [JUMPER_100]  (hidden comment: B2S_0)
JP4  value HEADER 2  [JUMPER_100]  (hidden comment: HEADER_2)
JP5  value HEADER 2  [JUMPER_100]  (hidden comment: HEADER_2)
R12  value 10k  [SM/R_1206]  (hidden comment: RESISTOR_2)
R13  value 470K  [SM/R_1206]  (hidden comment: RESISTOR_2)
R14  value 470K  [SM/R_1206]  (hidden comment: RESISTOR_2)
R15  value 10K  [SM/R_1206]  (hidden comment: RESISTOR_2)
R16  value 1K  [SM/R_1206]  (hidden comment: RESISTOR_2)
RN9  value 4x10K  [SMD_RX4]  (hidden comment: RESAR_IS_4/SM)
U1  value 74HCT123  [SOG.050/16/WG.244/L.375]  (hidden comment: 74HCT123_1)  (parts A,B of 2)
U8  value TASTER  [TP33WW080-SPST_PADS]  (hidden comment: SWITCH_BOJKE)
U9  value TASTER  [TP33WW080-SPST_PADS]  (hidden comment: SWITCH_BOJKE)
U10  value LTV817S  [LTV814S]  (hidden comment: LTV-817)

### Blocks framed on the sheet
WATCH-DOG TIMER: C11 C12 R13 R14 U1

### Ports
CW6 (bidir), CW7_W/C (bidir), MASTER_ENABLE (bidir), MASTER_ENABLE_OUT (bidir), MS_IN_1 (bidir), OUT1 (bidir), OUT2 (bidir), RESERVE1 (bidir), RESERVE2 (bidir), RESET_CPU, VCC_3V3 (bidir), WDT_OUT_STARI (bidir), WDT_SIG_STARI (bidir), WDT_TRG (bidir), XP_PRESENT_IN (bidir), XP_PRESENT_OUT (bidir)

### Nets
GND: C10.2 J4.2 JP4.2 JP5.2 R12.2 U1.8(GND) U8.4 U9.3 U9.4 U10.3(EM)
VCC_3V3: R15.2 R16.1 ; port VCC_3V3
VCC_+5V: J3.2 R13.1 R14.1 RN9.1 RN9.2 RN9.3 RN9.4 U1.16(VCC) U8.3
CW6: JP4.1 RN9.5 ; port CW6
CW7_W/C: R12.1 U8.1 ; port CW7_W/C
MASTER_ENABLE: U10.2(CA) ; port MASTER_ENABLE
MASTER_ENABLE_OUT: J2.1 U10.4(CO) ; port MASTER_ENABLE_OUT
MS_IN_1: J2.3 R15.1 ; port MS_IN_1
OUT1: J2.4 J5.1 J8.1 ; port OUT1
OUT2: J2.5 J6.1 J7.1 ; port OUT2
RESERVE1: J5.2 J6.2 ; port RESERVE1
RESERVE2: J7.2 J8.2 ; port RESERVE2
RESET_CPU: JP5.1 RN9.8 U9.1 ; port RESET_CPU
WDT_OUT_STARI: U1.5(Q) ; port WDT_OUT_STARI
WDT_SIG_STARI: U1.4(~{Q}) ; port WDT_SIG_STARI
WDT_TRG: U1.1(A) ; port WDT_TRG
XP_PRESENT_IN: J2.6 ; port XP_PRESENT_IN
XP_PRESENT_OUT: J2.2 ; port XP_PRESENT_OUT
NetC10_1: C10.1 RN9.6 U1.2(B) U1.3(CLR) U1.11(CLR)
NetC11_1: C11.1 U1.14(CEXT)
NetC11_2: C11.2 R13.2 U1.15(REXT/CEXT)
NetC12_1: C12.1 U1.6(CEXT)
NetC12_2: C12.2 R14.2 U1.7(REXT/CEXT)
NetJ2_7: J2.7 J3.1
NetJ2_8: J2.8 J4.1
NetR16_2: R16.2 U10.1(AN)
NetRN9_7: RN9.7 U1.10(B)
NetU1_9: U1.9(A) U1.13(Q)

Not connected (* = marked no-connect by the designer): U1 12(~{Q}); U8 2; U9 2

### Notes on the sheet
- 6
- 5
- 4
- 3
- 2
- 1
- LTR
- ECO NO:
- REVISION RECORD
- APPROVED:
- DATE:
- D
- Adresa
- C
- PTA
- B
- COMPANY:
- A
- TITLE:
- DRAWN:
- DATED:
- CHECKED:
- CODE:
- SIZE:
- DRAWING NO:
- REV:
- QUALITY CONTROL:
- RELEASED:
- SCALE:
- SHEET: OF

### Library data of the parts
C10-C12 = C_2: Source_Path: D:\ORCADWIN\CAPTURE\PTA\PC2A_00.OLB; SDTSourceLibName: C:\WINDOWS\TEMP\PC2A_00.LIB; PCB DECAL: SM/C_0805
J2 = 8_HEADER: Source_Path: C:\CADENCE\PSD_15.1\TOOLS\CAPTURE\LIBRARY\CONNECTOR.OLB; PCB DECAL: TELE/TM.420FACE/8X8
J3 J5-J8 = B2S_0: as J15 on sheet POWER_SUPPLY; PCB DECAL: JUMPER_100
J4 = B2S_0: Source_Path: C:\CADENCE\PSD_15.1\TOOLS\ATLAS_ITA\ATLAS_ITA.DSN; Value: B2S; PCB DECAL: JUMPER_100
JP4 JP5 = HEADER_2: as JP6 on sheet MAX_BUS; PCB DECAL: JUMPER_100
R12-R16 = RESISTOR_2: as R1 on sheet MAX_BUS; PCB DECAL: SM/R_1206
RN9 = RESAR_IS_4/SM: as RN1 on sheet MAX_BUS; PCB DECAL: SMD_RX4
U1 = 74HCT123_1: Source_Path: E:\MILOS\PROJECTS\ATLAS_XP\ATLAS_XP.DSN; SDTSourceLibName: C:\WINDOWS\TEMP\PC2A_00.LIB; PCB DECAL: SOG.050/16/WG.244/L.375
U8 = SWITCH_BOJKE: CW_TASTER; Source_Path: C:\CADENCE\PSD_15.1\TOOLS\ATLAS_ITA\LIBRARY1.OLB; Serial No: TP33WW080; Geometry.Height: 8.65mm; PCB DECAL: TP33WW080-SPST_PADS
U9 = SWITCH_BOJKE: RST_TASTER; Source_Path: C:\CADENCE\PSD_15.1\TOOLS\ATLAS_ITA\LIBRARY1.OLB; Serial No: TP33WW080; Geometry.Height: 8.65mm; PCB DECAL: TP33WW080-SPST_PADS
U10 = LTV-817: Source_Path: C:\PROJECTS\ATLAS_XP\LIBRARY1.OLB; PCB DECAL: LTV814S

## Sheet ATLAS_XP2V5.Sheet 5.SchDoc: ATLAS_XP2V5
size 558 x 431 mm; Organization: IMP Automatika d.o.o.; Revision: V5
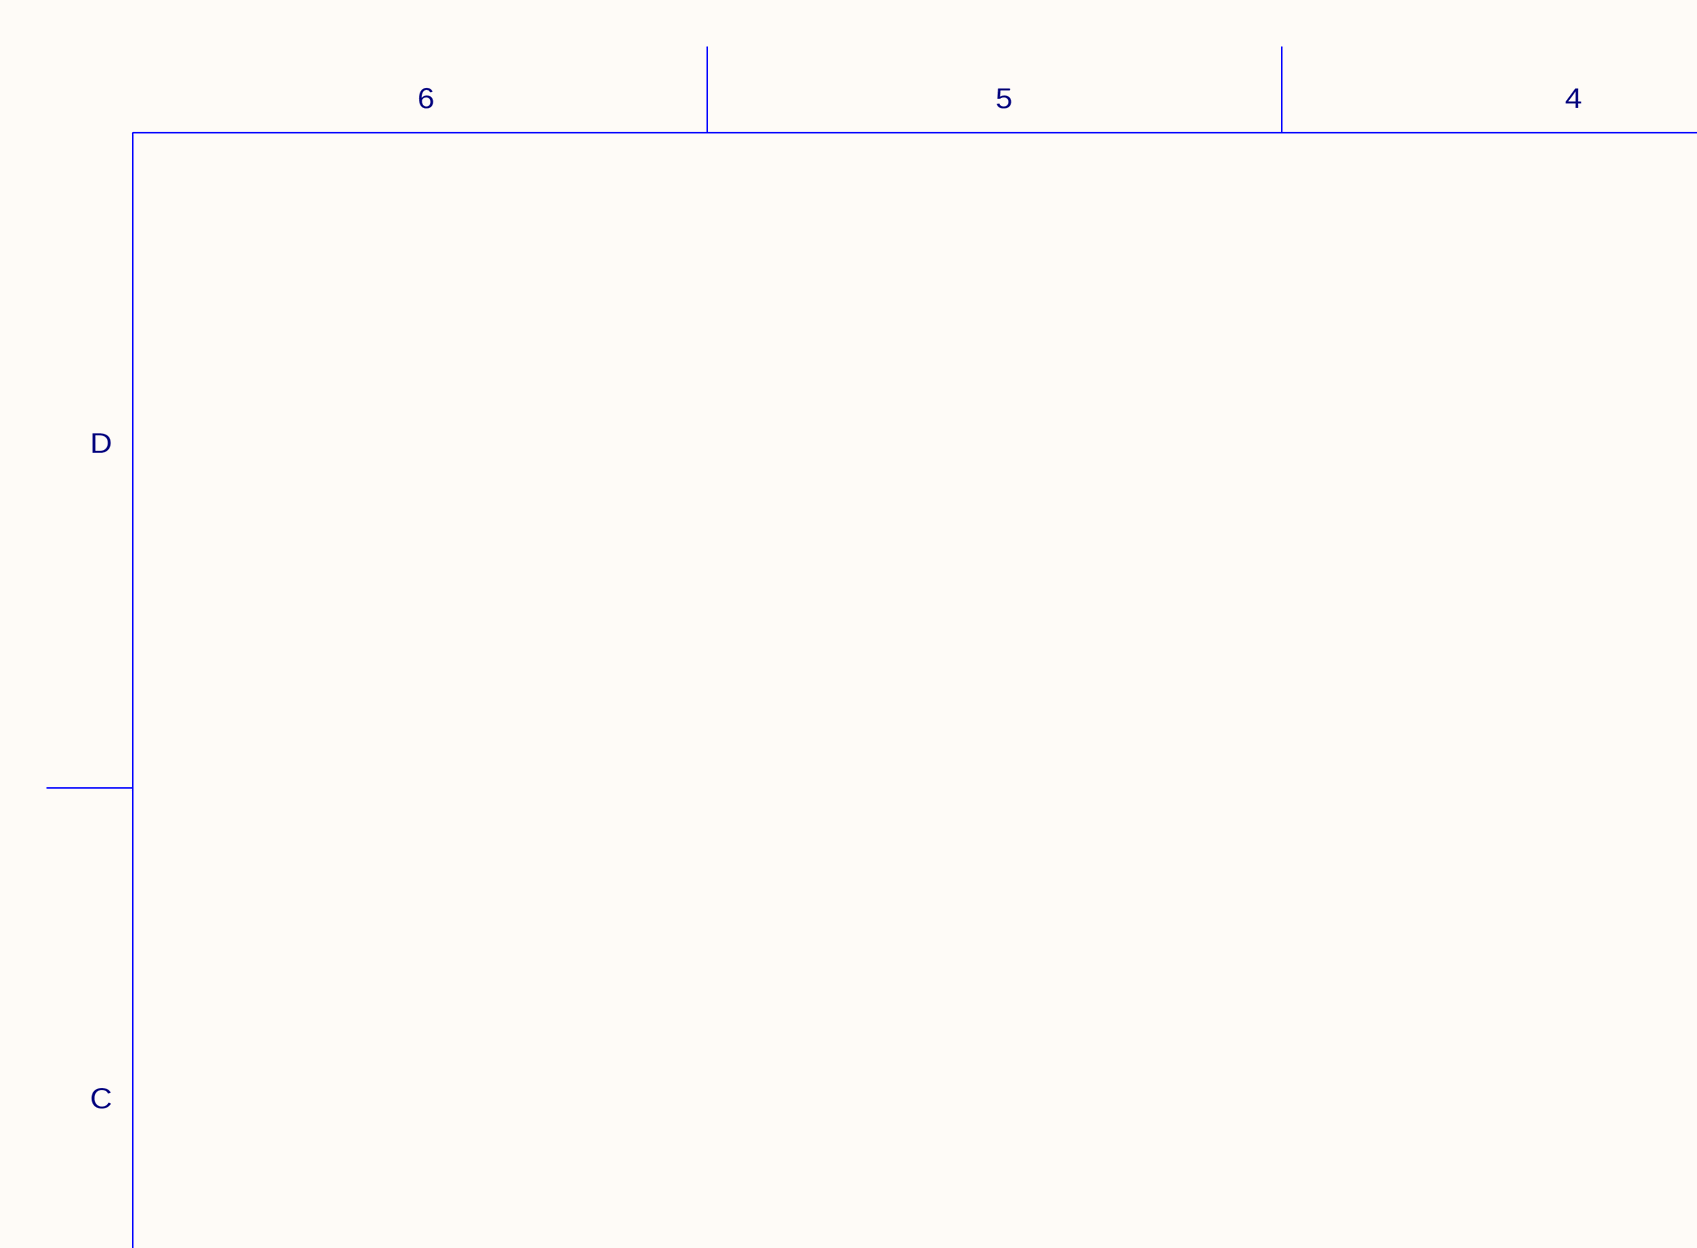
[diagram p16: ATLAS_XP2V5.Sheet 5.SchDoc, top left]
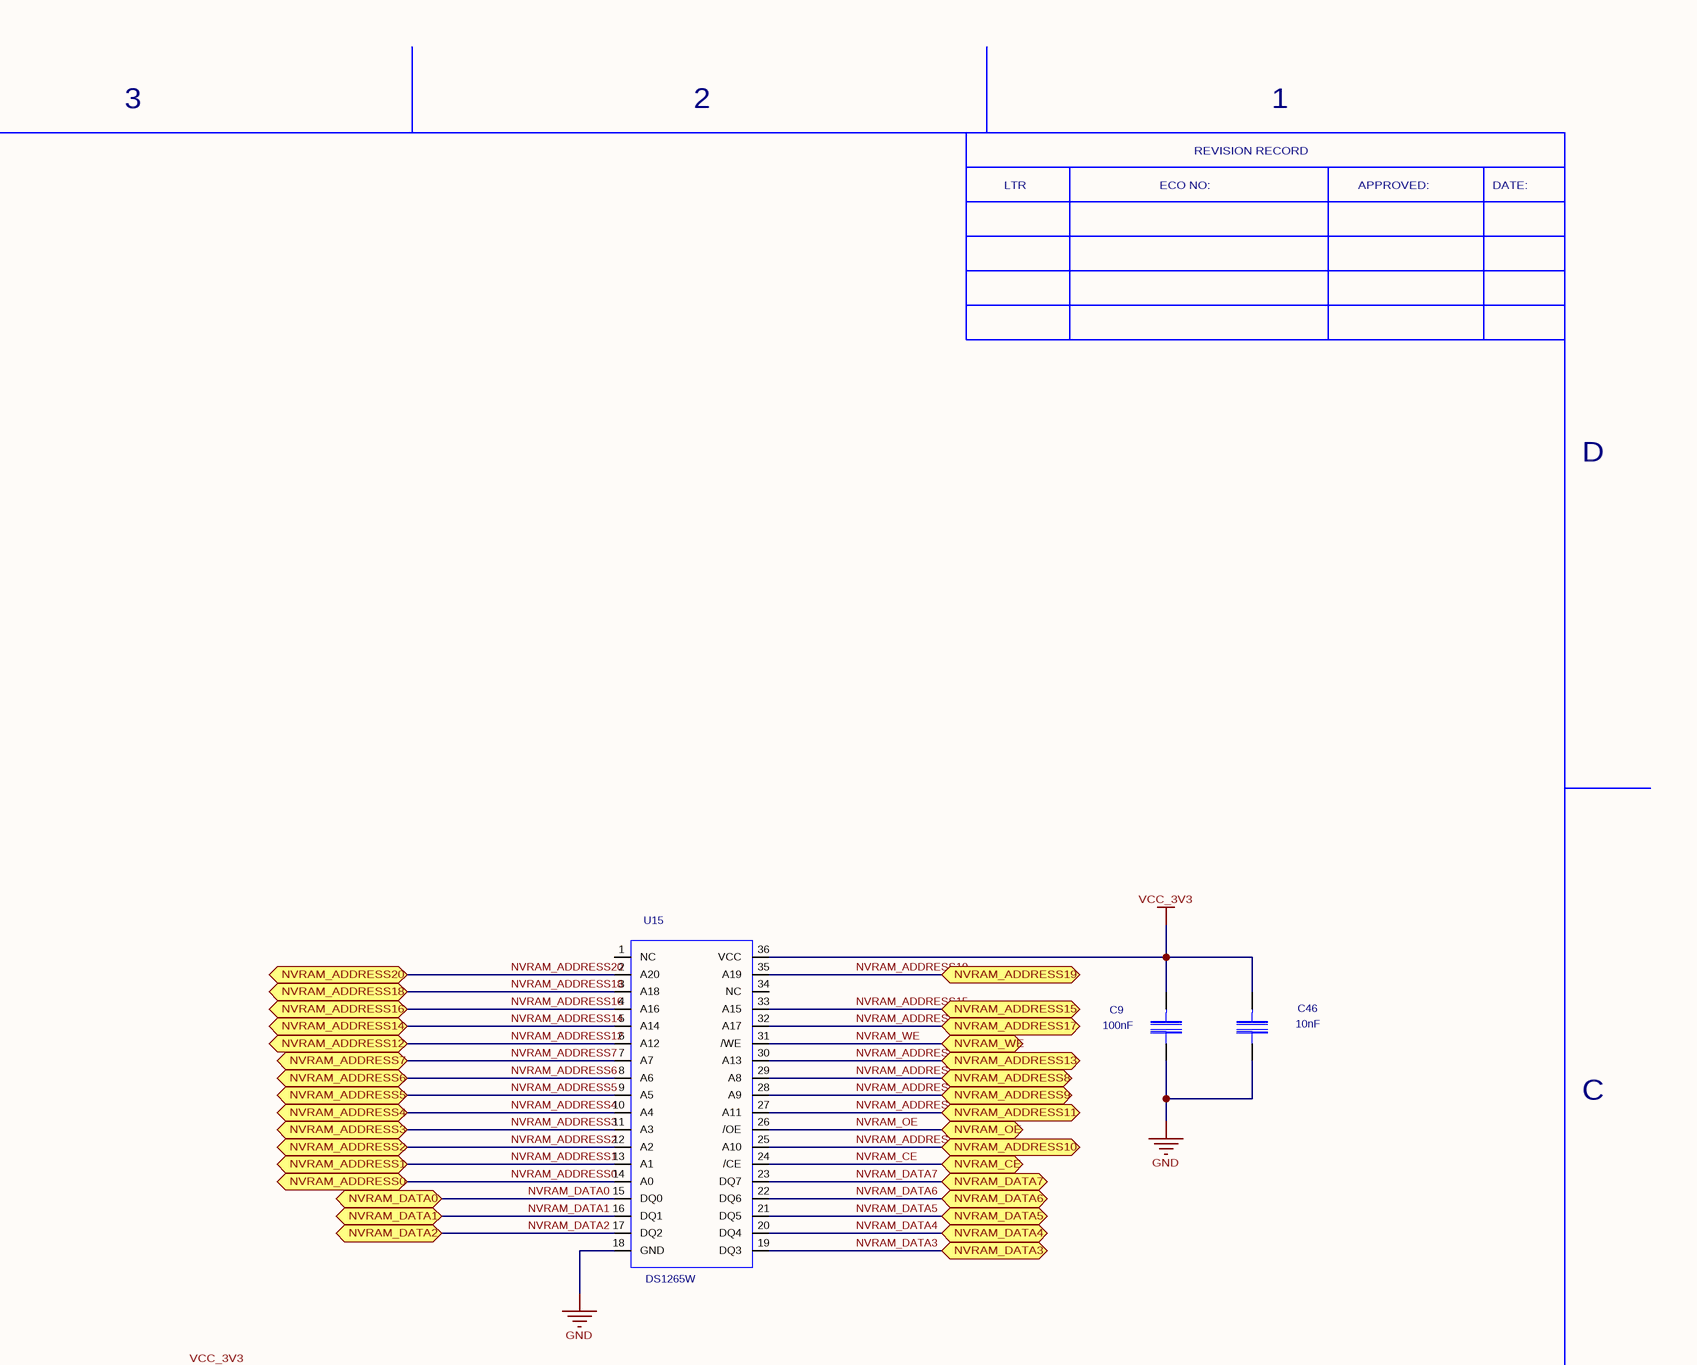
[diagram p17: ATLAS_XP2V5.Sheet 5.SchDoc, top right]
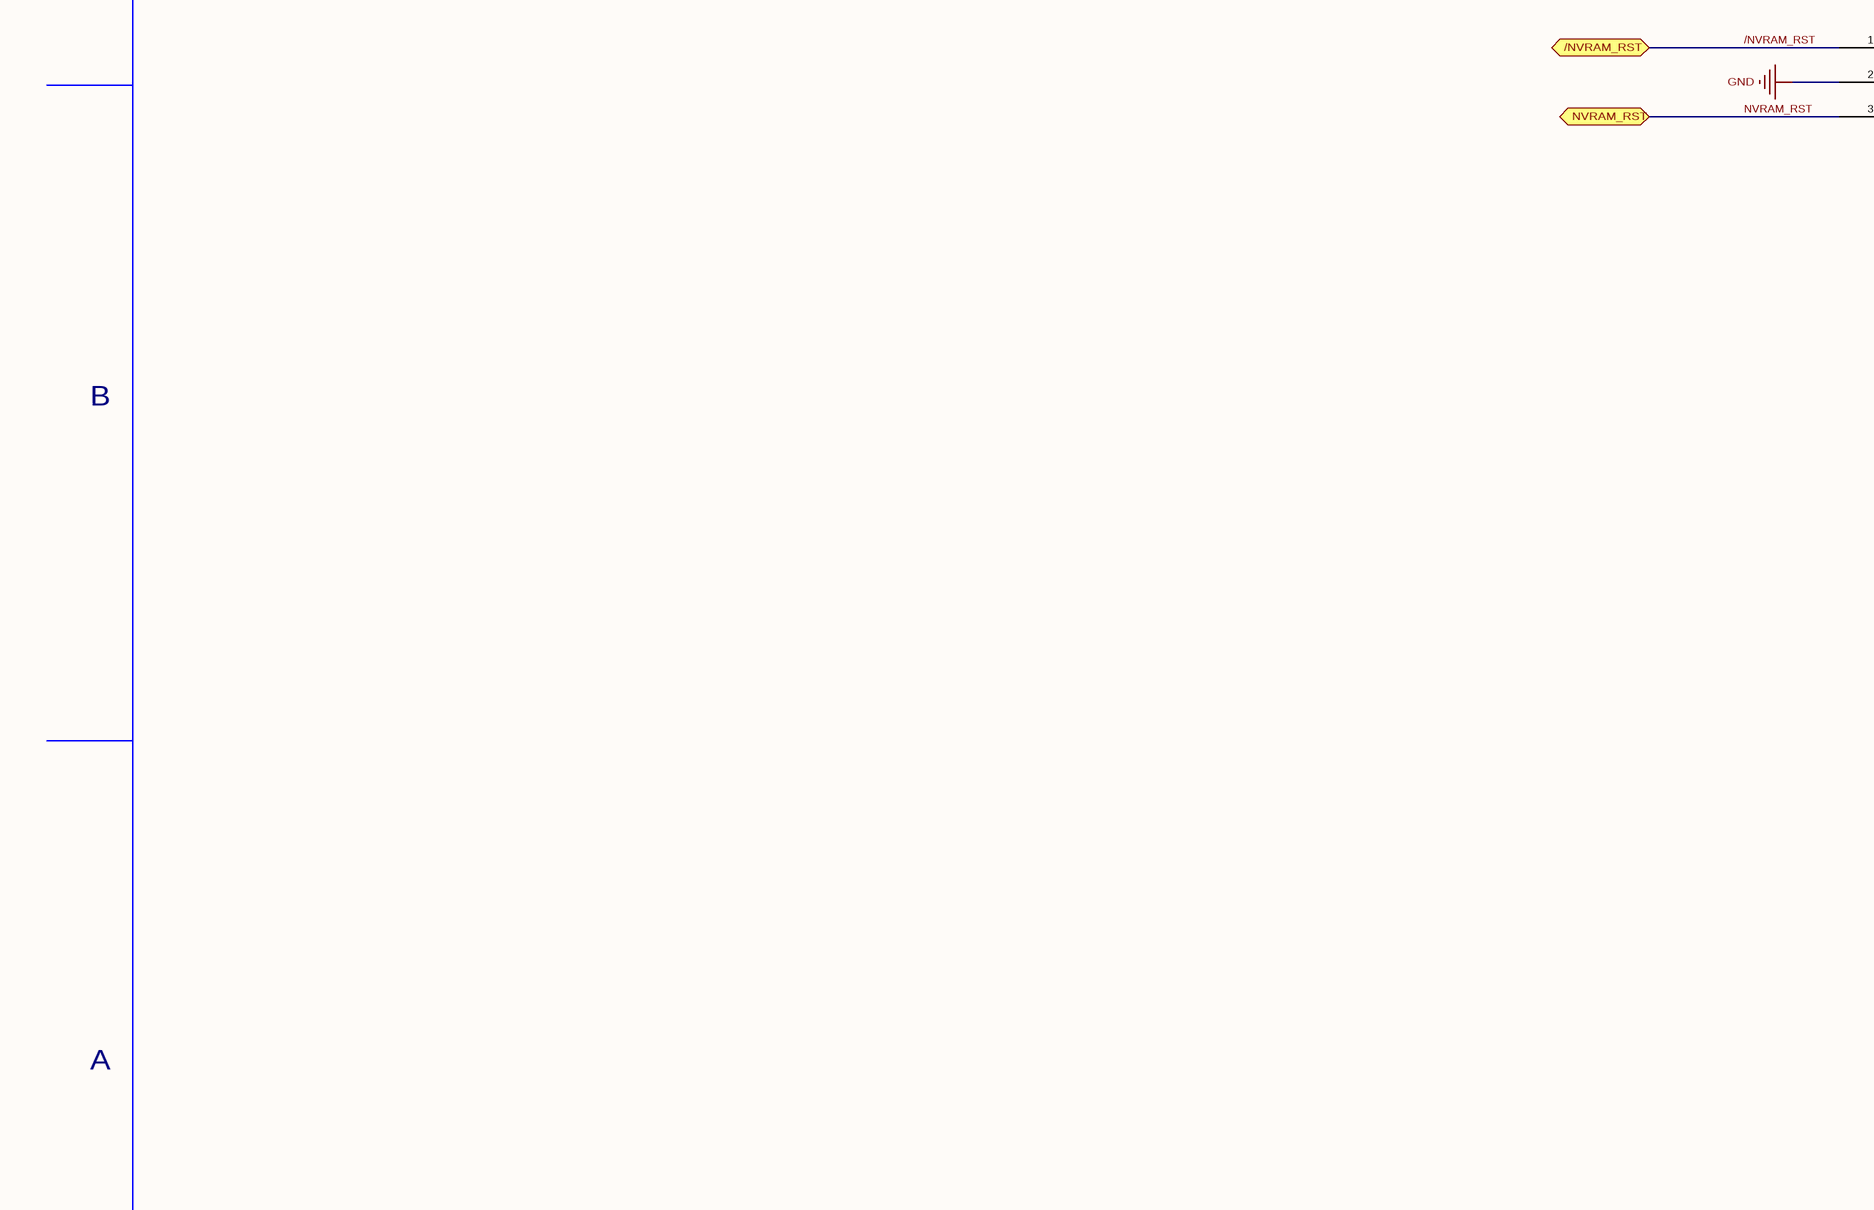
[diagram p18: ATLAS_XP2V5.Sheet 5.SchDoc, bottom left]
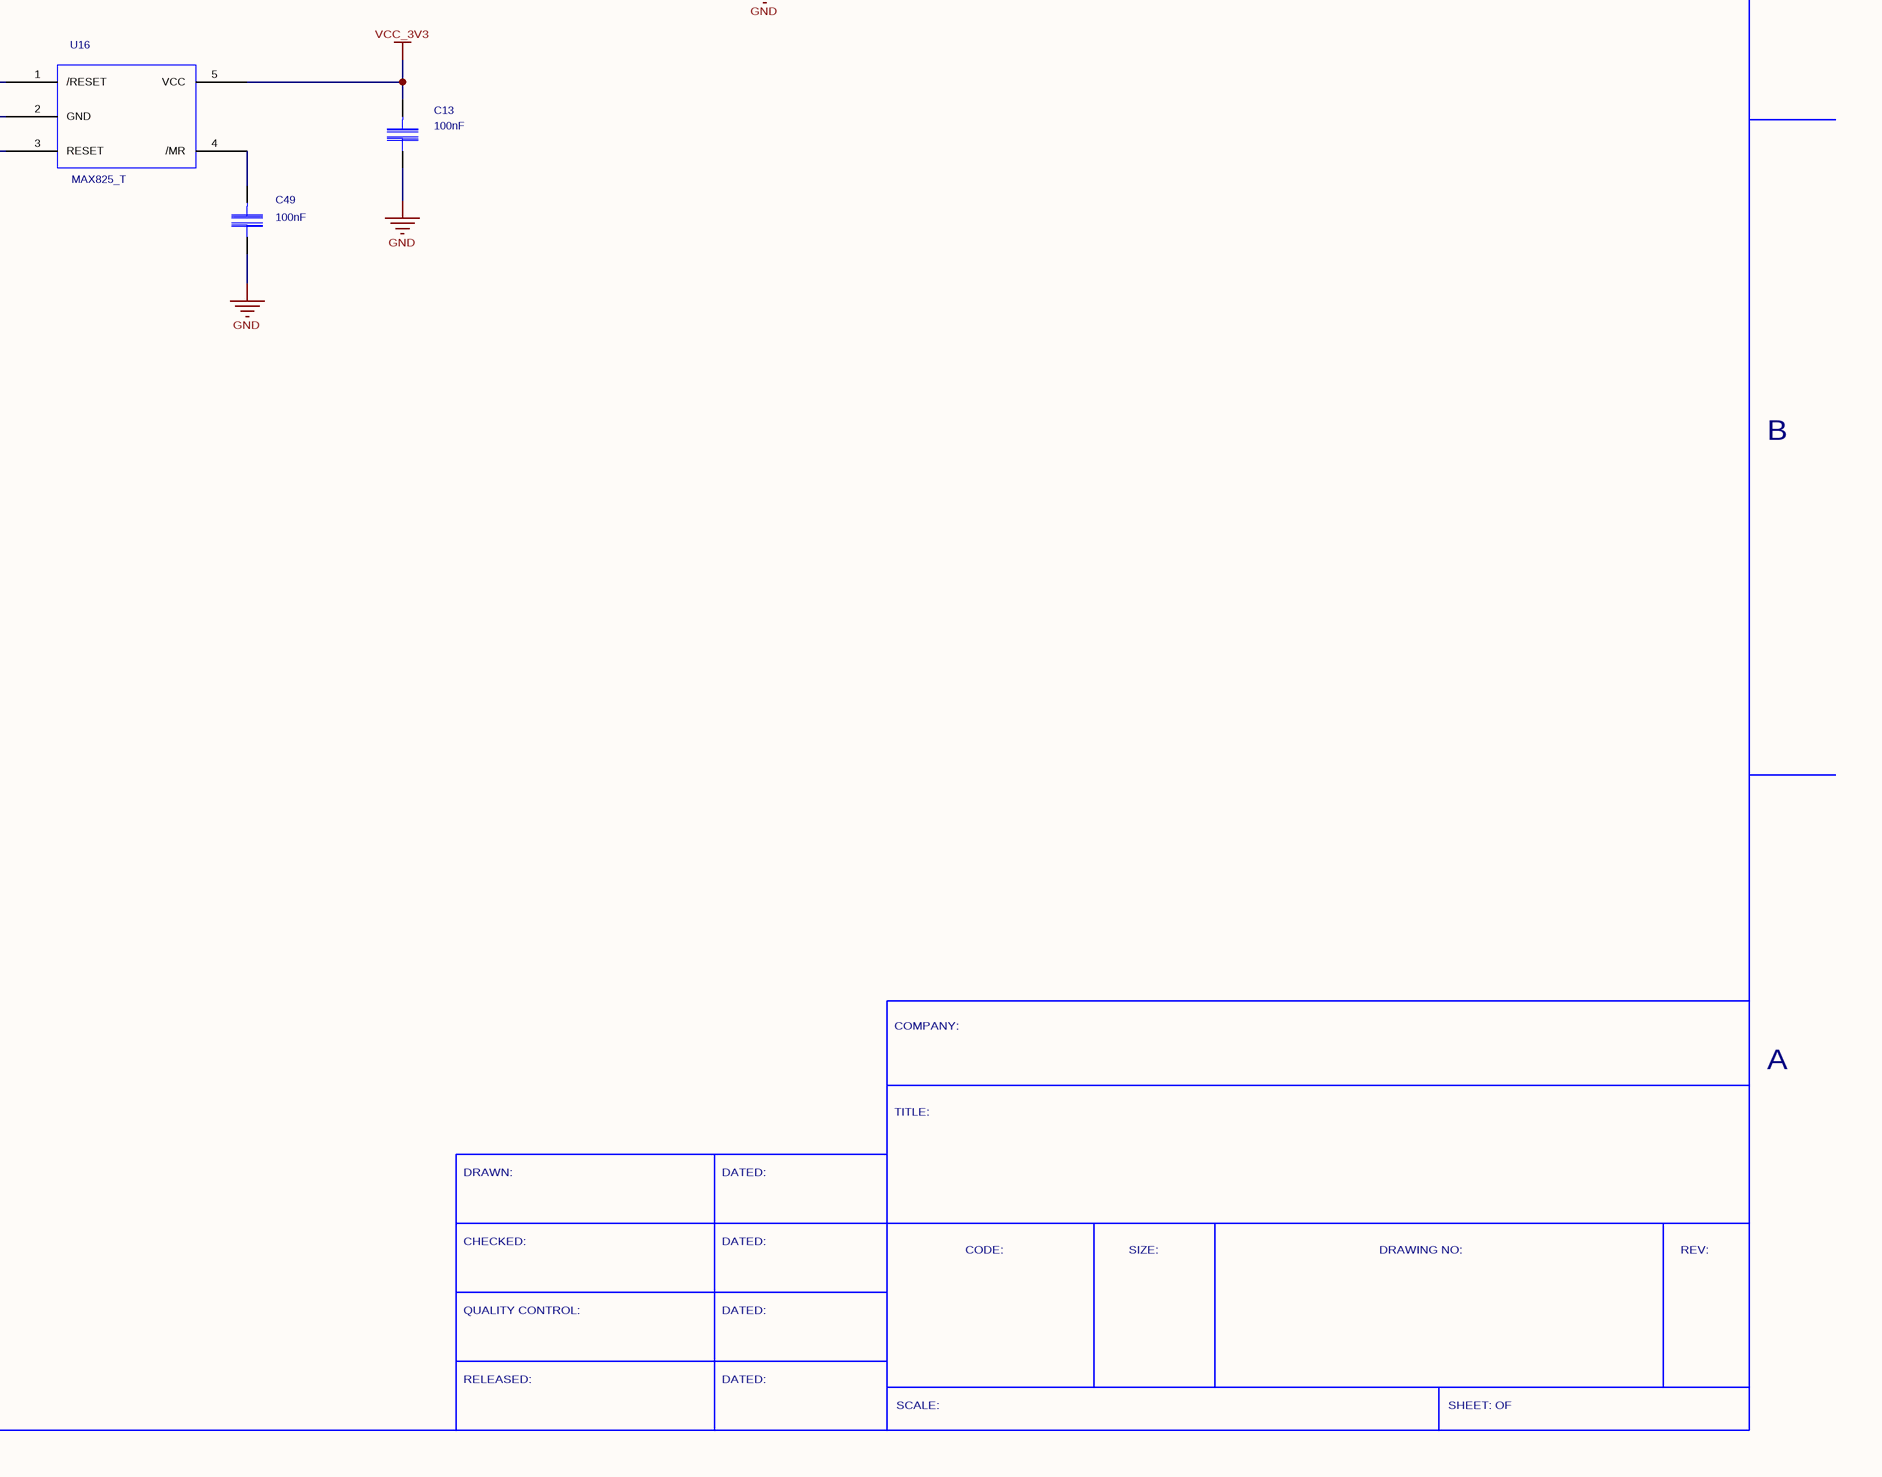
[diagram p19: ATLAS_XP2V5.Sheet 5.SchDoc, bottom right]

### Parts
C9  value 100nF  [SM/C_0805]  (hidden comment: C)
C13  value 100nF  [SM/C_0805]  (hidden comment: C)
C46  value 10nF  [SM/C_0805]  (hidden comment: C)
C49  value 100nF  [SM/C_0805]  (hidden comment: C)
U15  DS1265W  [DIP.100/36/W.600/L1.850]
U16  MAX825_T  [SOT23_5_MILOS_REV4]

### Ports
/NVRAM_RST (bidir), NVRAM_ADDRESS0 (bidir), NVRAM_ADDRESS1 (bidir), NVRAM_ADDRESS2 (bidir), NVRAM_ADDRESS3 (bidir), NVRAM_ADDRESS4 (bidir), NVRAM_ADDRESS5 (bidir), NVRAM_ADDRESS6 (bidir), NVRAM_ADDRESS7 (bidir), NVRAM_ADDRESS8 (bidir), NVRAM_ADDRESS9 (bidir), NVRAM_ADDRESS10 (bidir), NVRAM_ADDRESS11 (bidir), NVRAM_ADDRESS12 (bidir), NVRAM_ADDRESS13 (bidir), NVRAM_ADDRESS14 (bidir), NVRAM_ADDRESS15 (bidir), NVRAM_ADDRESS16 (bidir), NVRAM_ADDRESS17 (bidir), NVRAM_ADDRESS18 (bidir), NVRAM_ADDRESS19 (bidir), NVRAM_ADDRESS20 (bidir), NVRAM_CE (bidir), NVRAM_DATA0 (bidir), NVRAM_DATA1 (bidir), NVRAM_DATA2 (bidir), NVRAM_DATA3 (bidir), NVRAM_DATA4 (bidir), NVRAM_DATA5 (bidir), NVRAM_DATA6 (bidir), NVRAM_DATA7 (bidir), NVRAM_OE (bidir), NVRAM_RST (bidir), NVRAM_WE (bidir)

### Nets
GND: C9.2 C13.2 C46.2 C49.2 U15.18(GND) U16.2(GND)
VCC_3V3: C9.1 C13.1 C46.1 U15.36(VCC) U16.5(VCC)
/NVRAM_RST: U16.1(/RESET) ; port /NVRAM_RST
NVRAM_ADDRESS0: U15.14(A0) ; port NVRAM_ADDRESS0
NVRAM_ADDRESS1: U15.13(A1) ; port NVRAM_ADDRESS1
NVRAM_ADDRESS2: U15.12(A2) ; port NVRAM_ADDRESS2
NVRAM_ADDRESS3: U15.11(A3) ; port NVRAM_ADDRESS3
NVRAM_ADDRESS4: U15.10(A4) ; port NVRAM_ADDRESS4
NVRAM_ADDRESS5: U15.9(A5) ; port NVRAM_ADDRESS5
NVRAM_ADDRESS6: U15.8(A6) ; port NVRAM_ADDRESS6
NVRAM_ADDRESS7: U15.7(A7) ; port NVRAM_ADDRESS7
NVRAM_ADDRESS8: U15.29(A8) ; port NVRAM_ADDRESS8
NVRAM_ADDRESS9: U15.28(A9) ; port NVRAM_ADDRESS9
NVRAM_ADDRESS10: U15.25(A10) ; port NVRAM_ADDRESS10
NVRAM_ADDRESS11: U15.27(A11) ; port NVRAM_ADDRESS11
NVRAM_ADDRESS12: U15.6(A12) ; port NVRAM_ADDRESS12
NVRAM_ADDRESS13: U15.30(A13) ; port NVRAM_ADDRESS13
NVRAM_ADDRESS14: U15.5(A14) ; port NVRAM_ADDRESS14
NVRAM_ADDRESS15: U15.33(A15) ; port NVRAM_ADDRESS15
NVRAM_ADDRESS16: U15.4(A16) ; port NVRAM_ADDRESS16
NVRAM_ADDRESS17: U15.32(A17) ; port NVRAM_ADDRESS17
NVRAM_ADDRESS18: U15.3(A18) ; port NVRAM_ADDRESS18
NVRAM_ADDRESS19: U15.35(A19) ; port NVRAM_ADDRESS19
NVRAM_ADDRESS20: U15.2(A20) ; port NVRAM_ADDRESS20
NVRAM_CE: U15.24(/CE) ; port NVRAM_CE
NVRAM_DATA0: U15.15(DQ0) ; port NVRAM_DATA0
NVRAM_DATA1: U15.16(DQ1) ; port NVRAM_DATA1
NVRAM_DATA2: U15.17(DQ2) ; port NVRAM_DATA2
NVRAM_DATA3: U15.19(DQ3) ; port NVRAM_DATA3
NVRAM_DATA4: U15.20(DQ4) ; port NVRAM_DATA4
NVRAM_DATA5: U15.21(DQ5) ; port NVRAM_DATA5
NVRAM_DATA6: U15.22(DQ6) ; port NVRAM_DATA6
NVRAM_DATA7: U15.23(DQ7) ; port NVRAM_DATA7
NVRAM_OE: U15.26(/OE) ; port NVRAM_OE
NVRAM_RST: U16.3(RESET) ; port NVRAM_RST
NVRAM_WE: U15.31(/WE) ; port NVRAM_WE
NetC49_1: C49.1 U16.4(/MR)

Not connected (* = marked no-connect by the designer): U15 1(NC) 34(NC)

### Notes on the sheet
- 6
- 5
- 4
- 3
- 2
- 1
- LTR
- ECO NO:
- REVISION RECORD
- APPROVED:
- DATE:
- D
- C
- B
- COMPANY:
- A
- TITLE:
- DRAWN:
- DATED:
- CHECKED:
- CODE:
- SIZE:
- DRAWING NO:
- REV:
- QUALITY CONTROL:
- RELEASED:
- SCALE:
- SHEET: OF

### Library data of the parts
C9 C13 C46 C49 = C: as C1 on sheet MAX_BUS; PCB DECAL: SM/C_0805
U15 = DS1265W: Source_Path: E:\MILOS\PROJECTS\ATLAS_XP2V3\DALLAS.OLB; PCB DECAL: DIP.100/36/W.600/L1.850; Value: DS1265W
U16 = MAX825_T: Source_Path: E:\MILOS\PROJECTS\ATLAS_XP2V3\ATLASXP.OLB; PCB DECAL: SOT23_5_MILOS_REV4; Value: MAX825_T